# EAGLE design System (EAGLE 8.6.0)
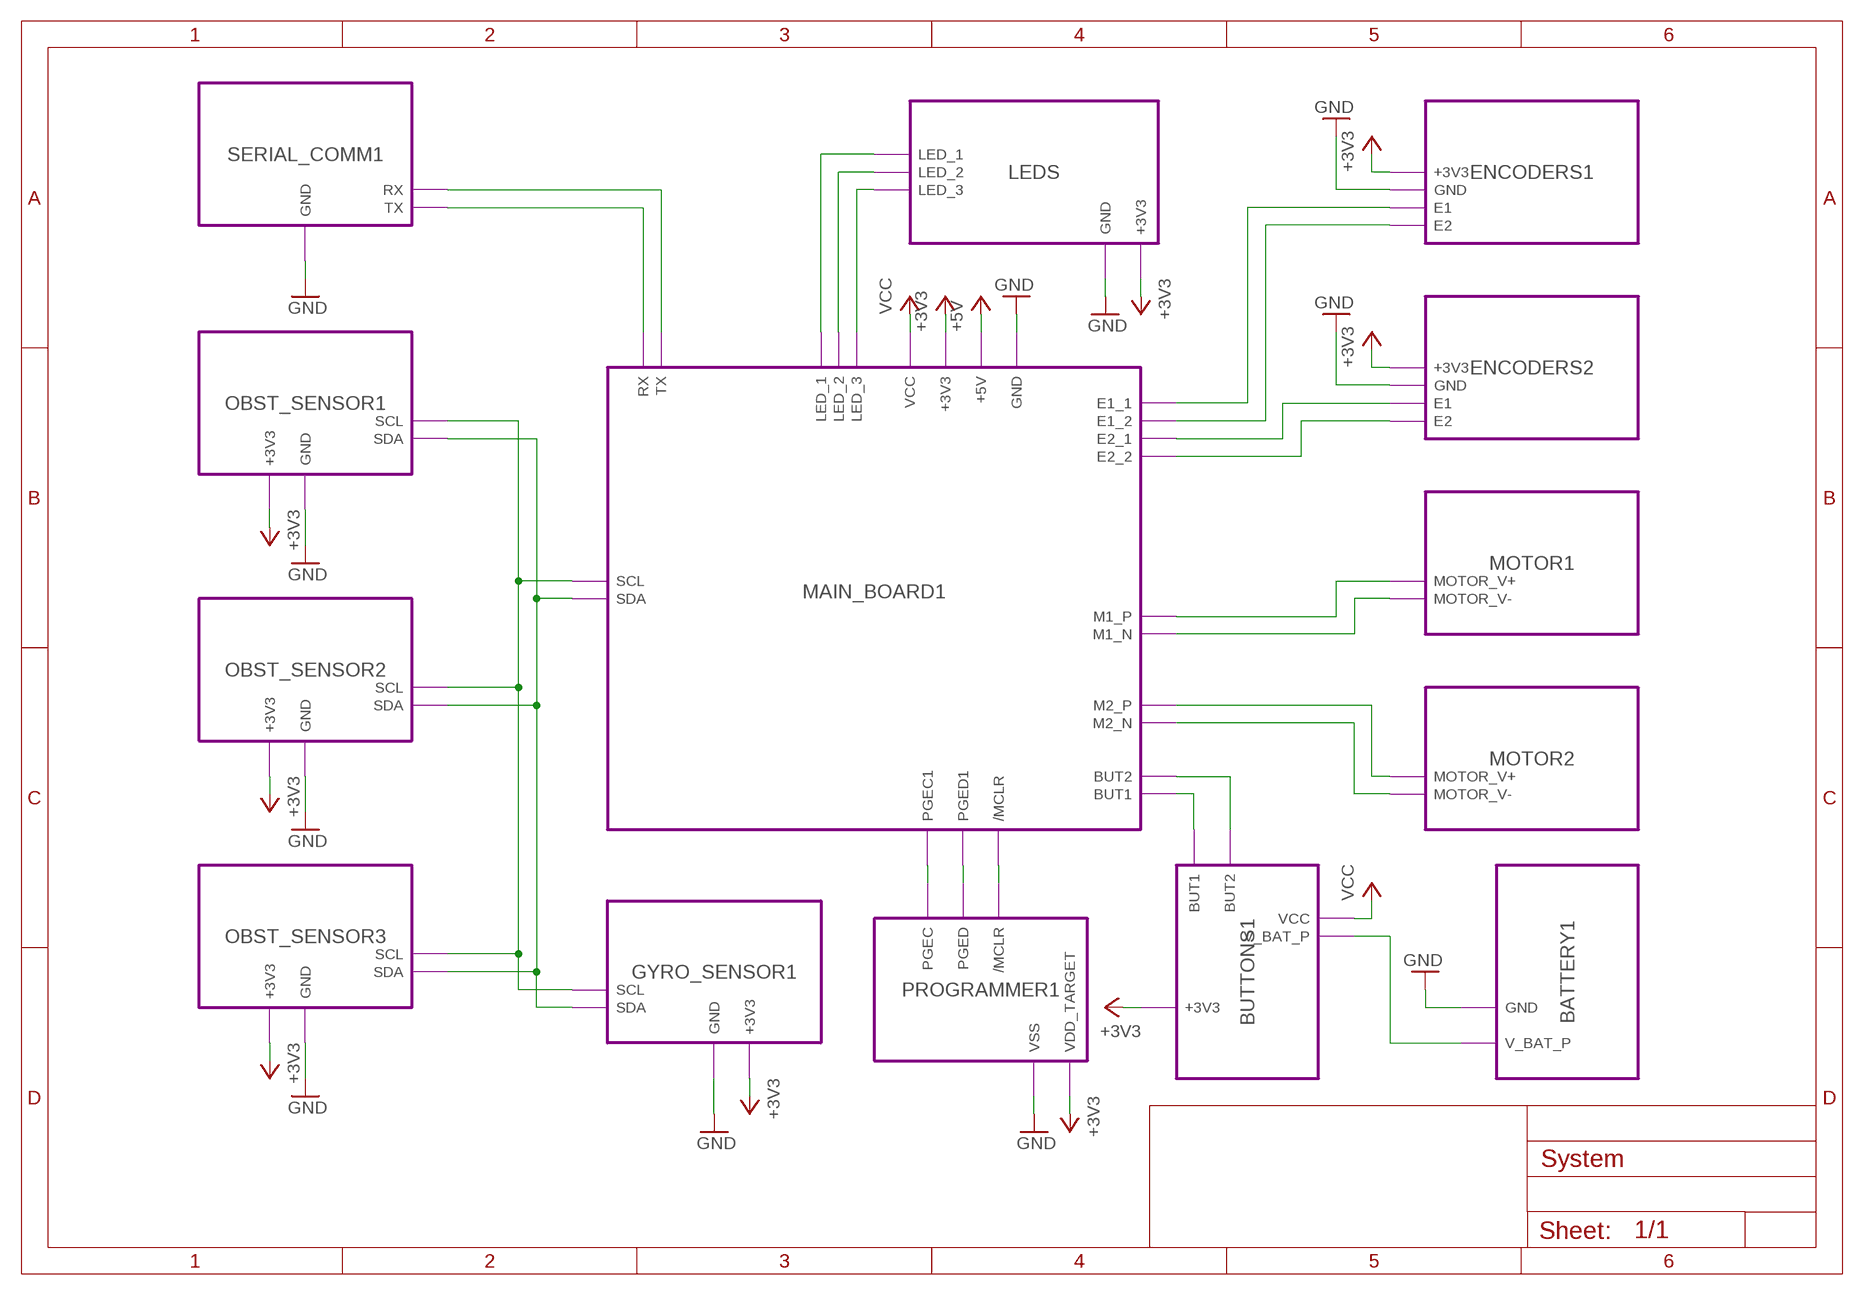
[diagram p0: schematic, sheet 1]

## Module instances
MAIN_BOARD1 = MAIN_BOARD
SERIAL_COMM1 = SERIAL_COMM
GYRO_SENSOR1 = GYRO_SENSOR
ENCODERS1 = ENCODERS
LEDS = LEDS
OBST_SENSOR1 = OBST_SENSOR
OBST_SENSOR2 = OBST_SENSOR
OBST_SENSOR3 = OBST_SENSOR
MOTOR1 = MOTOR
MOTOR2 = MOTOR
ENCODERS2 = ENCODERS
BATTERY1 = BATTERY
BUTTONS1 = BUTTONS
PROGRAMMER1 = PROGRAMMER

## Nets
+3V3: port GYRO_SENSOR1.+3V3 OBST_SENSOR1.+3V3 OBST_SENSOR3.+3V3 OBST_SENSOR2.+3V3 ENCODERS1.+3V3 ENCODERS2.+3V3 MAIN_BOARD1.+3V3 PROGRAMMER1.VDD_TARGET LEDS.+3V3 BUTTONS1.+3V3
+5V: port MAIN_BOARD1.+5V
GND: port GYRO_SENSOR1.GND SERIAL_COMM1.GND OBST_SENSOR1.GND OBST_SENSOR3.GND OBST_SENSOR2.GND ENCODERS1.GND ENCODERS2.GND BATTERY1.GND MAIN_BOARD1.GND LEDS.GND PROGRAMMER1.VSS
N$1: port GYRO_SENSOR1.SCL OBST_SENSOR3.SCL OBST_SENSOR2.SCL OBST_SENSOR1.SCL MAIN_BOARD1.SCL
N$2: port OBST_SENSOR1.SDA OBST_SENSOR2.SDA OBST_SENSOR3.SDA GYRO_SENSOR1.SDA MAIN_BOARD1.SDA
N$3: port SERIAL_COMM1.TX MAIN_BOARD1.RX
N$4: port SERIAL_COMM1.RX MAIN_BOARD1.TX
N$5: port BUTTONS1.V_BAT_P BATTERY1.V_BAT_P
N$6: port MAIN_BOARD1.M1_P MOTOR1.MOTOR_V+
N$7: port MOTOR1.MOTOR_V- MAIN_BOARD1.M1_N
N$8: port MAIN_BOARD1.M2_P MOTOR2.MOTOR_V+
N$9: port MAIN_BOARD1.M2_N MOTOR2.MOTOR_V-
N$10: port ENCODERS1.E1 MAIN_BOARD1.E1_1
N$11: port ENCODERS1.E2 MAIN_BOARD1.E1_2
N$12: port BUTTONS1.BUT1 MAIN_BOARD1.BUT1
N$13: port MAIN_BOARD1.BUT2 BUTTONS1.BUT2
N$14: port MAIN_BOARD1.PGEC1 PROGRAMMER1.PGEC
N$15: port MAIN_BOARD1.PGED1 PROGRAMMER1.PGED
N$17: port MAIN_BOARD1.E2_1 ENCODERS2.E1
N$18: port LEDS.LED_3 MAIN_BOARD1.LED_3
N$19: port LEDS.LED_2 MAIN_BOARD1.LED_2
N$20: port LEDS.LED_1 MAIN_BOARD1.LED_1
N$22: port MAIN_BOARD1.E2_2 ENCODERS2.E2
N$23: port MAIN_BOARD1./MCLR PROGRAMMER1./MCLR
VCC: port BUTTONS1.VCC MAIN_BOARD1.VCC

## Library data of the parts

## Module SERIAL_COMM
Ports: GND(pwr) RX(in) TX(out)
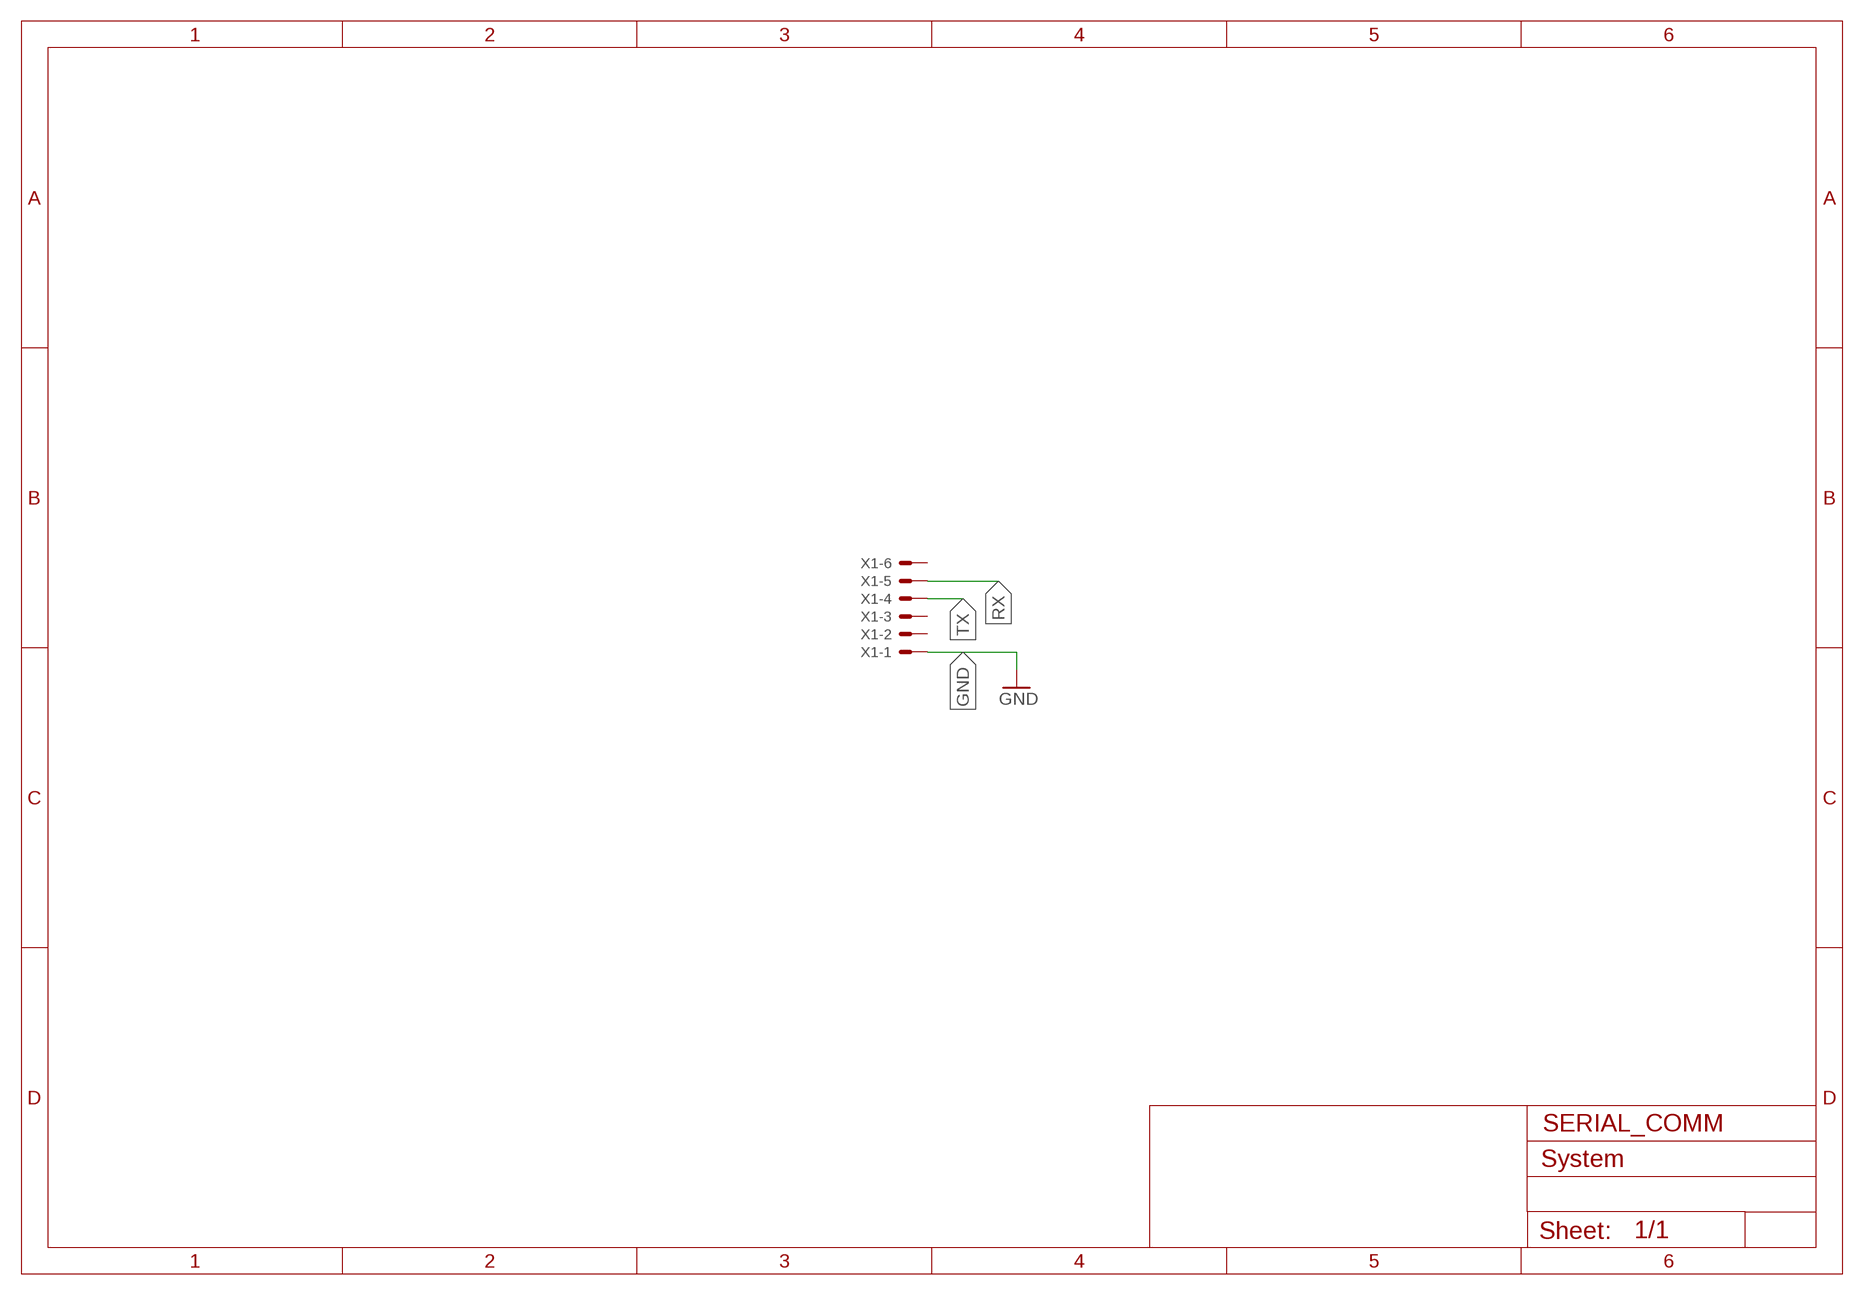
[diagram p1: schematic, module SERIAL_COMM, sheet 1]

### Parts
X1  22-23-2061  [22-23-2061]

### Nets
GND: X1.1
RX: X1.5
TX: X1.4
Unconnected: X1.2 X1.3 X1.6

### Notes on the sheet
- SERIAL_COMM

### Library data of the parts
X1 = con-molex:22-23-2061: .100" (2.54mm) Center Header - 6 Pin; MF: MOLEX; MPN: 22-23-2061; OC_FARNELL: 1462922; OC_NEWARK: 27C1933

## Module OBST_SENSOR
Ports: GND(pwr) +3V3(pwr) SDA(io) SCL(io)
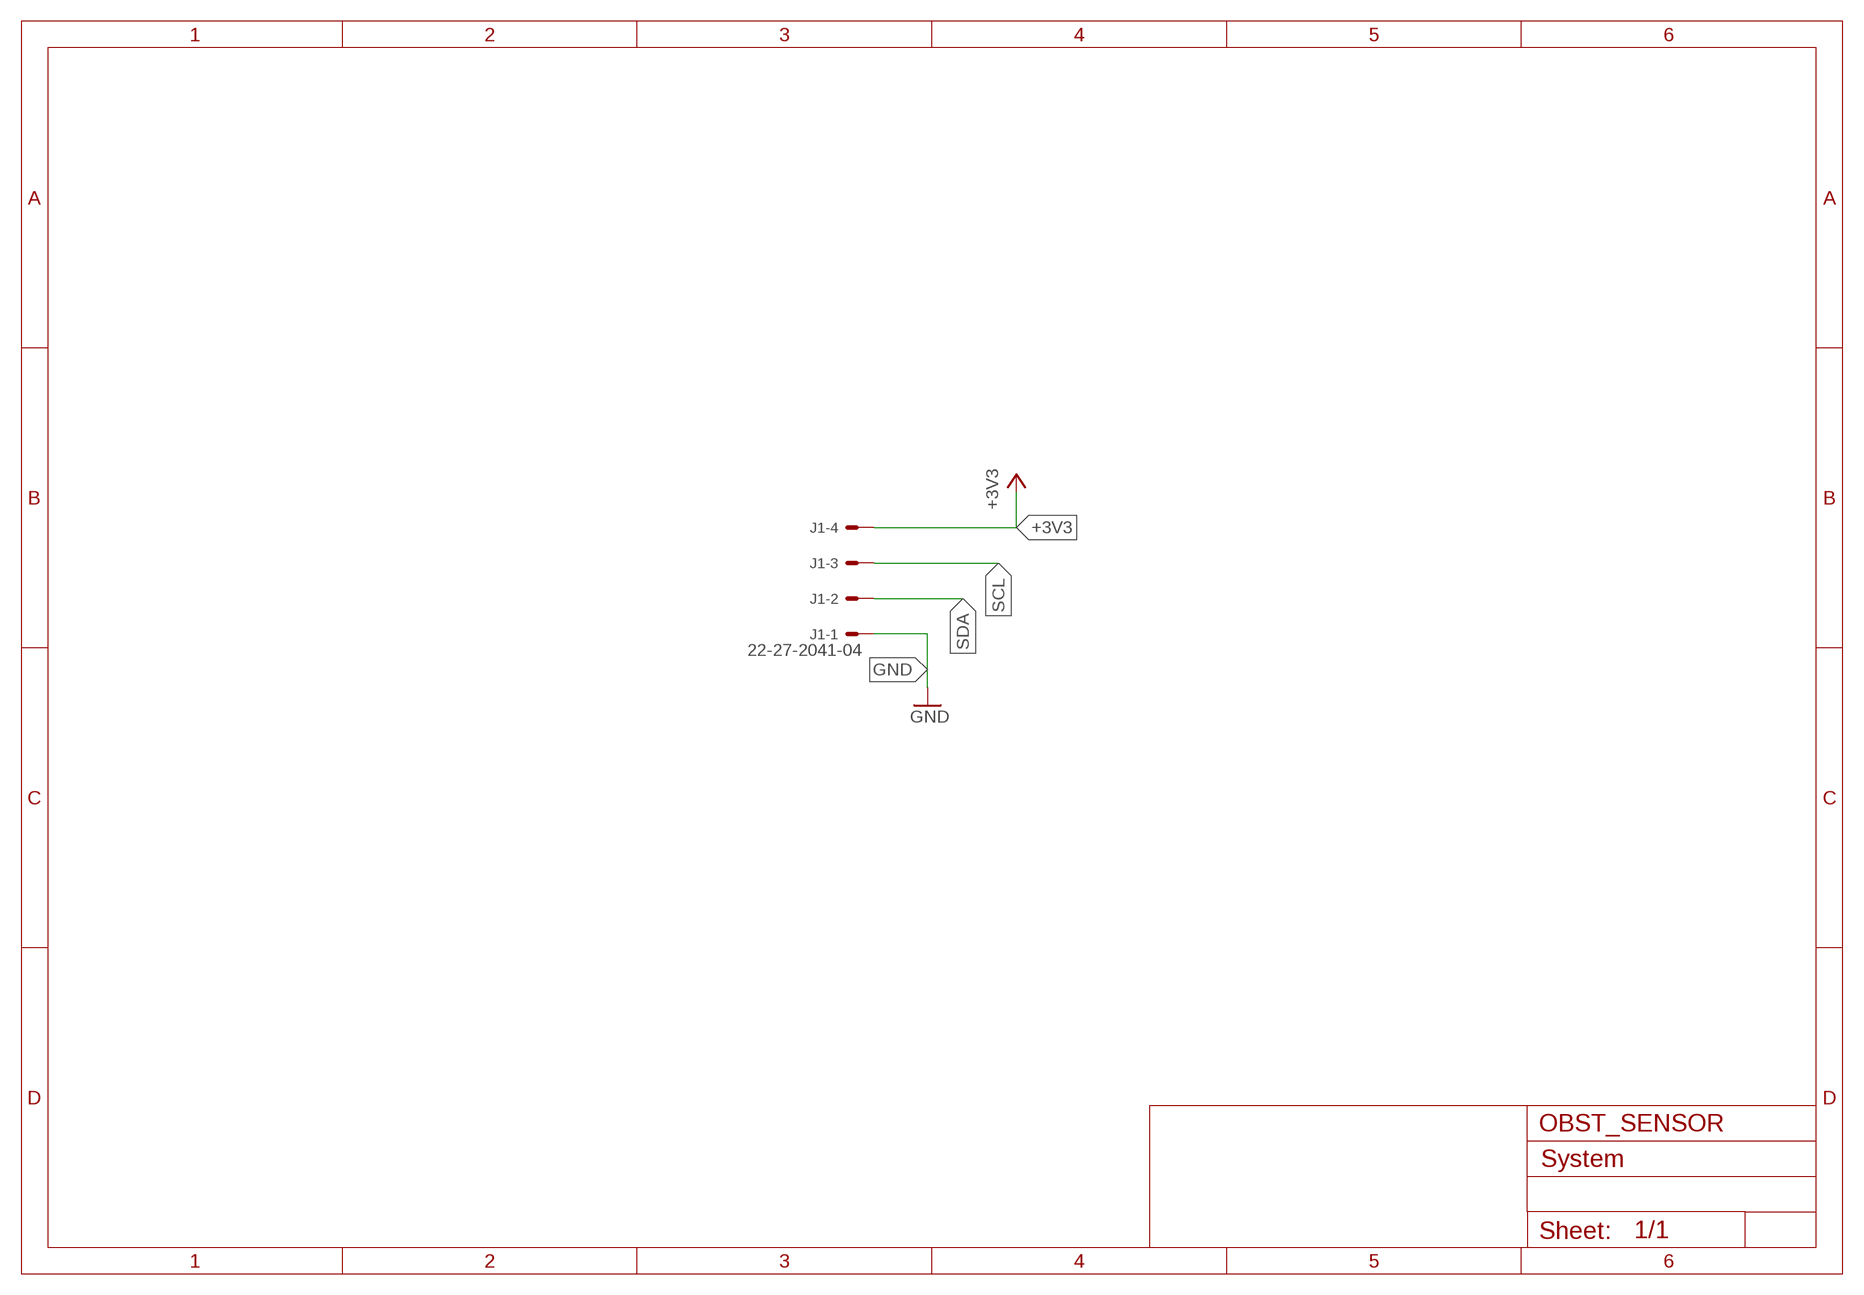
[diagram p2: schematic, module OBST_SENSOR, sheet 1]

### Parts
J1  22-27-2041-04  [6410-04]

### Nets
+3V3: J1.4
GND: J1.1
SCL: J1.3
SDA: J1.2

### Notes on the sheet
- OBST_SENSOR

### Library data of the parts
J1 = con-molex:22-?-04: CONNECTOR wire to board 2.54 mm (.1 inch) pitch header; MF: MOLEX; OC_FARNELL: unknown; OC_NEWARK: unknown

## Module GYRO_SENSOR
Ports: +3V3(pwr) GND(pwr) SCL(io) SDA(io)
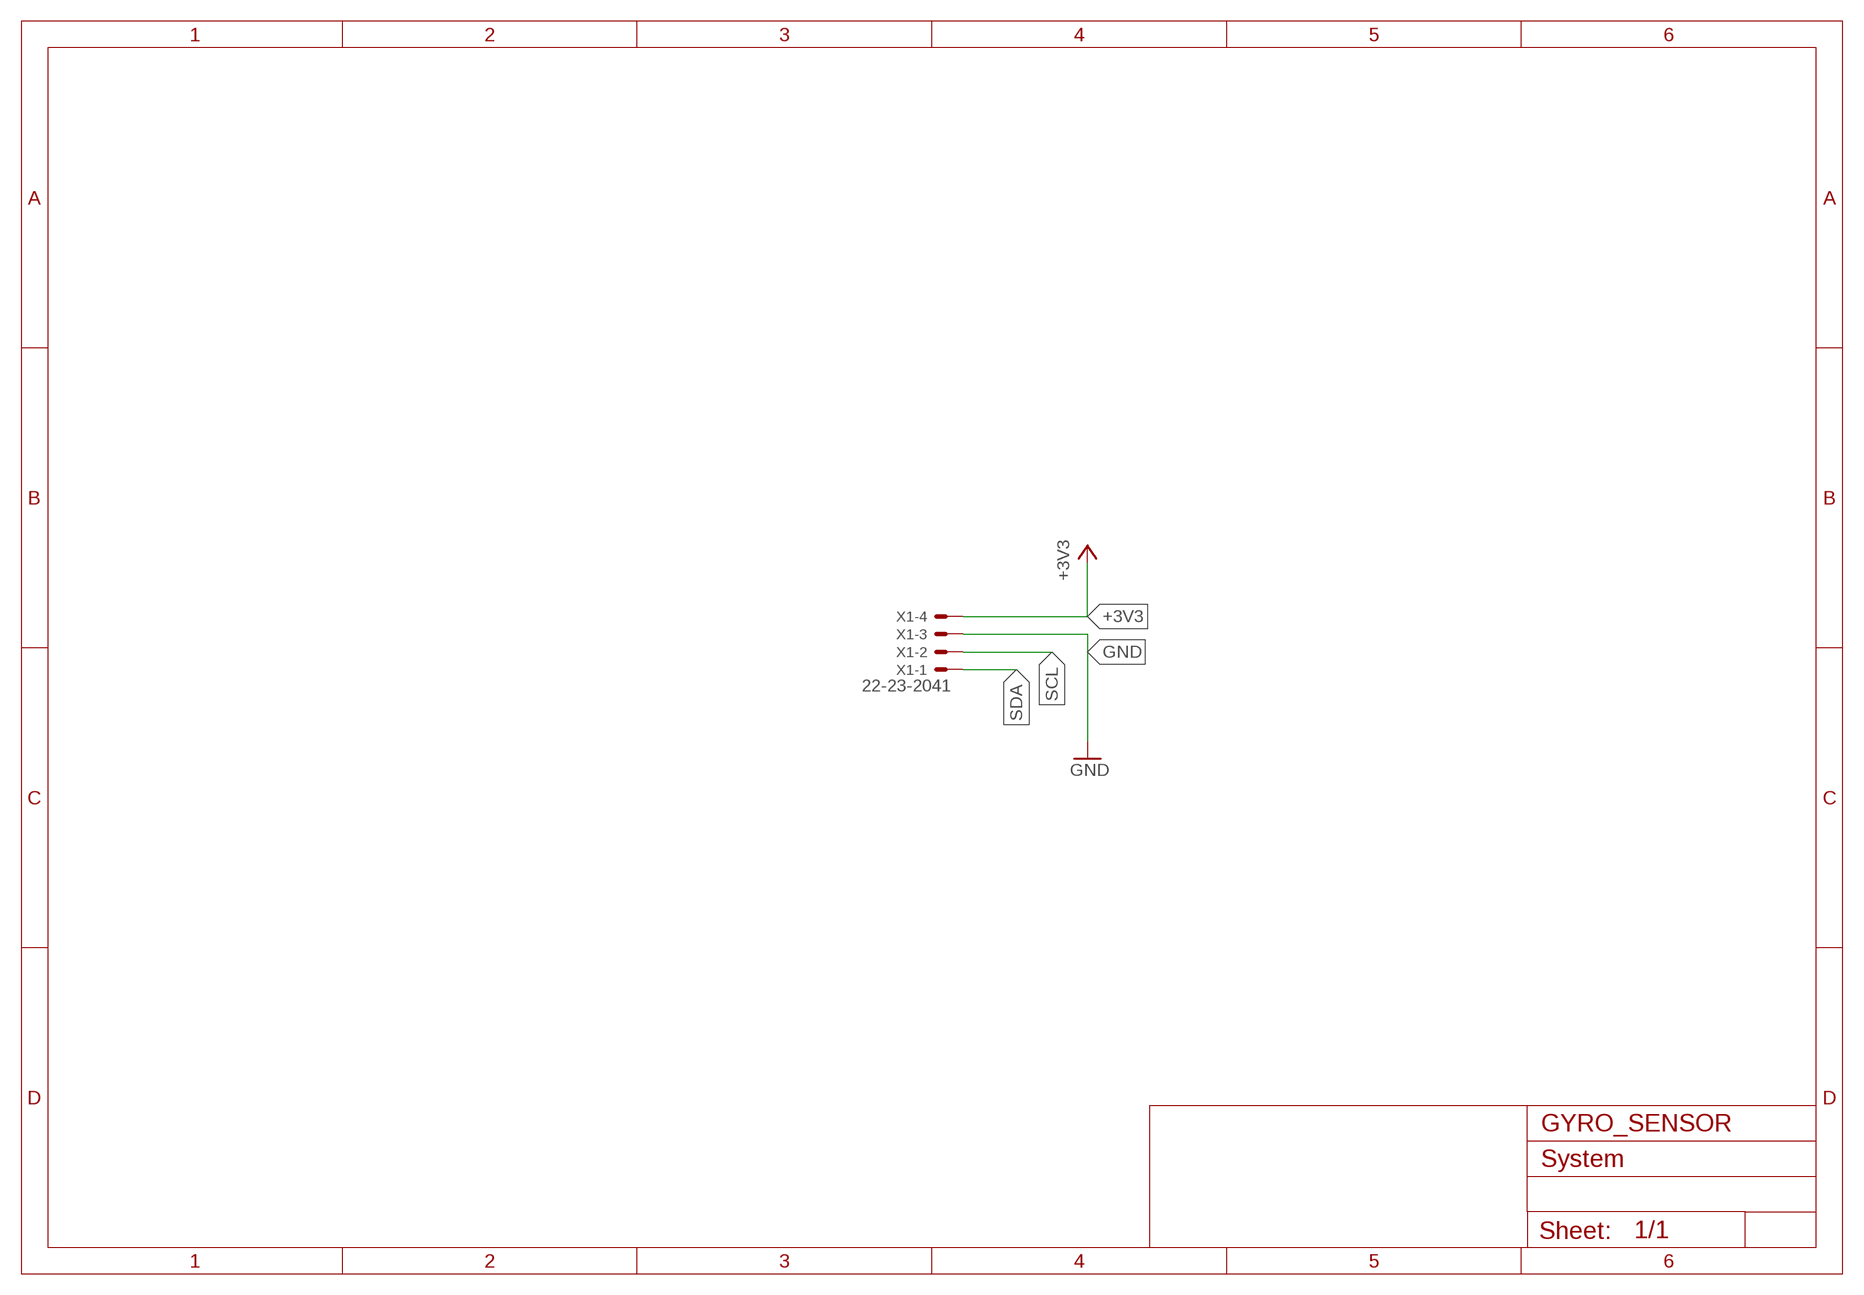
[diagram p3: schematic, module GYRO_SENSOR, sheet 1]

### Parts
X1  22-23-2041  [22-23-2041]

### Nets
+3V3: X1.4
GND: X1.3
SCL: X1.2
SDA: X1.1

### Notes on the sheet
- GYRO_SENSOR

### Library data of the parts
X1 = con-molex:22-23-2041: .100" (2.54mm) Center Header - 4 Pin; MF: MOLEX; MPN: 22-23-2041; OC_FARNELL: 1462920; OC_NEWARK: 38C0355

## Module ENCODERS
Ports: +3V3(pwr) GND(pwr) E1(out) E2(out)
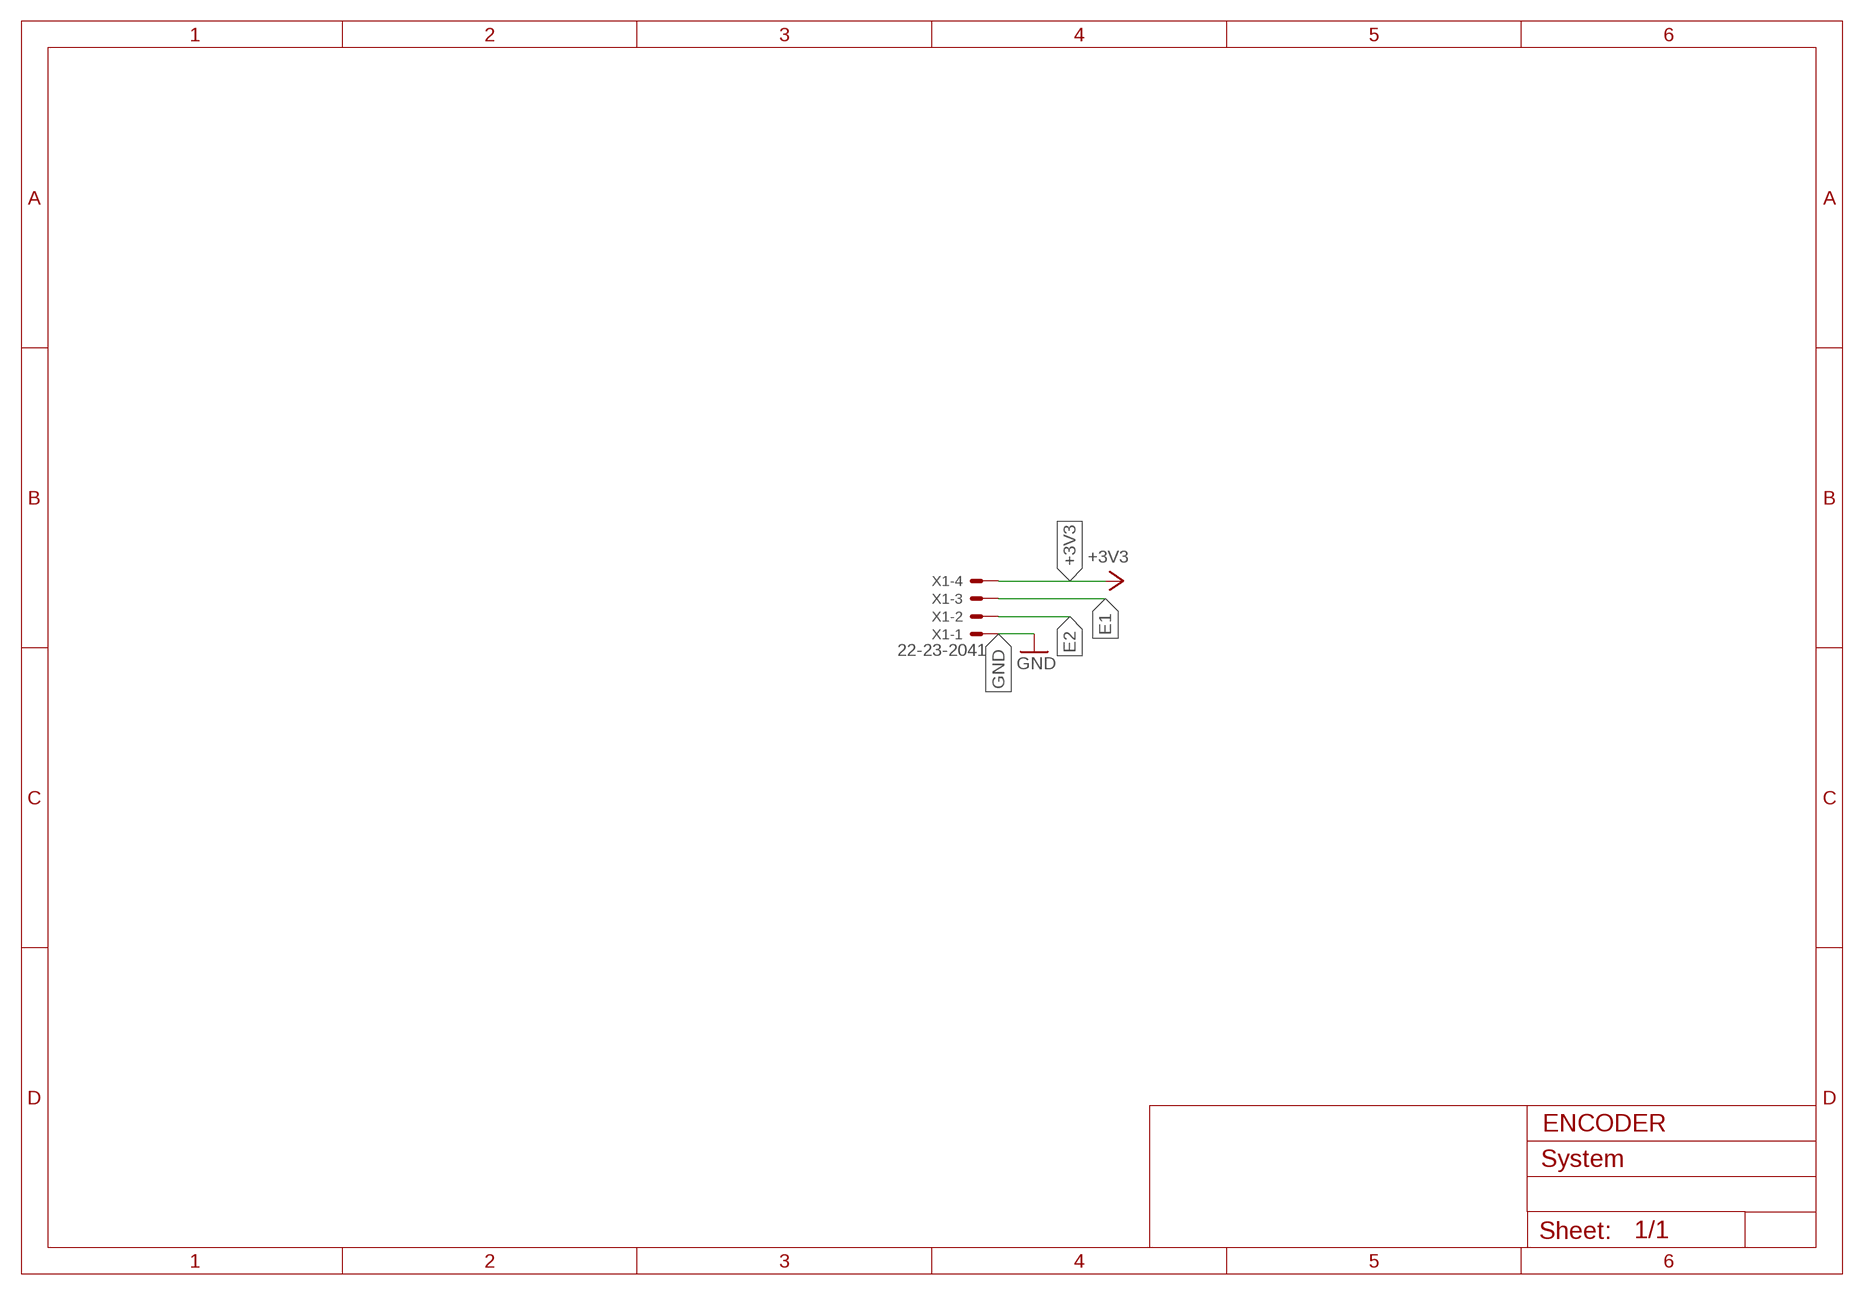
[diagram p4: schematic, module ENCODERS, sheet 1]

### Parts
X1  22-23-2041  [22-23-2041]

### Nets
+3V3: X1.4
E1: X1.3
E2: X1.2
GND: X1.1

### Notes on the sheet
- ENCODER

### Library data of the parts
X1 = con-molex:22-23-2041: .100" (2.54mm) Center Header - 4 Pin; MF: MOLEX; MPN: 22-23-2041; OC_FARNELL: 1462920; OC_NEWARK: 38C0355

## Module LEDS
Ports: LED_1(in) LED_2(in) LED_3(in) GND(pwr) +3V3(pwr)
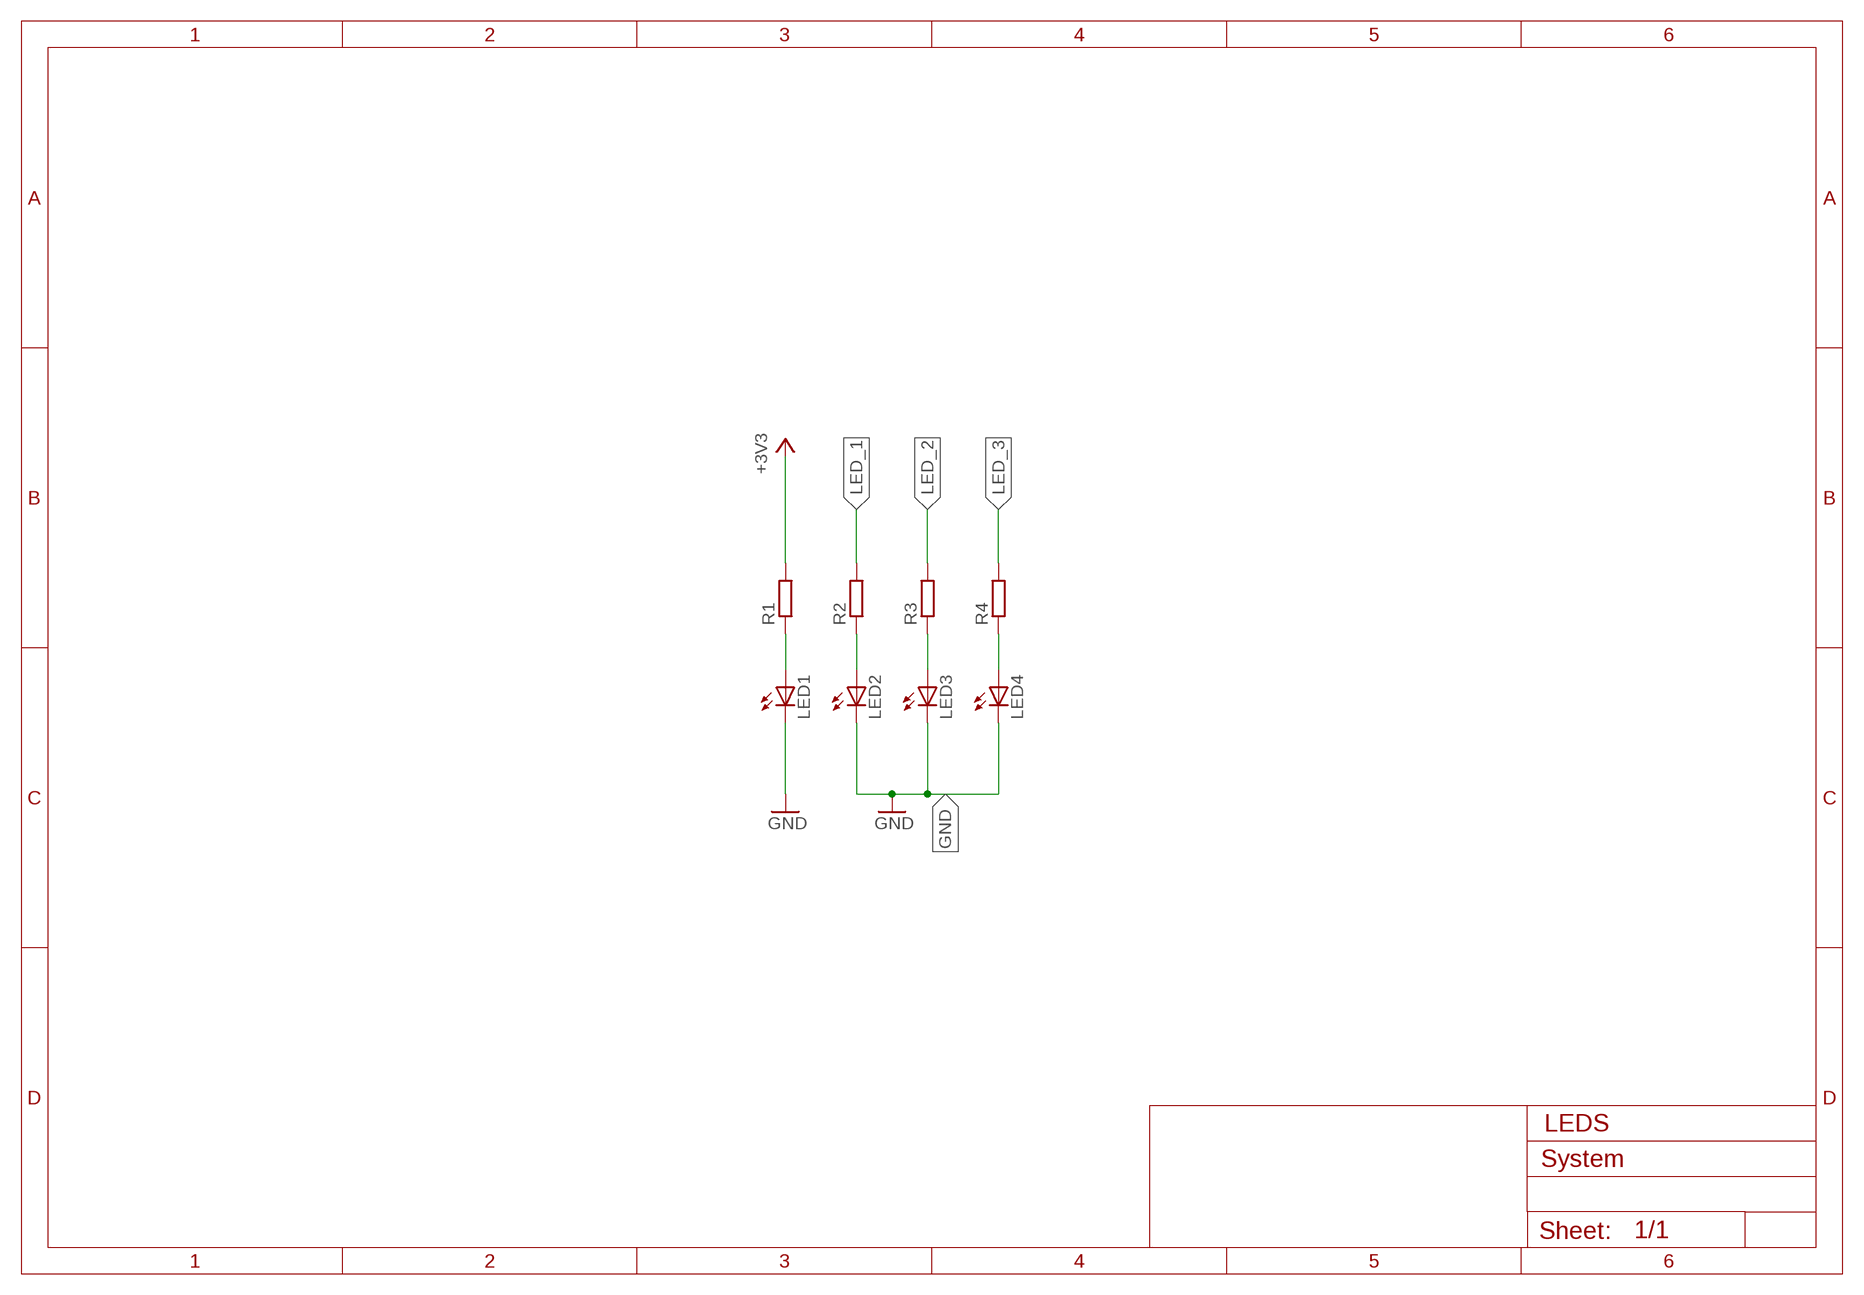
[diagram p5: schematic, module LEDS, sheet 1]

### Parts
LED1  LEDSML0805  [SML0805]
LED2  LEDSML0805  [SML0805]
LED3  LEDSML0805  [SML0805]
LED4  LEDSML0805  [SML0805]
R1  R-EU_M1206  [M1206]
R2  R-EU_M1206  [M1206]
R3  R-EU_M1206  [M1206]
R4  R-EU_M1206  [M1206]

### Nets
+3V3: R1.2
GND: LED1.C LED2.C LED3.C LED4.C
LED_1: R2.2
LED_2: R3.2
LED_3: R4.2
N$1: LED4.A R4.1
N$2: LED3.A R3.1
N$3: LED2.A R2.1
N$4: LED1.A R1.1

### Notes on the sheet
- LEDS

### Library data of the parts
LED1-LED4 = led:LED: LED OSRAM: - CHIPLED LG R971, LG N971, LY N971, LG Q971, LY Q971, LO R971, LY R971 LH N974, LH R974 LS Q976, LO Q976, LY Q976 LO Q996 - Hyper CHIPLED LW Q18S LB Q993, LB Q99A, LB R99A - SideLED LS A670, LO A670, LY A670, LG A670, LP A670 LB A673, LV A673, LT A673, LW A673 LH A674 LY A675 LS A676, LA A676, LO A676, LY A676, LW A676 LS A679, LY A679, LG A679 - Hyper Micro SIDELED® LS Y876, LA Y876, LO Y876, LY Y876 LT Y87S - SmartLED LW L88C, LW L88S LB L89C, LB L89S, LG L890 LS L89K, LO L89K, LY L89K LS L896, LA L896, LO L896, LY L896 - TOPLED LS T670, LO T670, LY T670, LG T670, LP T670 LSG T670, LSP T670, LSY T670, LOP T670, LYG T670 LG T671, LOG T671, LSG T671 LB T673, LV T673, LT T673, LW T673 LH T674 LS T676, LA T676, LO T676, LY T676, LB T676, LH T676, LSB T676, LW T676 LB T67C, LV T67C, LT T67C, LS T67K, LO T67K, LY T67K, LW E67C LS E67B, LA E67B, LO E67B, LY E67B, LB E67C, LV E67C, LT E67C LW T67C LS T679, LY T679, LG T679 LS T770, LO T770, LY T770, LG T770, LP T770 LB T773, LV T773, LT T773, LW T773 LH T774 LS E675, LA E675, LY E675, LS T675 LS T776, LA T776, LO T776, LY T776, LB T776 LHGB T686 LT T68C, LB T68C - Hyper Mini TOPLED® LB M676 - Mini TOPLED Santana® LG M470 LS M47K, LO M47K, LY M47K Source: http://www.osram.convergy.de LUXEON: - LUMILED® LXK2-PW12-R00, LXK2-PW12-S00, LXK2-PW14-U00, LXK2-PW14-V00 LXK2-PM12-R00, LXK2-PM12-S00, LXK2-PM14-U00 LXK2-PE12-Q00, LXK2-PE12-R00, LXK2-PE12-S00, LXK2-PE14-T00, LXK2-PE14-U00 LXK2-PB12-K00, LXK2-PB12-L00, LXK2-PB12-M00, LXK2-PB14-N00, LXK2-PB14-P00, LXK2-PB14-Q00 LXK2-PR12-L00, LXK2-PR12-M00, LXK2-PR14-Q00, LXK2-PR14-R00 LXK2-PD12-Q00, LXK2-PD12-R00, LXK2-PD12-S00 LXK2-PH12-R00, LXK2-PH12-S00 LXK2-PL12-P00, LXK2-PL12-Q00, LXK2-PL12-R00 Source: www.luxeon.com KINGBRIGHT: KA-3528ASYC Source: www.kingbright.com
R1-R4 = rcl:R-EU_: RESISTOR, European symbol; SPICEPREFIX: R

## Module POWER_DIST
Ports: VCC(pwr) +3V3(pwr) +5V(pwr) GND(pwr)
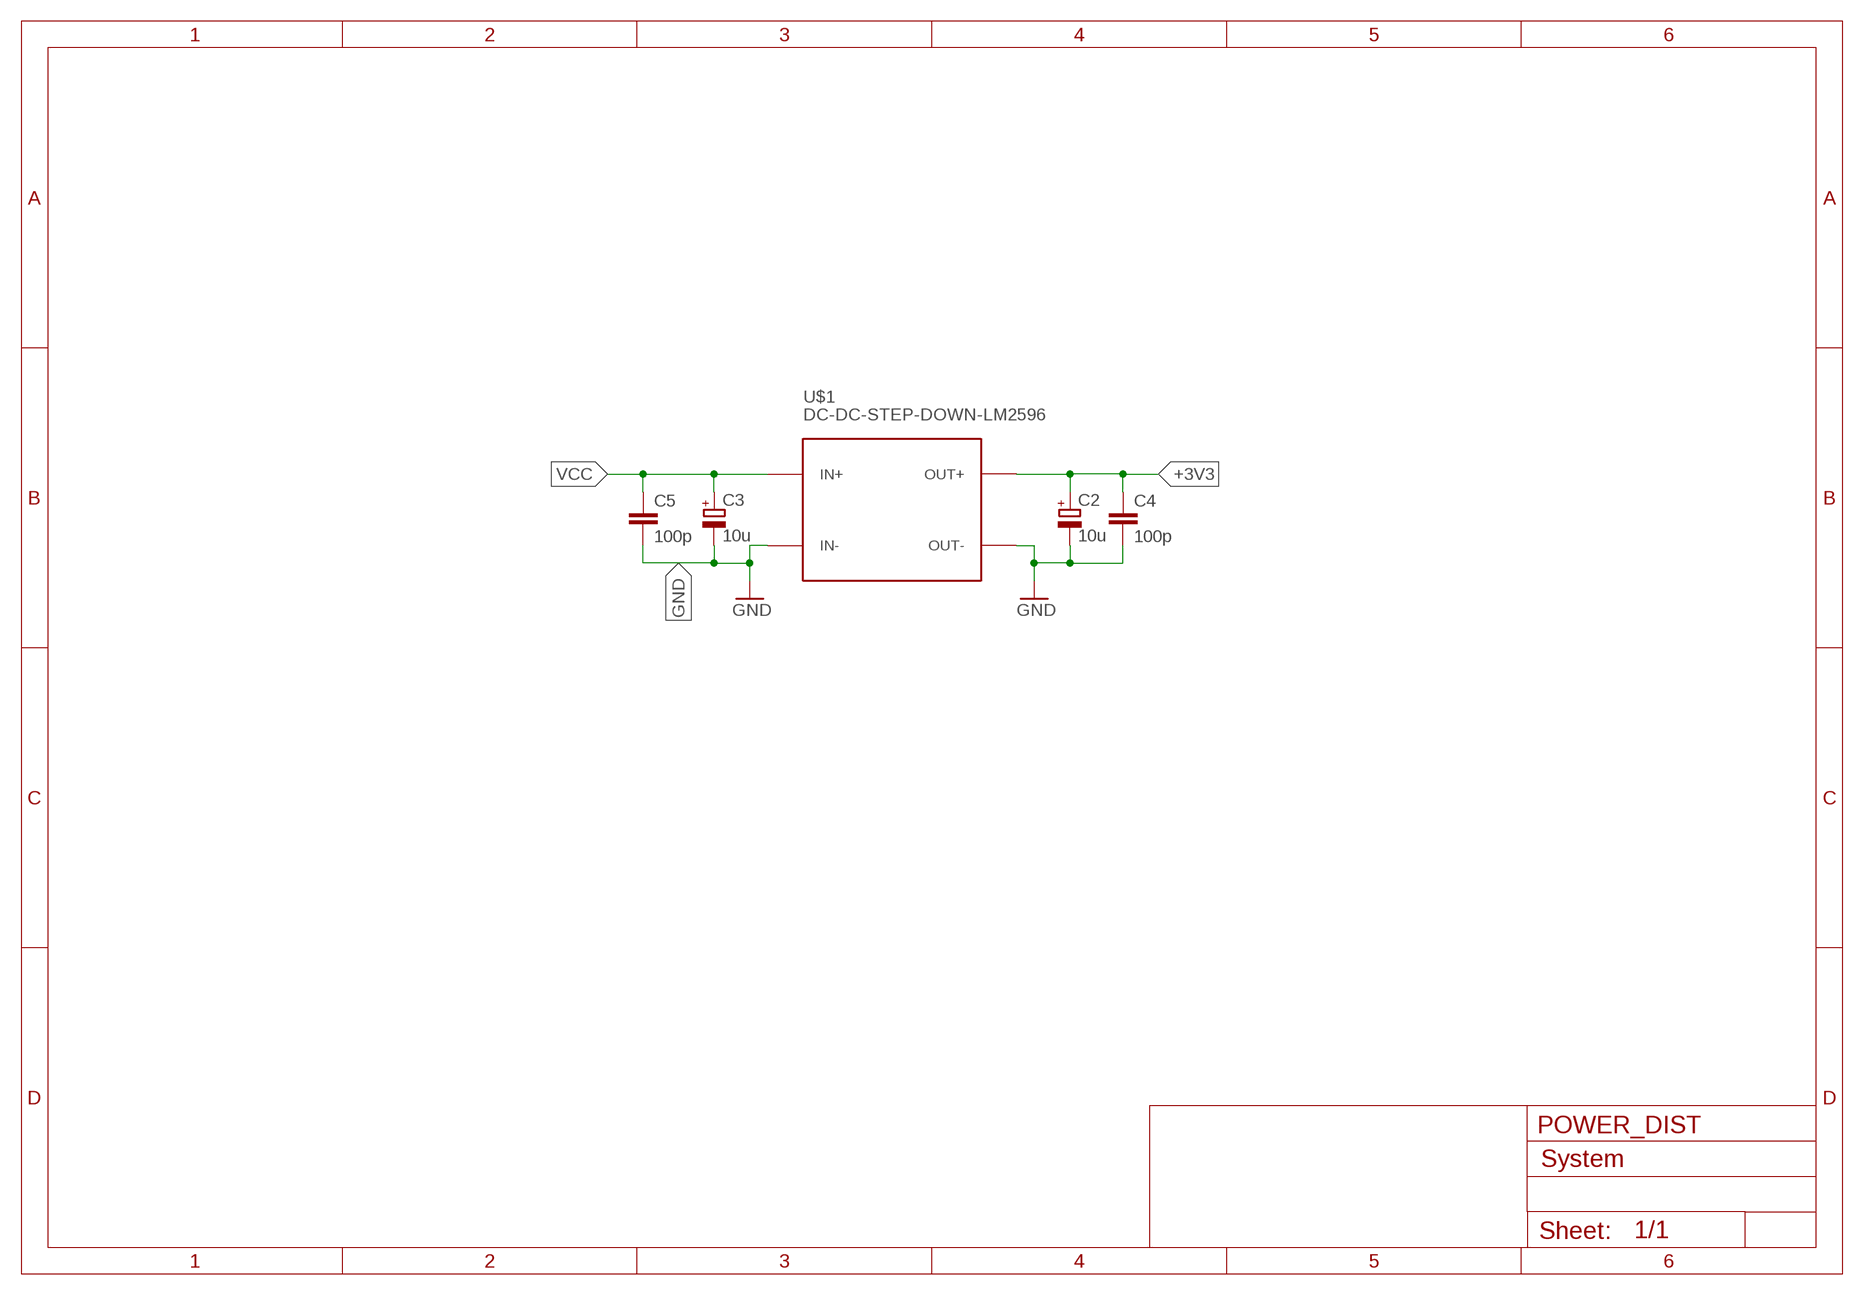
[diagram p6: schematic, module POWER_DIST, sheet 1]

### Parts
C2  10u  CPOL-EUE2.5-6  [E2,5-6]
C3  10u  CPOL-EUE2.5-6  [E2,5-6]
C4  100p  C-EUC0805  [C0805]
C5  100p  C-EU050-024X044  [C050-024X044]
U$1  DC-DC-STEP-DOWN-LM2596  [DC-DC-STEP-DOWN-LM2596]

### Nets
+3V3: C2.+ C4.1 U$1.OUT+
GND: C2.- C3.- C4.2 C5.2 U$1.IN- U$1.OUT-
VCC: C3.+ C5.1 U$1.IN+

### Notes on the sheet
- POWER_DIST

### Library data of the parts
C2 C3 = rcl:CPOL-EU: POLARIZED CAPACITOR, European symbol; SPICEPREFIX: C
C4 C5 = rcl:C-EU: CAPACITOR, European symbol; SPICEPREFIX: C
U$1 = diy-modules:DC-DC-STEP-DOWN-LM2596: DC/DC Step-Down Regulator based on LM2596-ADJ chip LM2596 datasheet available here: http://www.ti.com/lit/ds/symlink/lm2596.pdf Click here to find device on ebay.com <http://www.ebay.com/sch/lm2596+power+regulator>

## Module DEBOUNCER
Ports: BUT_OUT(out) GND(pwr) +3V3(pwr)
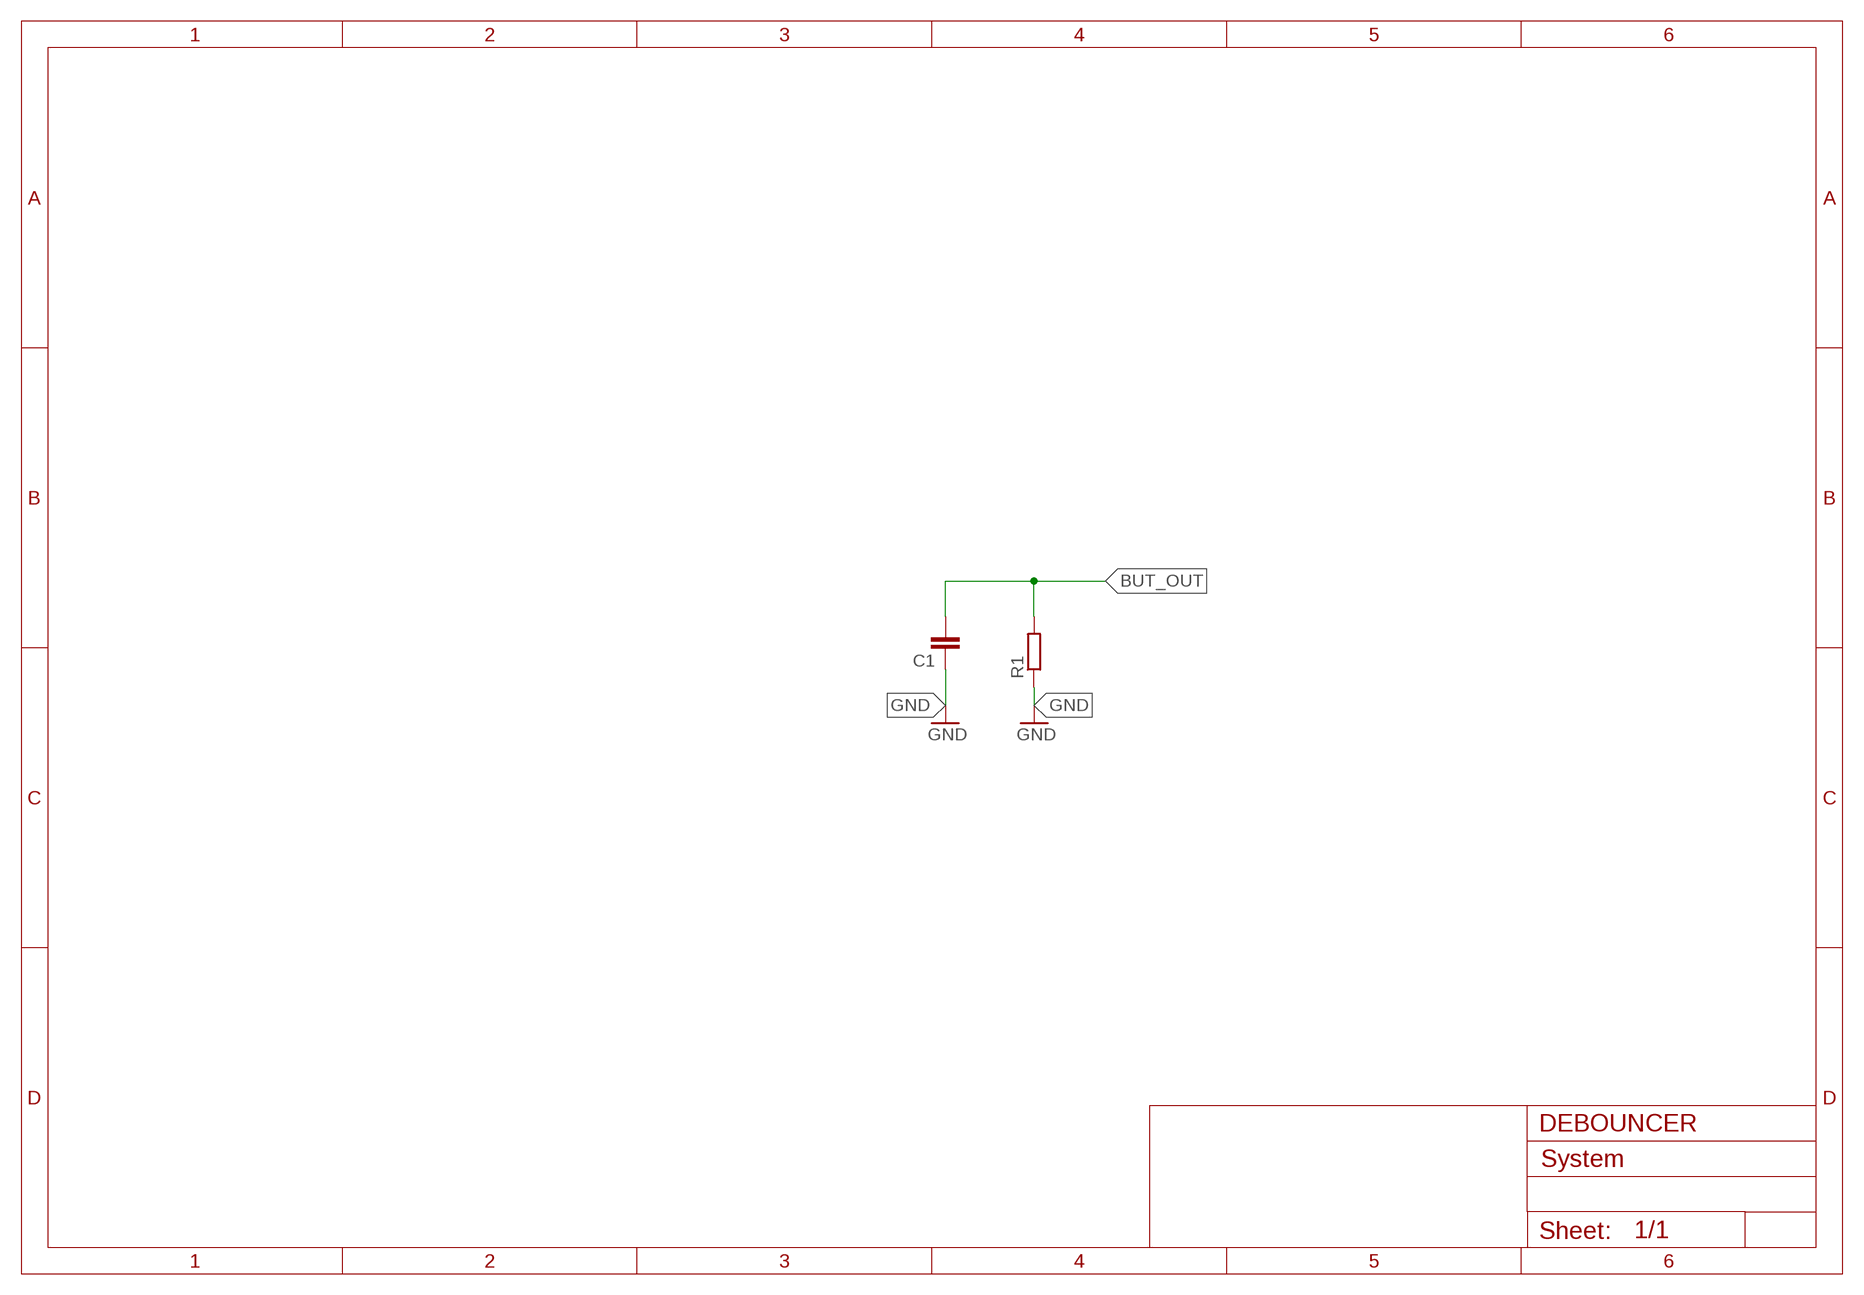
[diagram p7: schematic, module DEBOUNCER, sheet 1]

### Parts
C1  C-EU025-030X050  [C025-030X050]
R1  R-EU_M1206  [M1206]

### Nets
BUT_OUT: C1.2 R1.2
GND: C1.1 R1.1

### Notes on the sheet
- DEBOUNCER

### Library data of the parts
C1 = rcl:C-EU: CAPACITOR, European symbol; SPICEPREFIX: C
R1 = rcl:R-EU_: RESISTOR, European symbol; SPICEPREFIX: R

## Module MOTOR
Ports: MOTOR_V+(io) MOTOR_V-(io)
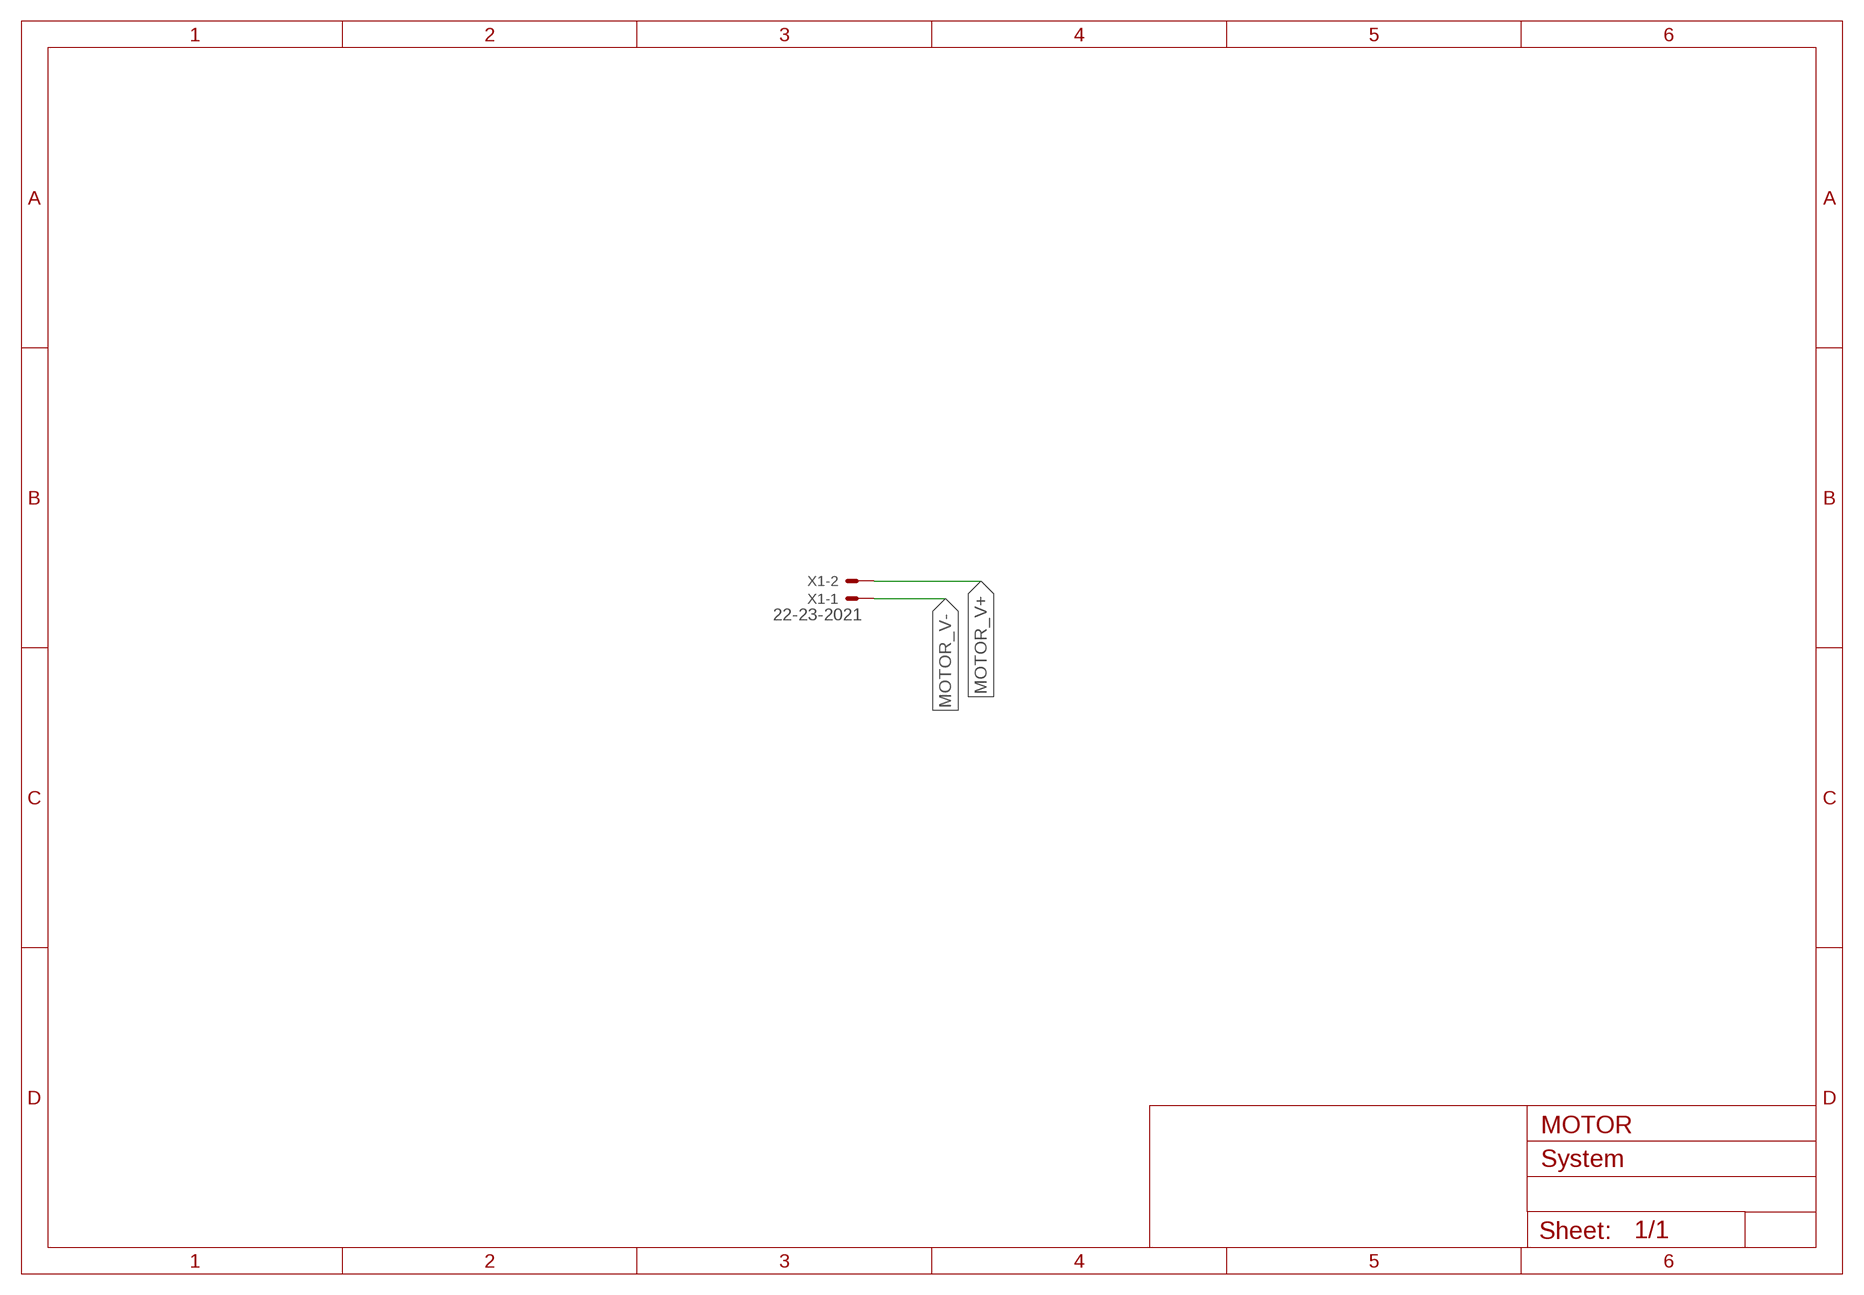
[diagram p8: schematic, module MOTOR, sheet 1]

### Parts
X1  22-23-2021  [22-23-2021]

### Nets
MOTOR_V+: X1.2
MOTOR_V-: X1.1

### Notes on the sheet
- MOTOR

### Library data of the parts
X1 = con-molex:22-23-2021: .100" (2.54mm) Center Header - 2 Pin; MF: MOLEX; MPN: 22-23-2021; OC_FARNELL: 1462926; OC_NEWARK: 25C3832

## Module BATTERY
Ports: V_BAT_P(pwr) GND(pwr)
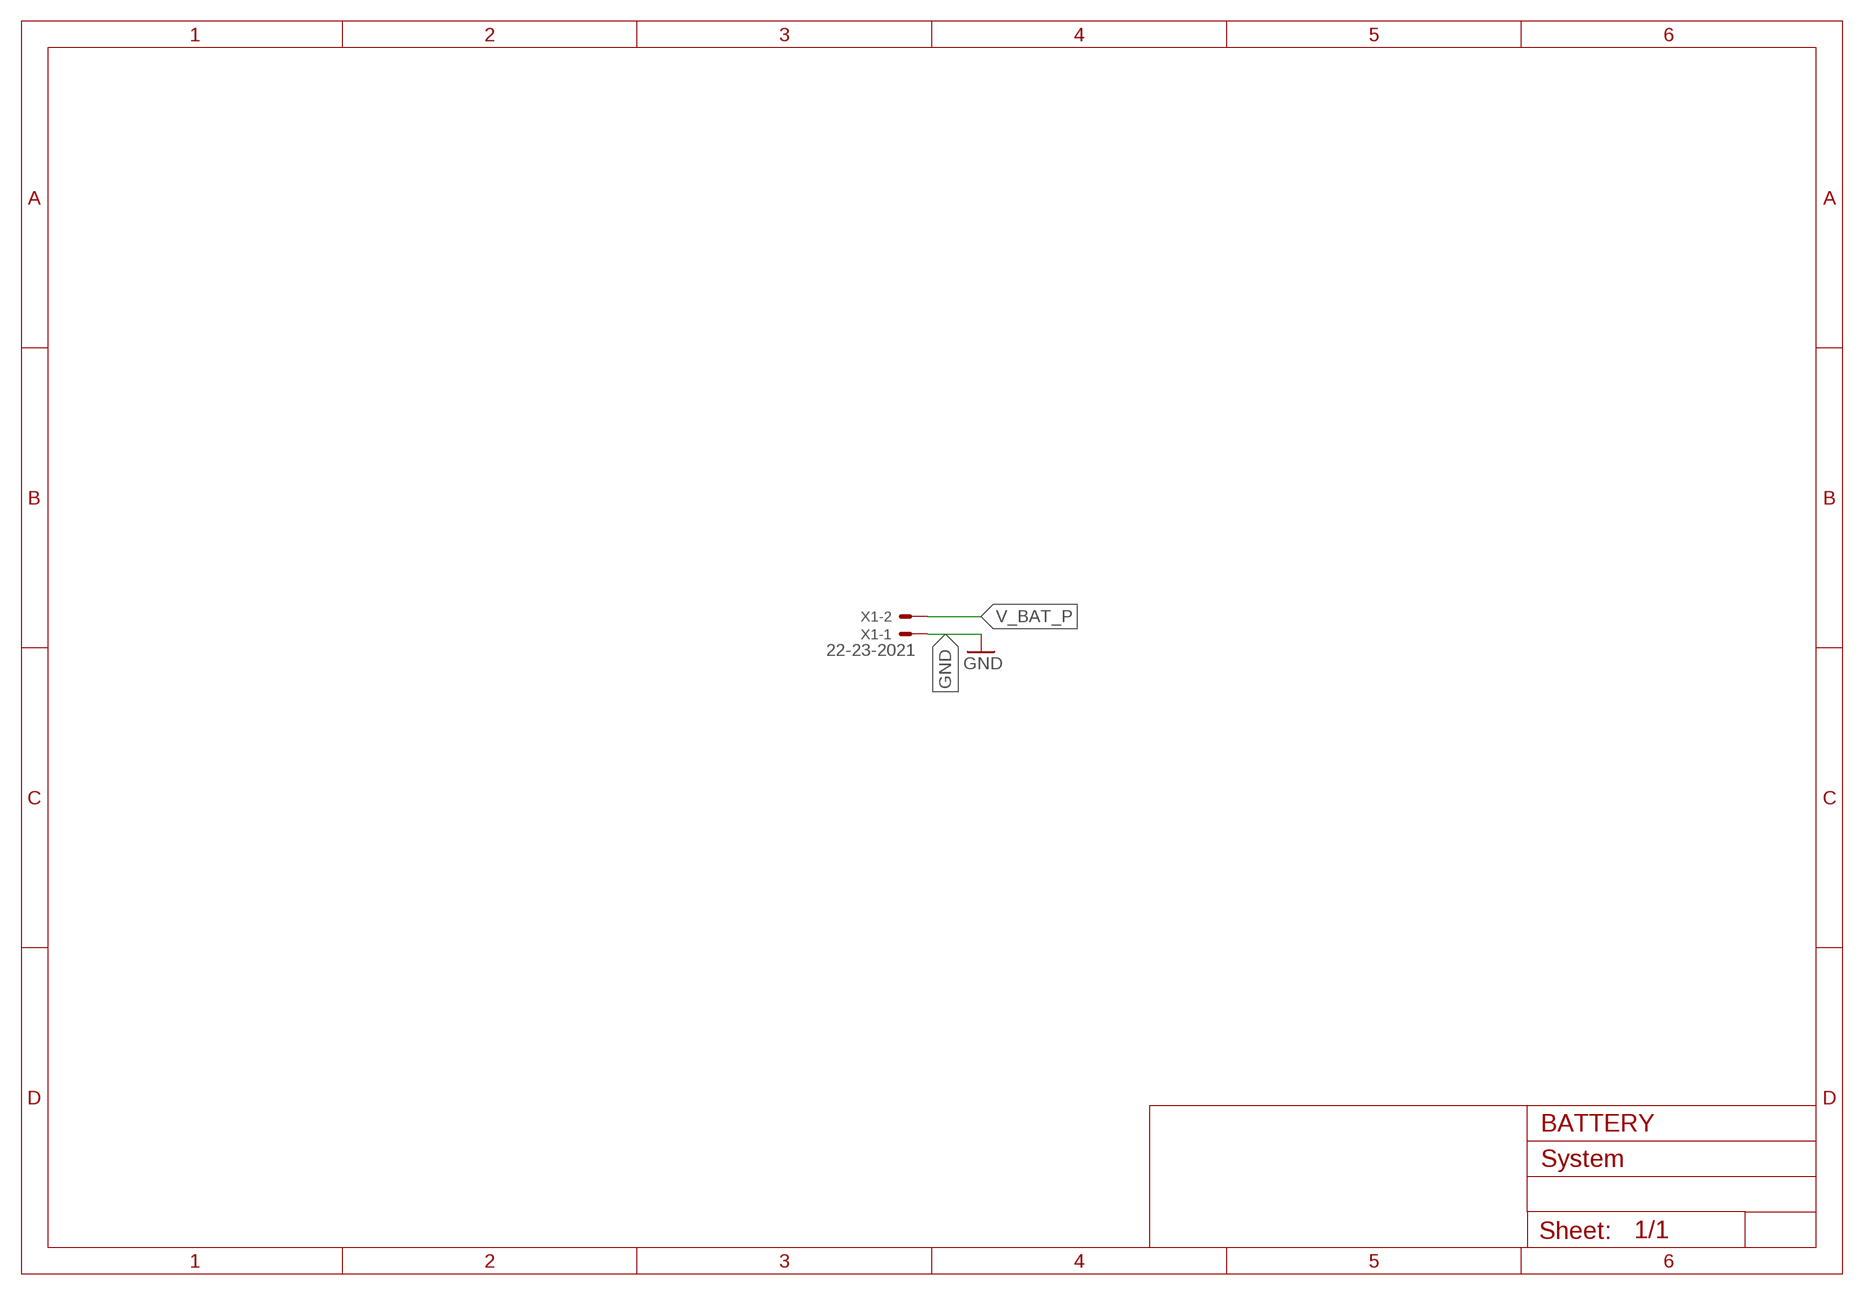
[diagram p9: schematic, module BATTERY, sheet 1]
FRAME1 (A4L-LOC): SPICEPREFIX: F

### Parts
X1  22-23-2021  [22-23-2021]

### Nets
GND: X1.1
V_BAT_P: X1.2

### Notes on the sheet
- BATTERY

### Library data of the parts
X1 = con-molex:22-23-2021: .100" (2.54mm) Center Header - 2 Pin; MF: MOLEX; MPN: 22-23-2021; OC_FARNELL: 1462926; OC_NEWARK: 25C3832

## Module BUTTONS
Ports: V_BAT_P(pwr) VCC(pwr) +3V3(pwr) BUT1(out) BUT2(out)
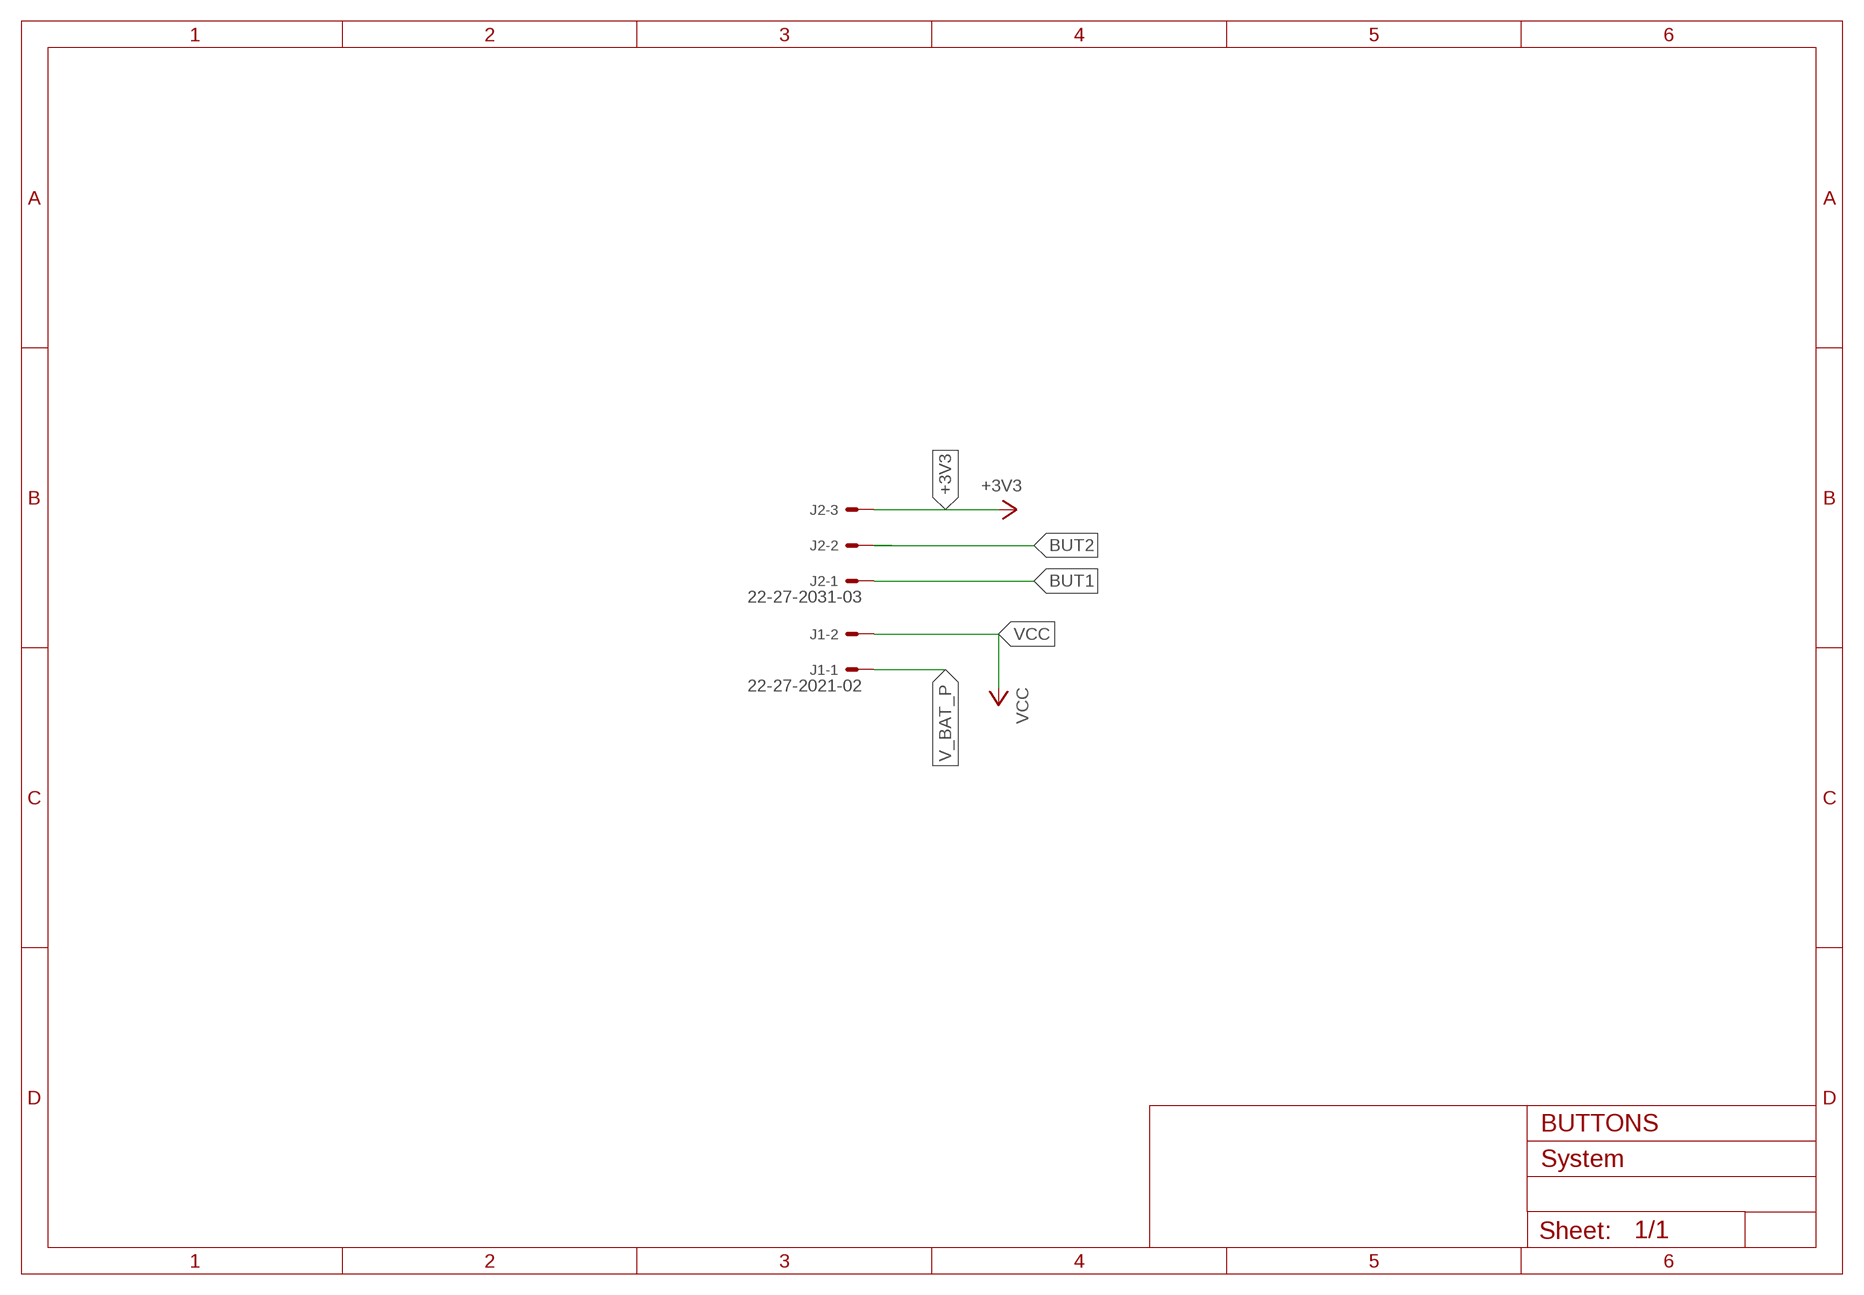
[diagram p10: schematic, module BUTTONS, sheet 1]

### Parts
J1  22-27-2021-02  [6410-02]
J2  22-27-2031-03  [6410-03]

### Nets
+3V3: J2.3
BUT1: J2.1
BUT2: J2.2
V_BAT_P: J1.1
VCC: J1.2

### Notes on the sheet
- BUTTONS

### Library data of the parts
J1 = con-molex:22-?-02: CONNECTOR wire to board 2.54 mm (.1 inch) pitch header; MF: MOLEX; OC_FARNELL: unknown; OC_NEWARK: unknown
J2 = con-molex:22-?-03: CONNECTOR wire to board 2.54 mm (.1 inch) pitch header; MF: MOLEX; OC_FARNELL: unknown; OC_NEWARK: unknown

## Module RESET_CIRCUIT
Ports: /MCLR(io) GND(pwr) +3V3(pwr)
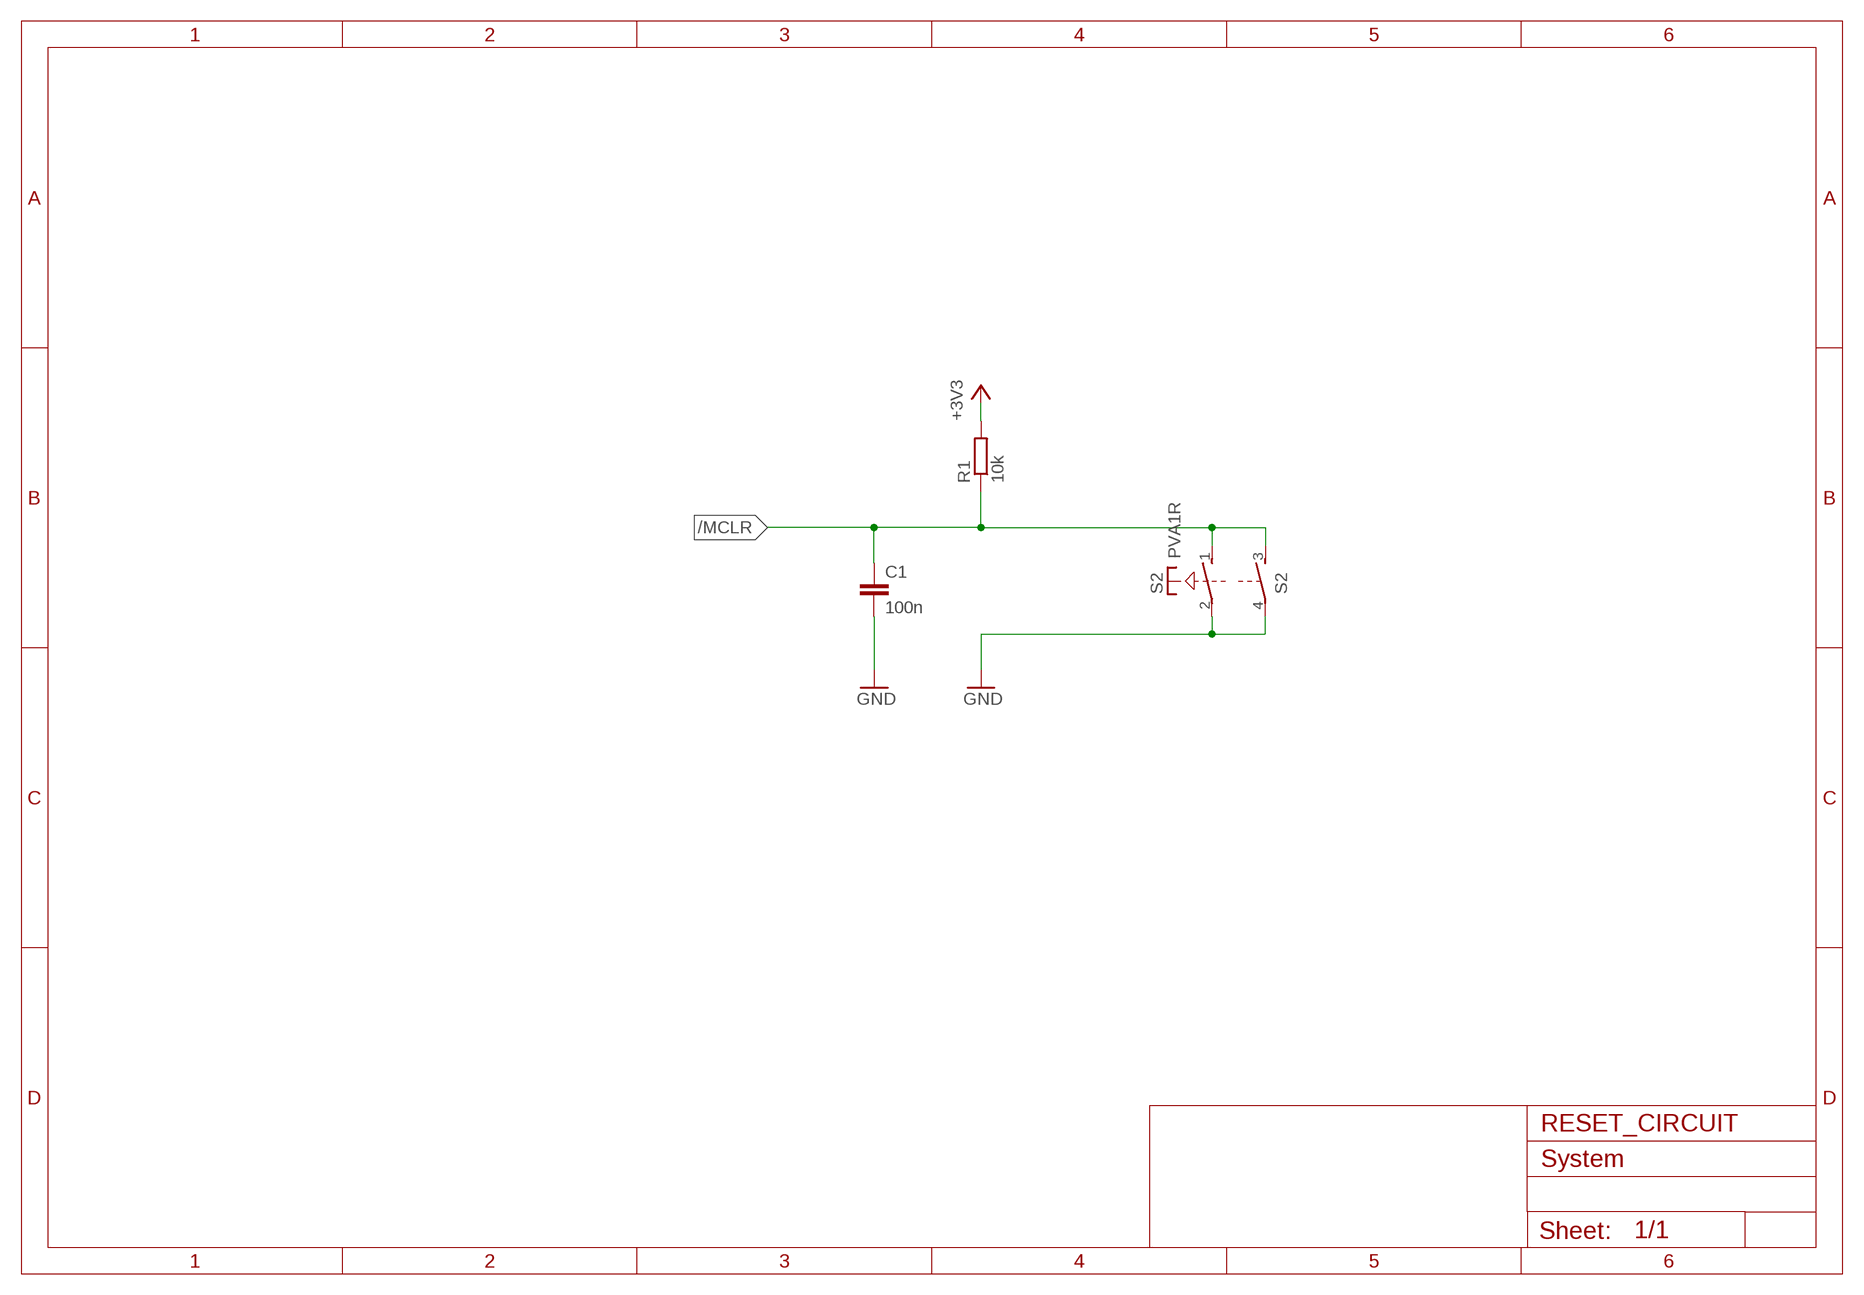
[diagram p11: schematic, module RESET_CIRCUIT, sheet 1]

### Parts
C1  100n  C-EU050-025X075  [C050-025X075]
R1  10k  R-EU_0207/10  [0207/10]
S2  PVA1R  [PVA1R]

### Nets
+3V3: R1.2
/MCLR: C1.1 R1.1 S2.1(1:S) S2.3(2:S)
GND: C1.2 S2.2(1:P) S2.4(2:P)

### Notes on the sheet
- RESET_CIRCUIT

### Library data of the parts
C1 = rcl:C-EU: CAPACITOR, European symbol; SPICEPREFIX: C
R1 = rcl:R-EU_: RESISTOR, European symbol; SPICEPREFIX: R
S2 = switch-misc:PVA1R: ITT SWITCH

## Module MICROCONTROLLER
Ports: E1_2(in) E1_1(in) E2_1(in) E2_2(in) M1_1(out) M1_2(out) M2_1(out) M2_2(out) BUT_2_IN(in) BUT_1_IN(in) RX(in) TX(out) LED_1_C(io) LED_2_C(io) LED_3_C(io) NFAULT(in) NSLEEP(io) M1_I(in) M2_I(in) /MCLR(io) SDA1(io) SCL1(io) PGEC1(io) PGED1(io) +3V3(pwr) GND(pwr) EXTRA1(io) EXTRA2(io) EXTRA3(io)
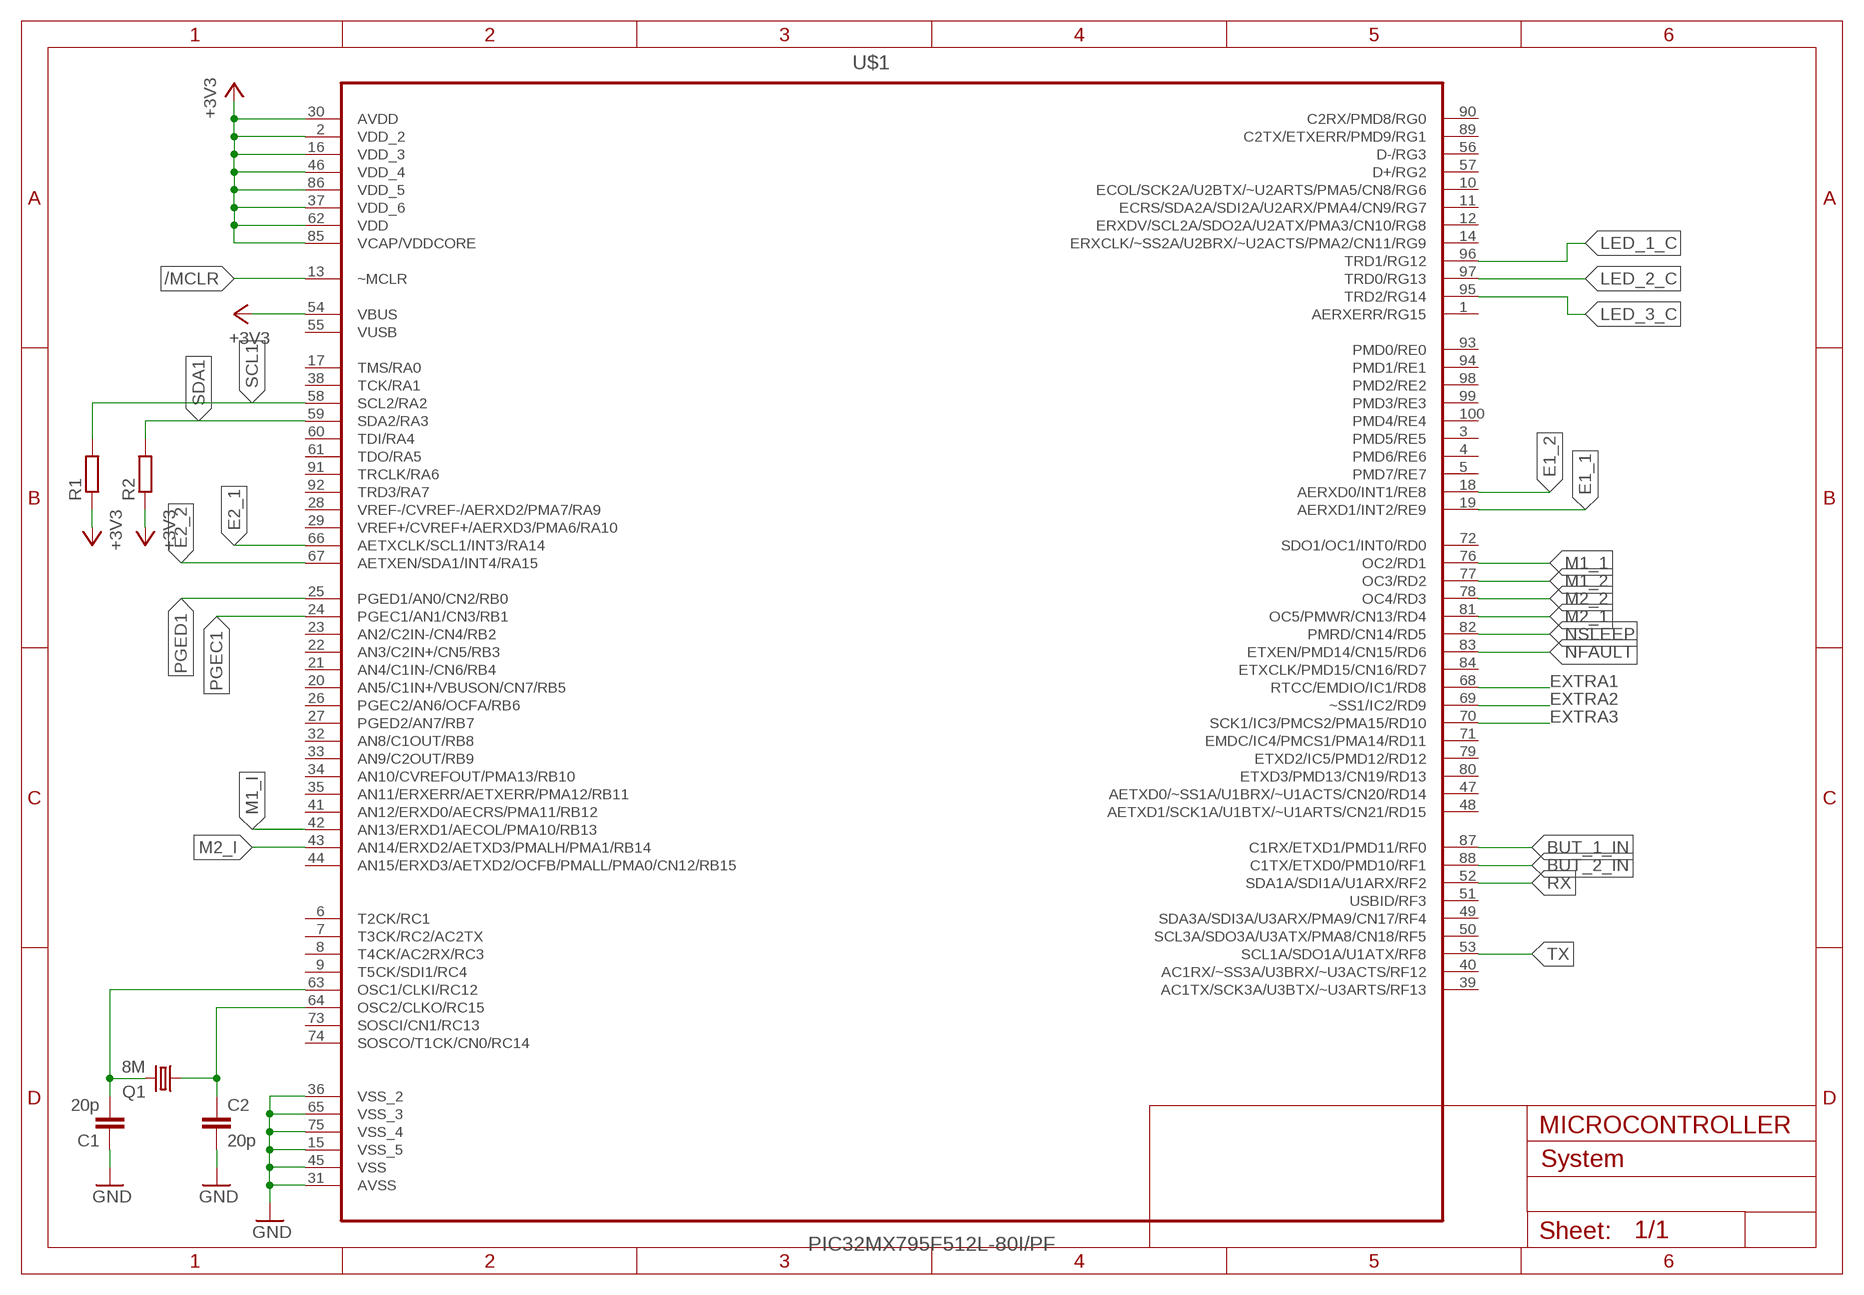
[diagram p12: schematic, module MICROCONTROLLER, sheet 1]

### Parts
C1  20p  C-EU025-030X050  [C025-030X050]
C2  20p  C-EU025-030X050  [C025-030X050]
Q1  8M  CRYSTALHC49S  [HC49/S]
R1  R-EU_M0805  [M0805]
R2  R-EU_M0805  [M0805]
U$1  PIC32MX795F512L-80I/PF  [QFP50P1600X1600X120-100N]

### Nets
+3V3: R1.1 R2.1 U$1.2(VDD_2) U$1.16(VDD_3) U$1.30(AVDD) U$1.37(VDD_6) U$1.46(VDD_4) U$1.54(VBUS) U$1.62(VDD) U$1.85(VCAP/VDDCORE) U$1.86(VDD_5)
/MCLR: U$1.13(~MCLR)
BUT_1_IN: U$1.87(C1RX/ETXD1/PMD11/RF0)
BUT_2_IN: U$1.88(C1TX/ETXD0/PMD10/RF1)
E1_1: U$1.19(AERXD1/INT2/RE9)
E1_2: U$1.18(AERXD0/INT1/RE8)
E2_1: U$1.66(AETXCLK/SCL1/INT3/RA14)
E2_2: U$1.67(AETXEN/SDA1/INT4/RA15)
EXTRA1: U$1.68(RTCC/EMDIO/IC1/RD8)
EXTRA2: U$1.69(~SS1/IC2/RD9)
EXTRA3: U$1.70(SCK1/IC3/PMCS2/PMA15/RD10)
GND: C1.1 C2.2 U$1.15(VSS_5) U$1.31(AVSS) U$1.36(VSS_2) U$1.45(VSS) U$1.65(VSS_3) U$1.75(VSS_4)
LED_1_C: U$1.96(TRD1/RG12)
LED_2_C: U$1.97(TRD0/RG13)
LED_3_C: U$1.95(TRD2/RG14)
M1_1: U$1.76(OC2/RD1)
M1_2: U$1.77(OC3/RD2)
M1_I: U$1.42(AN13/ERXD1/AECOL/PMA10/RB13)
M2_1: U$1.81(OC5/PMWR/CN13/RD4)
M2_2: U$1.78(OC4/RD3)
M2_I: U$1.43(AN14/ERXD2/AETXD3/PMALH/PMA1/RB14)
N$4: C1.2 Q1.2 U$1.63(OSC1/CLKI/RC12)
N$6: C2.1 Q1.1 U$1.64(OSC2/CLKO/RC15)
NFAULT: U$1.83(ETXEN/PMD14/CN15/RD6)
NSLEEP: U$1.82(PMRD/CN14/RD5)
PGEC1: U$1.24(PGEC1/AN1/CN3/RB1)
PGED1: U$1.25(PGED1/AN0/CN2/RB0)
RX: U$1.52(SDA1A/SDI1A/U1ARX/RF2)
SCL1: R1.2 U$1.58(SCL2/RA2)
SDA1: R2.2 U$1.59(SDA2/RA3)
TX: U$1.53(SCL1A/SDO1A/U1ATX/RF8)
Unconnected: U$1.1(AERXERR/RG15) U$1.3(PMD5/RE5) U$1.4(PMD6/RE6) U$1.5(PMD7/RE7) U$1.6(T2CK/RC1) U$1.7(T3CK/RC2/AC2TX) U$1.8(T4CK/AC2RX/RC3) U$1.9(T5CK/SDI1/RC4) U$1.10(ECOL/SCK2A/U2BTX/~U2ARTS/PMA5/CN8/RG6) U$1.11(ECRS/SDA2A/SDI2A/U2ARX/PMA4/CN9/RG7) U$1.12(ERXDV/SCL2A/SDO2A/U2ATX/PMA3/CN10/RG8) U$1.14(ERXCLK/~SS2A/U2BRX/~U2ACTS/PMA2/CN11/RG9) U$1.17(TMS/RA0) U$1.20(AN5/C1IN+/VBUSON/CN7/RB5) U$1.21(AN4/C1IN-/CN6/RB4) U$1.22(AN3/C2IN+/CN5/RB3) U$1.23(AN2/C2IN-/CN4/RB2) U$1.26(PGEC2/AN6/OCFA/RB6) U$1.27(PGED2/AN7/RB7) U$1.28(VREF-/CVREF-/AERXD2/PMA7/RA9) U$1.29(VREF+/CVREF+/AERXD3/PMA6/RA10) U$1.32(AN8/C1OUT/RB8) U$1.33(AN9/C2OUT/RB9) U$1.34(AN10/CVREFOUT/PMA13/RB10) U$1.35(AN11/ERXERR/AETXERR/PMA12/RB11) U$1.38(TCK/RA1) U$1.39(AC1TX/SCK3A/U3BTX/~U3ARTS/RF13) U$1.40(AC1RX/~SS3A/U3BRX/~U3ACTS/RF12) U$1.41(AN12/ERXD0/AECRS/PMA11/RB12) U$1.44(AN15/ERXD3/AETXD2/OCFB/PMALL/PMA0/CN12/RB15) U$1.47(AETXD0/~SS1A/U1BRX/~U1ACTS/CN20/RD14) U$1.48(AETXD1/SCK1A/U1BTX/~U1ARTS/CN21/RD15) U$1.49(SDA3A/SDI3A/U3ARX/PMA9/CN17/RF4) U$1.50(SCL3A/SDO3A/U3ATX/PMA8/CN18/RF5) U$1.51(USBID/RF3) U$1.56(D-/RG3) U$1.57(D+/RG2) U$1.60(TDI/RA4) U$1.61(TDO/RA5) U$1.71(EMDC/IC4/PMCS1/PMA14/RD11) U$1.72(SDO1/OC1/INT0/RD0) U$1.73(SOSCI/CN1/RC13) U$1.74(SOSCO/T1CK/CN0/RC14) U$1.79(ETXD2/IC5/PMD12/RD12) U$1.80(ETXD3/PMD13/CN19/RD13) U$1.84(ETXCLK/PMD15/CN16/RD7) U$1.89(C2TX/ETXERR/PMD9/RG1) U$1.90(C2RX/PMD8/RG0) U$1.91(TRCLK/RA6) U$1.92(TRD3/RA7) U$1.93(PMD0/RE0) U$1.94(PMD1/RE1) U$1.98(PMD2/RE2) U$1.99(PMD3/RE3) U$1.100(PMD4/RE4)

### Notes on the sheet
- MICROCONTROLLER

### Power pins joined to a net without a drawn wire
VUSB: U$1.55(VUSB)

### Library data of the parts
C1 C2 = rcl:C-EU: CAPACITOR, European symbol; SPICEPREFIX: C
Q1 = crystal:CRYSTAL: CRYSTAL; OC_FARNELL: 1667008; OC_NEWARK: unknown
R1 R2 = rcl:R-EU_: RESISTOR, European symbol; SPICEPREFIX: R
U$1 = PIC32MX795F512L-80I_PF:PIC32MX795F512L-80I/PF: IC, 32BIT MCU; AVAILABILITY: Good; DESCRIPTION: PIC32MX Series 128 kB RAM 512 kB Flash SMT 32-Bit Microcontroller - TQFP-100; MF: Microchip; MP: PIC32MX795F512L-80I/PF; PACKAGE: TQFP-100 Microchip; PRICE: 9.61 USD

## Module CURRENT_MONITOR
Ports: ISEN(in) GND(pwr) V_OUT(out) VCC(pwr)
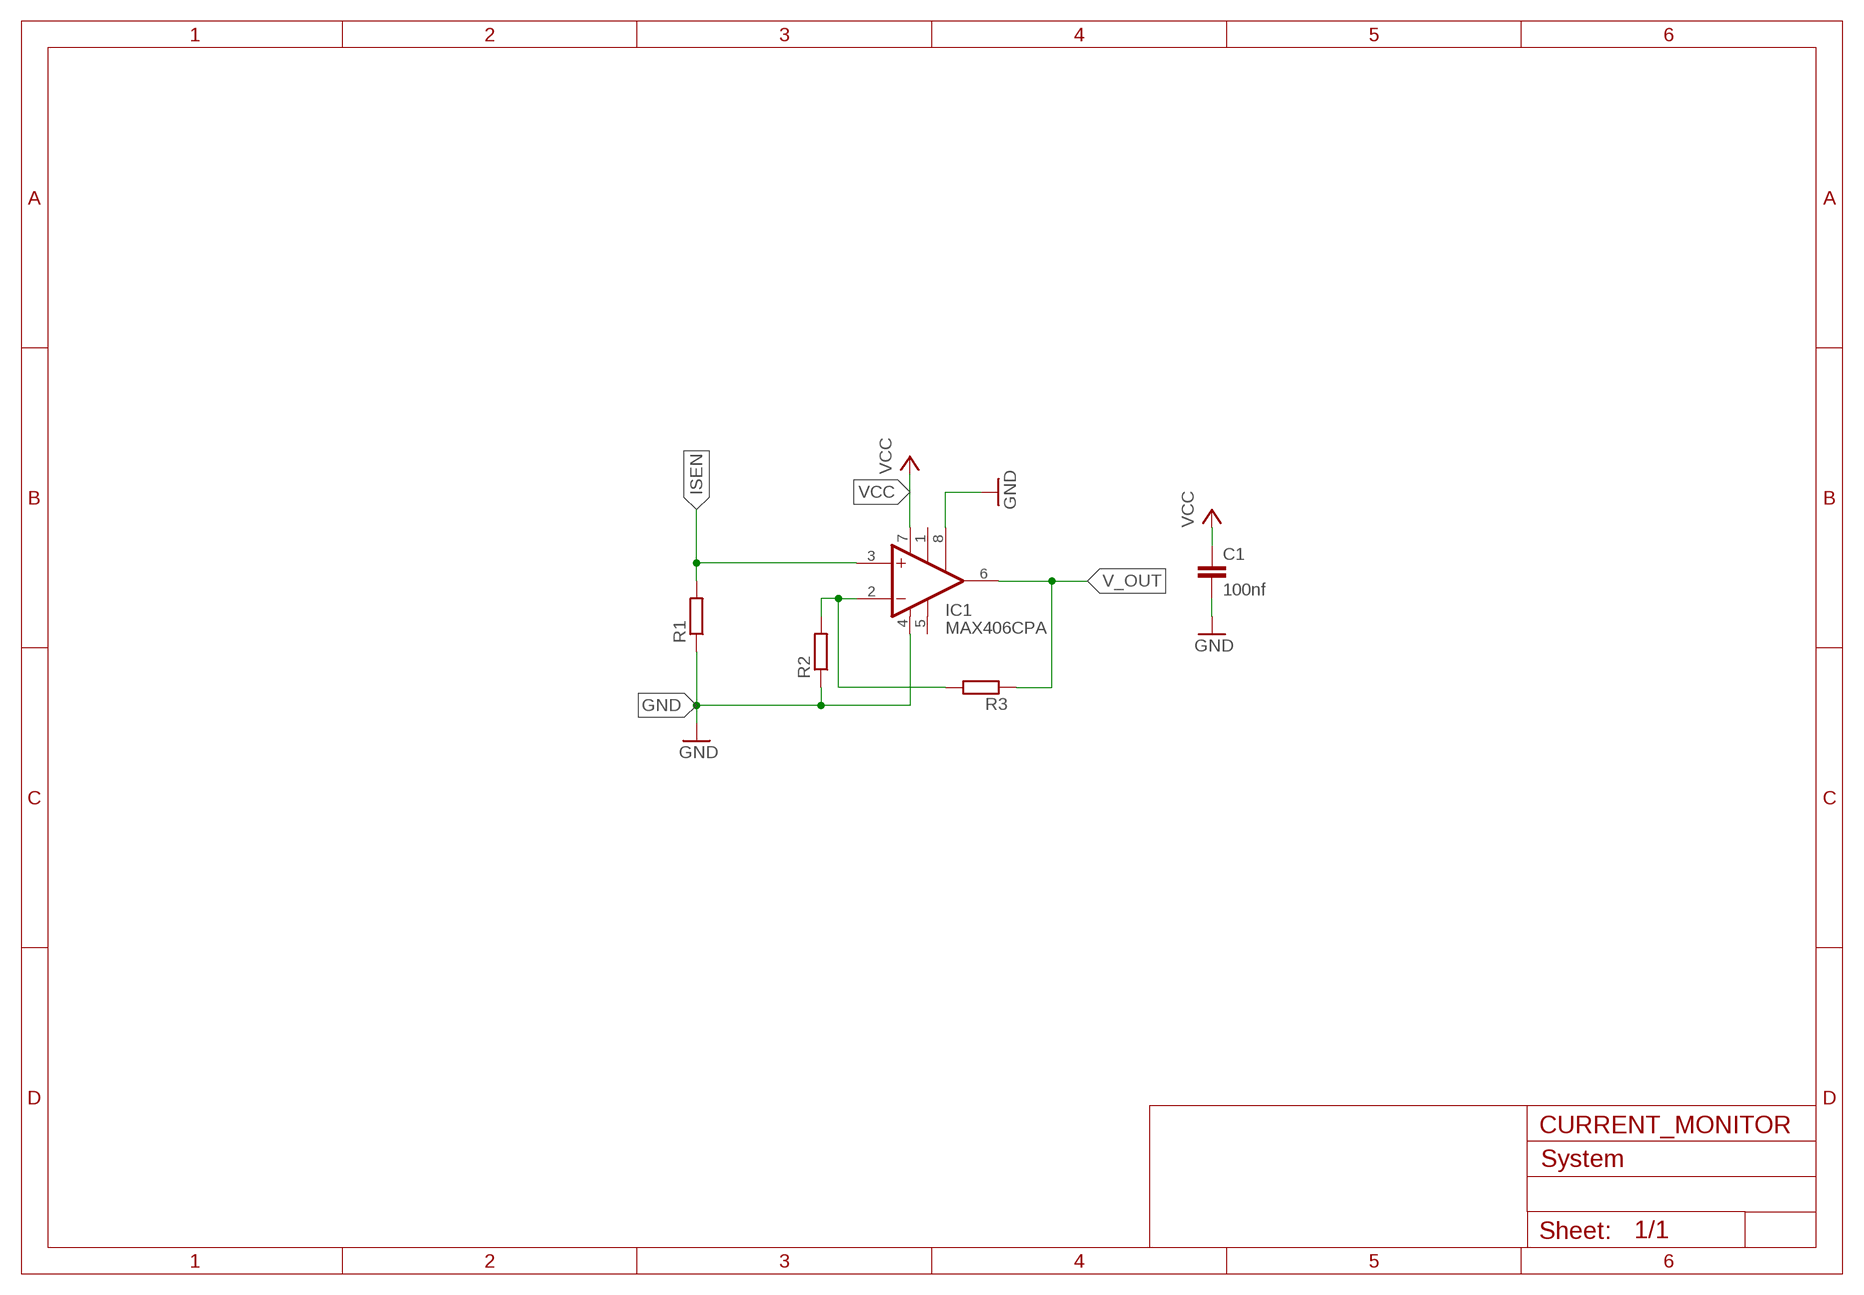
[diagram p13: schematic, module CURRENT_MONITOR, sheet 1]

### Parts
C1  100nf  C-EU050-024X044  [C050-024X044]
IC1  MAX406CPA  [DIL08]
R1  R-EU_0617/5V  [0617V]
R2  R-EU_0207/10  [0207/10]
R3  R-EU_0207/10  [0207/10]

### Nets
GND: C1.2 IC1.4(V-) IC1.8(BW) R1.1 R2.1
ISEN: IC1.3(+IN) R1.2
N$1: IC1.2(-IN) R2.2 R3.2
V_OUT: IC1.6(OUT) R3.1
VCC: C1.1 IC1.7(V+)
Unconnected: IC1.1(OFF1) IC1.5(OFF2)

### Notes on the sheet
- CURRENT_MONITOR

### Library data of the parts
C1 = rcl:C-EU: CAPACITOR, European symbol; SPICEPREFIX: C
IC1 = maxim:MAX406CPA: OP AMP; OC_FARNELL: unknown; OC_NEWARK: unknown
R1-R3 = resistor:R-EU_: RESISTOR, European symbol

## Module LED_DRIVER
Ports: LED_POWER(in) LED_1(in) LED_2(in) LED_3(in) GND(pwr) LED_1_C(io) LED_2_C(io) LED_3_C(io)
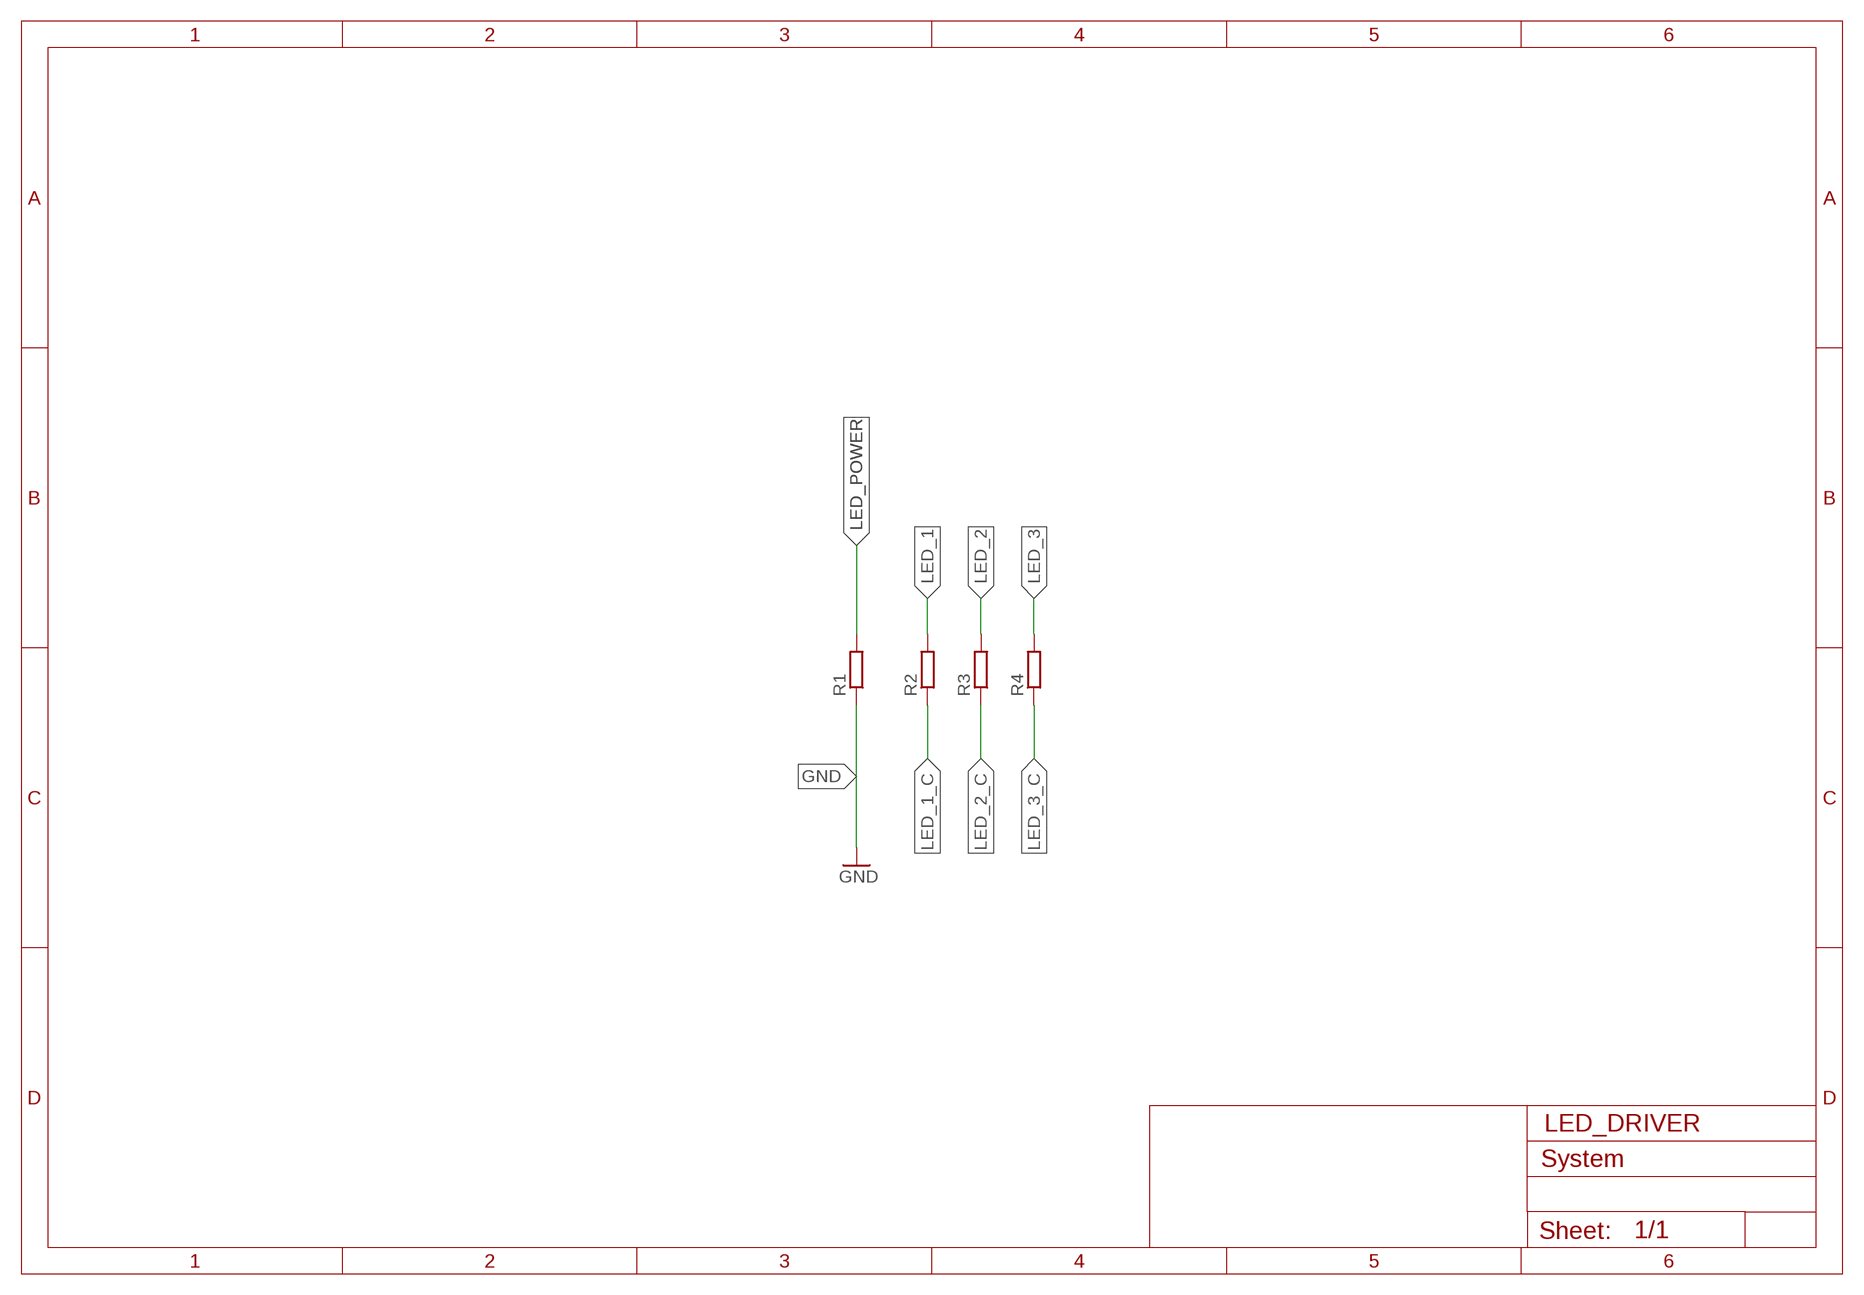
[diagram p14: schematic, module LED_DRIVER, sheet 1]

### Parts
R1  R-EU_M1206  [M1206]
R2  R-EU_M1206  [M1206]
R3  R-EU_M1206  [M1206]
R4  R-EU_M1206  [M1206]

### Nets
GND: R1.1
LED_1: R2.2
LED_1_C: R2.1
LED_2: R3.2
LED_2_C: R3.1
LED_3: R4.2
LED_3_C: R4.1
LED_POWER: R1.2

### Notes on the sheet
- LED_DRIVER

### Library data of the parts
R1-R4 = rcl:R-EU_: RESISTOR, European symbol; SPICEPREFIX: R

## Module PROGRAMMER
Ports: PGEC(io) PGED(io) /MCLR(io) VDD_TARGET(pwr) VSS(pwr)
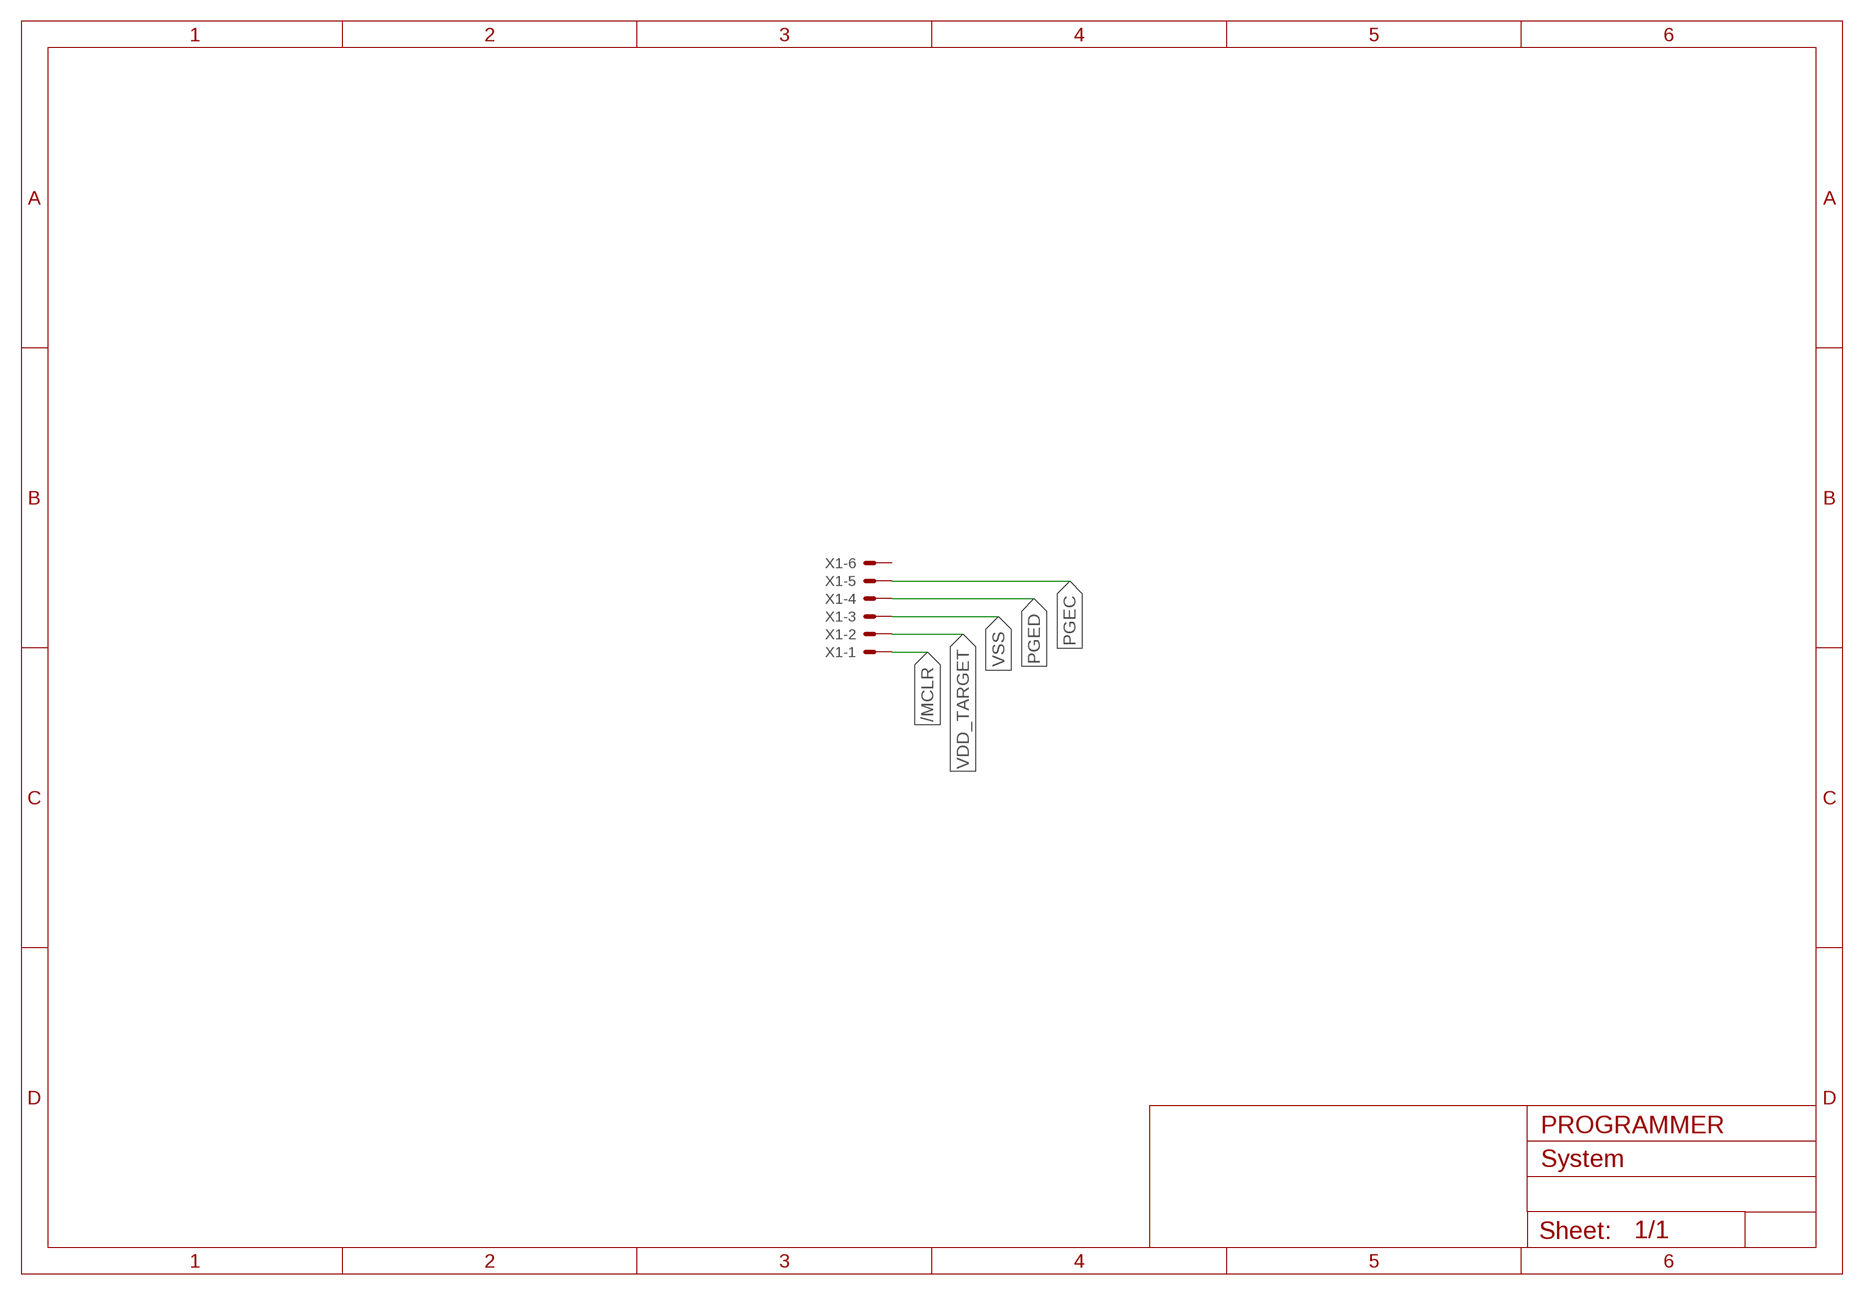
[diagram p15: schematic, module PROGRAMMER, sheet 1]

### Parts
X1  22-23-2061  [22-23-2061]

### Nets
/MCLR: X1.1
PGEC: X1.5
PGED: X1.4
VDD_TARGET: X1.2
VSS: X1.3
Unconnected: X1.6

### Notes on the sheet
- PROGRAMMER

### Library data of the parts
X1 = con-molex:22-23-2061: .100" (2.54mm) Center Header - 6 Pin; MF: MOLEX; MPN: 22-23-2061; OC_FARNELL: 1462922; OC_NEWARK: 27C1933

## Module H-BRIDGE
Ports: GND(pwr) VCC(pwr) AIN1(in) AIN2(in) BIN1(in) BIN2(in) NFAULT(out) AOUT1(out) AOUT2(out) BOUT1(out) BOUT2(out) NSLEEP(io) I1_OUT(out) I2_OUT(out)
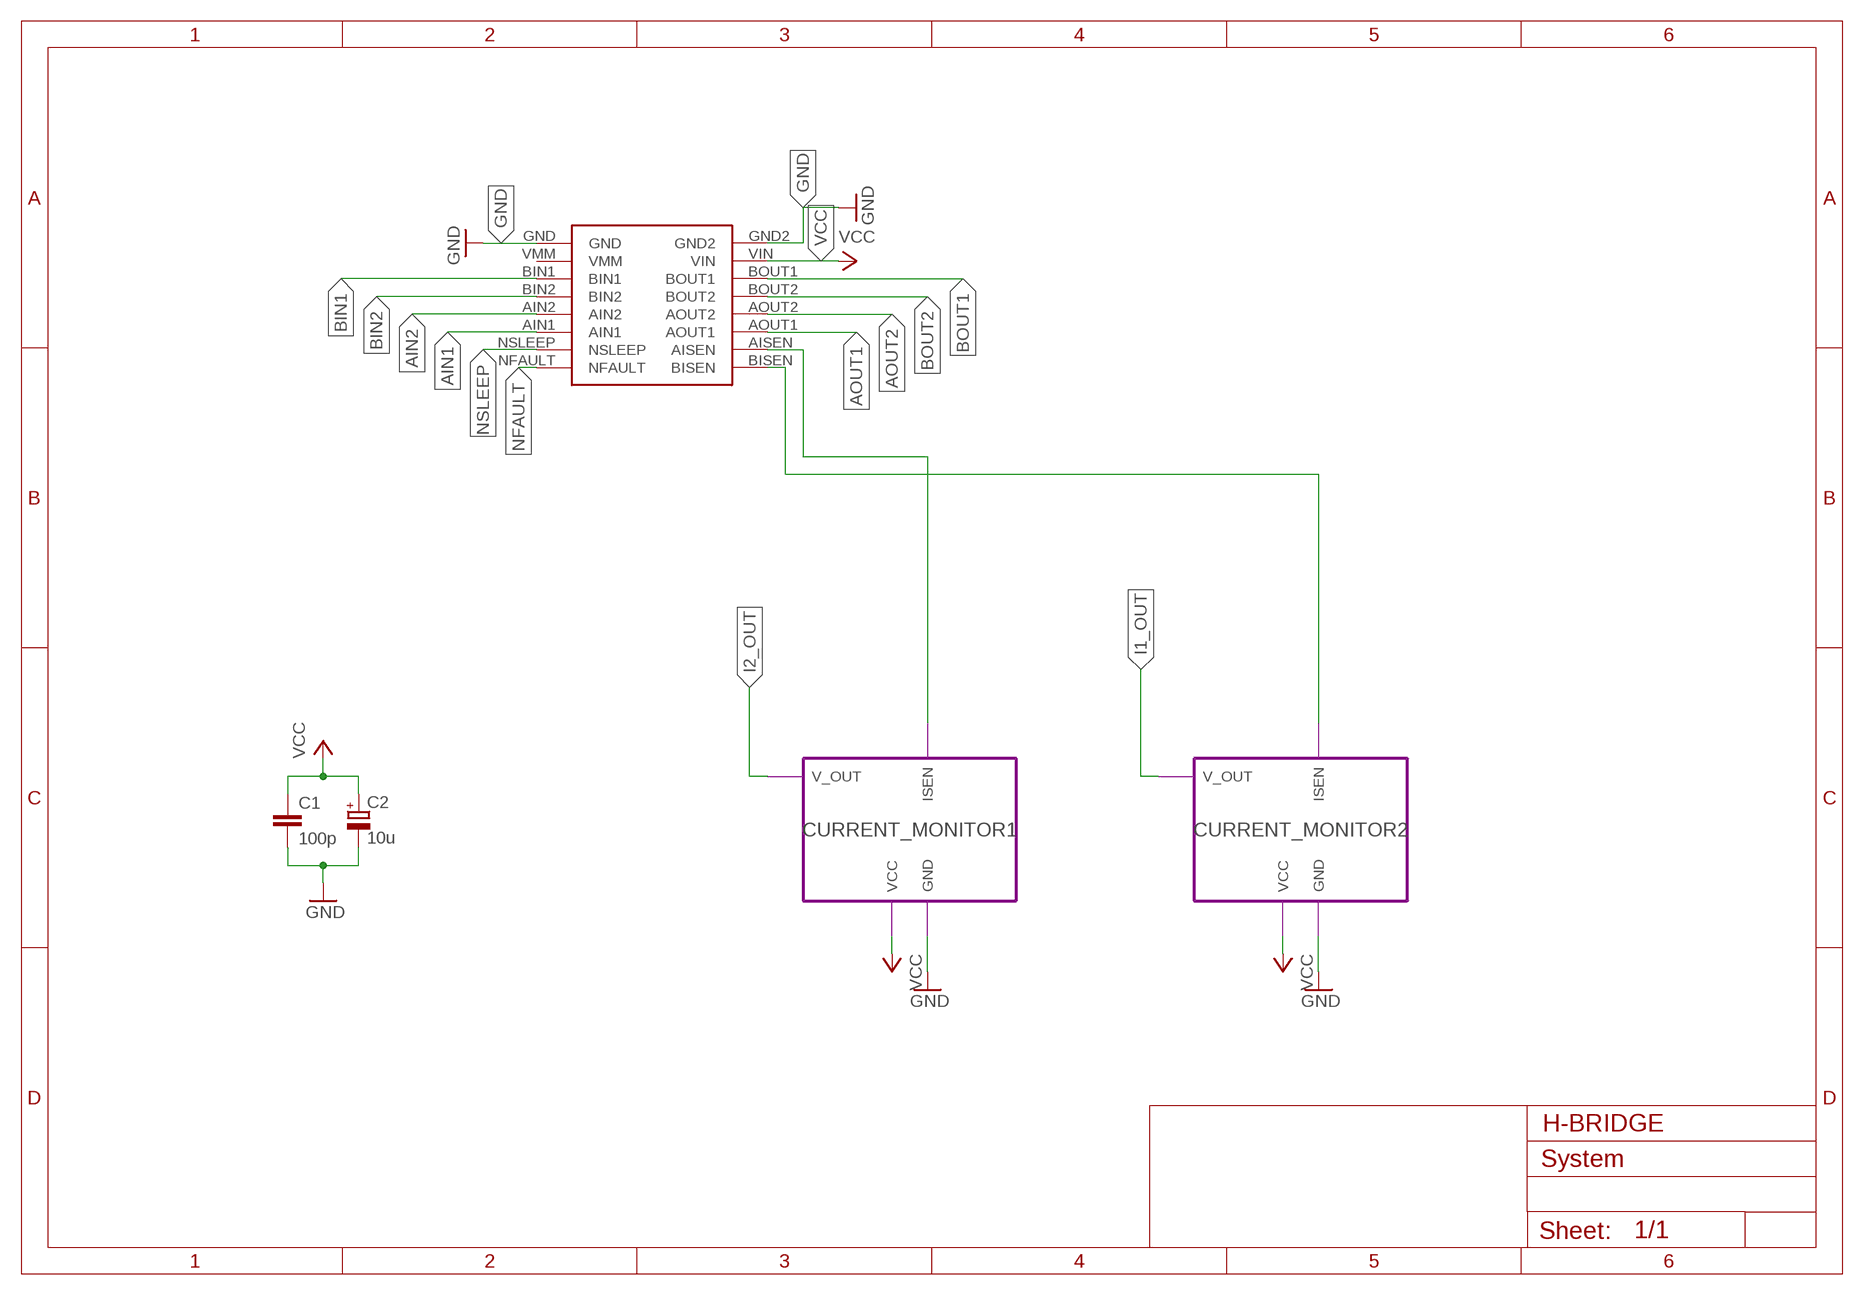
[diagram p16: schematic, module H-BRIDGE, sheet 1]

### Parts
C1  100p  C-EU050-024X044  [C050-024X044]
C2  10u  CPOL-EUE5-10.5  [E5-10,5]
U$1  DRV8833_MODULE  [DRV8833_MODULE]

### Module instances
CURRENT_MONITOR1 = CURRENT_MONITOR
CURRENT_MONITOR2 = CURRENT_MONITOR

### Nets
AIN1: U$1.AIN1
AIN2: U$1.AIN2
AOUT1: U$1.AOUT1
AOUT2: U$1.AOUT2
BIN1: U$1.BIN1
BIN2: U$1.BIN2
BOUT1: U$1.BOUT1
BOUT2: U$1.BOUT2
GND: C1.2 C2.- U$1.GND U$1.GND2 ; port CURRENT_MONITOR1.GND CURRENT_MONITOR2.GND
I1_OUT: port CURRENT_MONITOR2.V_OUT
I2_OUT: port CURRENT_MONITOR1.V_OUT
N$8: U$1.BISEN ; port CURRENT_MONITOR2.ISEN
N$9: U$1.AISEN ; port CURRENT_MONITOR1.ISEN
NFAULT: U$1.NFAULT
NSLEEP: U$1.NSLEEP
VCC: C1.1 C2.+ U$1.VIN ; port CURRENT_MONITOR1.VCC CURRENT_MONITOR2.VCC
Unconnected: U$1.VMM

### Notes on the sheet
- H-BRIDGE

### Library data of the parts
C1 = rcl:C-EU: CAPACITOR, European symbol; SPICEPREFIX: C
C2 = rcl:CPOL-EU: POLARIZED CAPACITOR, European symbol; SPICEPREFIX: C
U$1 = components:DRV8833_MODULE

## Module EXTRA
Ports: +3V3(pwr) GND(pwr) EXTRA1(io) EXTRA2(io) EXTRA3(io)
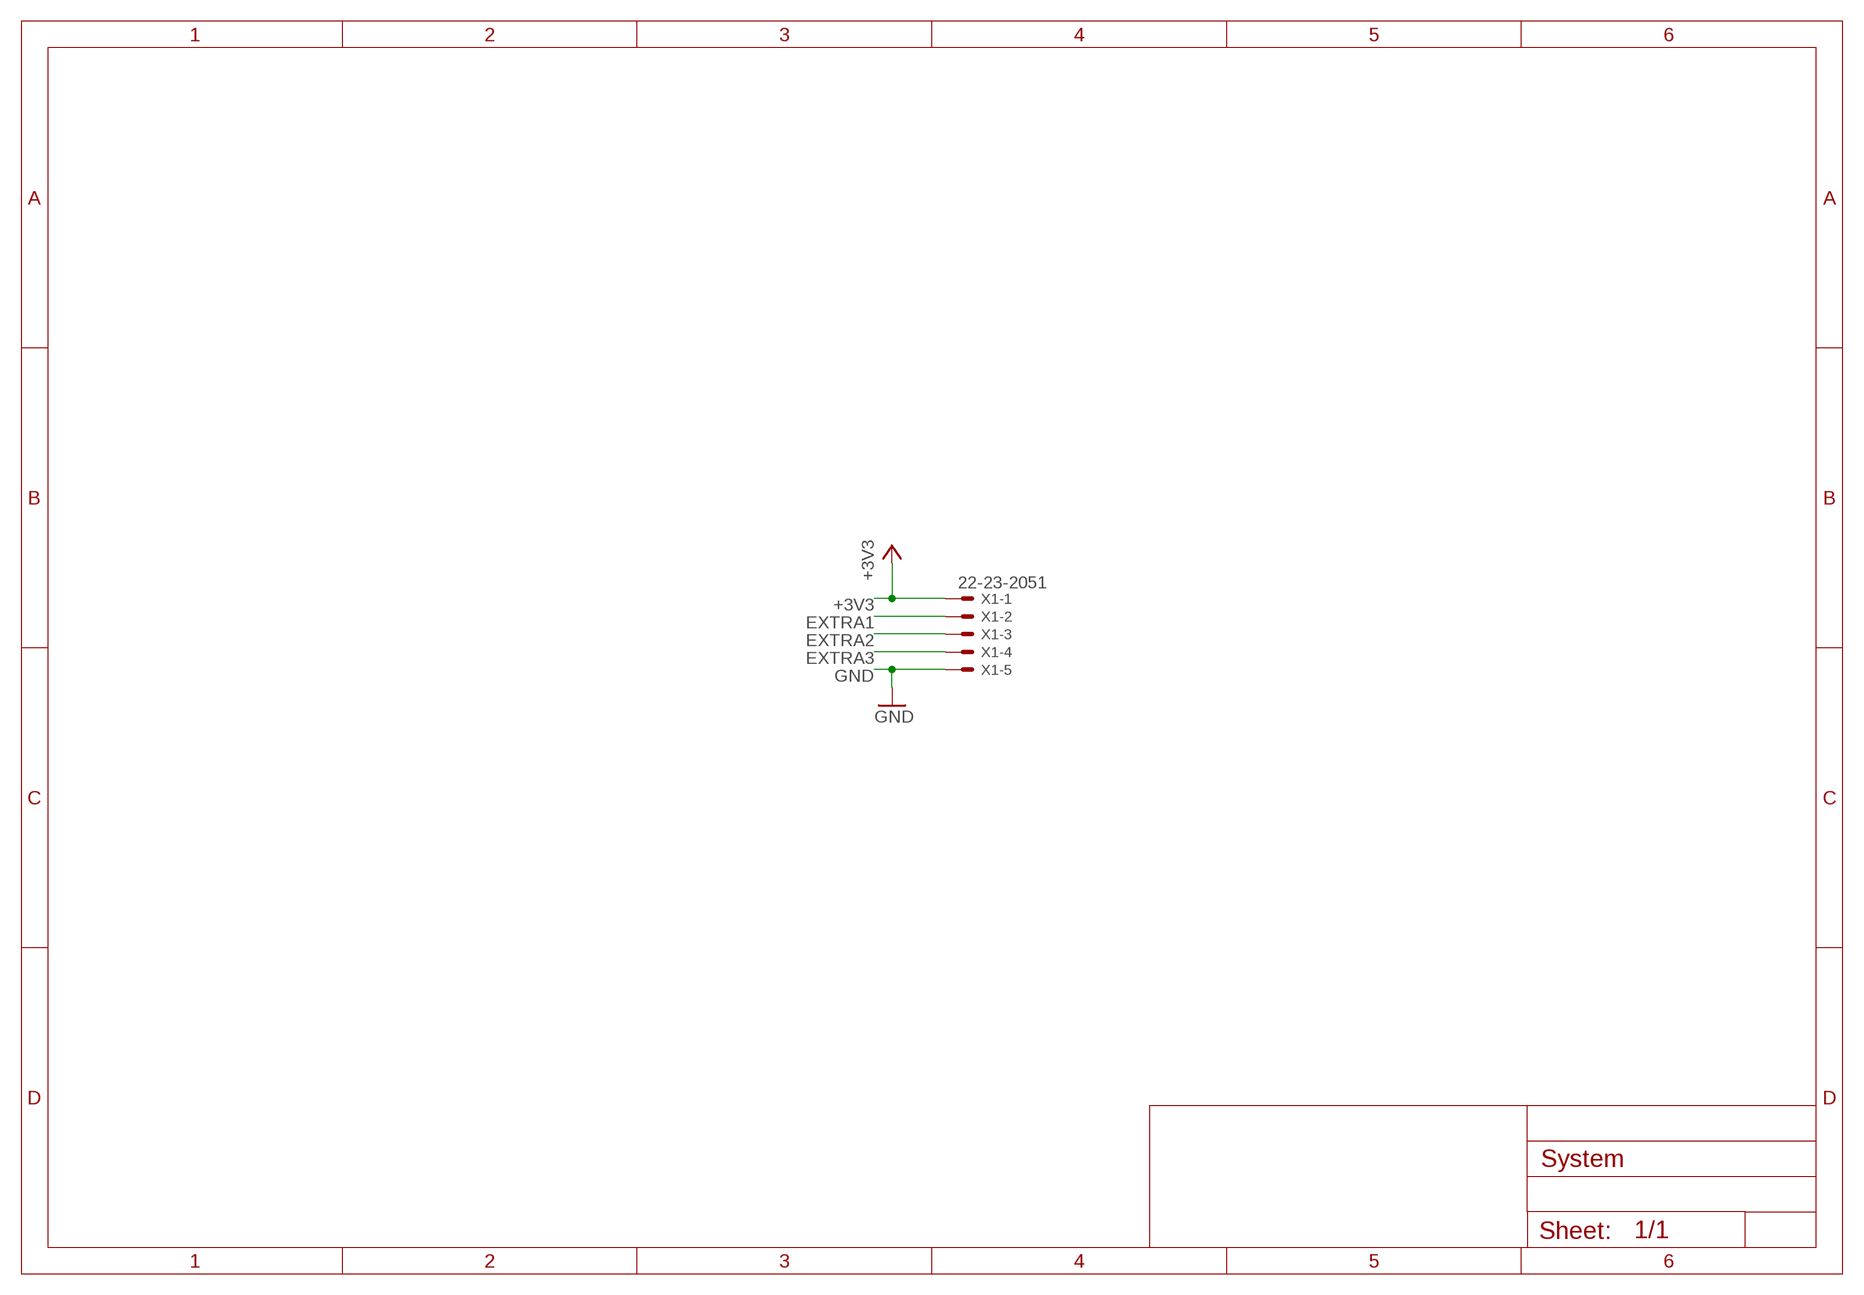
[diagram p17: schematic, module EXTRA, sheet 1]

### Parts
X1  22-23-2051  [22-23-2051]

### Nets
+3V3: X1.1
EXTRA1: X1.2
EXTRA2: X1.3
EXTRA3: X1.4
GND: X1.5

### Library data of the parts
X1 = con-molex:22-23-2051: .100" (2.54mm) Center Header - 5 Pin; MF: MOLEX; MPN: 22-23-2051; OC_FARNELL: 1462952; OC_NEWARK: 38C9178

## Module MAIN_BOARD
Ports: LED_3(out) LED_2(out) LED_1(out) RX(in) TX(out) VCC(pwr) +3V3(pwr) +5V(pwr) GND(pwr) M1_P(io) M1_N(io) M2_P(io) M2_N(io) E1_1(in) E1_2(in) E2_1(in) E2_2(in) SCL(io) SDA(io) PGEC1(io) PGED1(io) /MCLR(io) BUT1(in) BUT2(in)
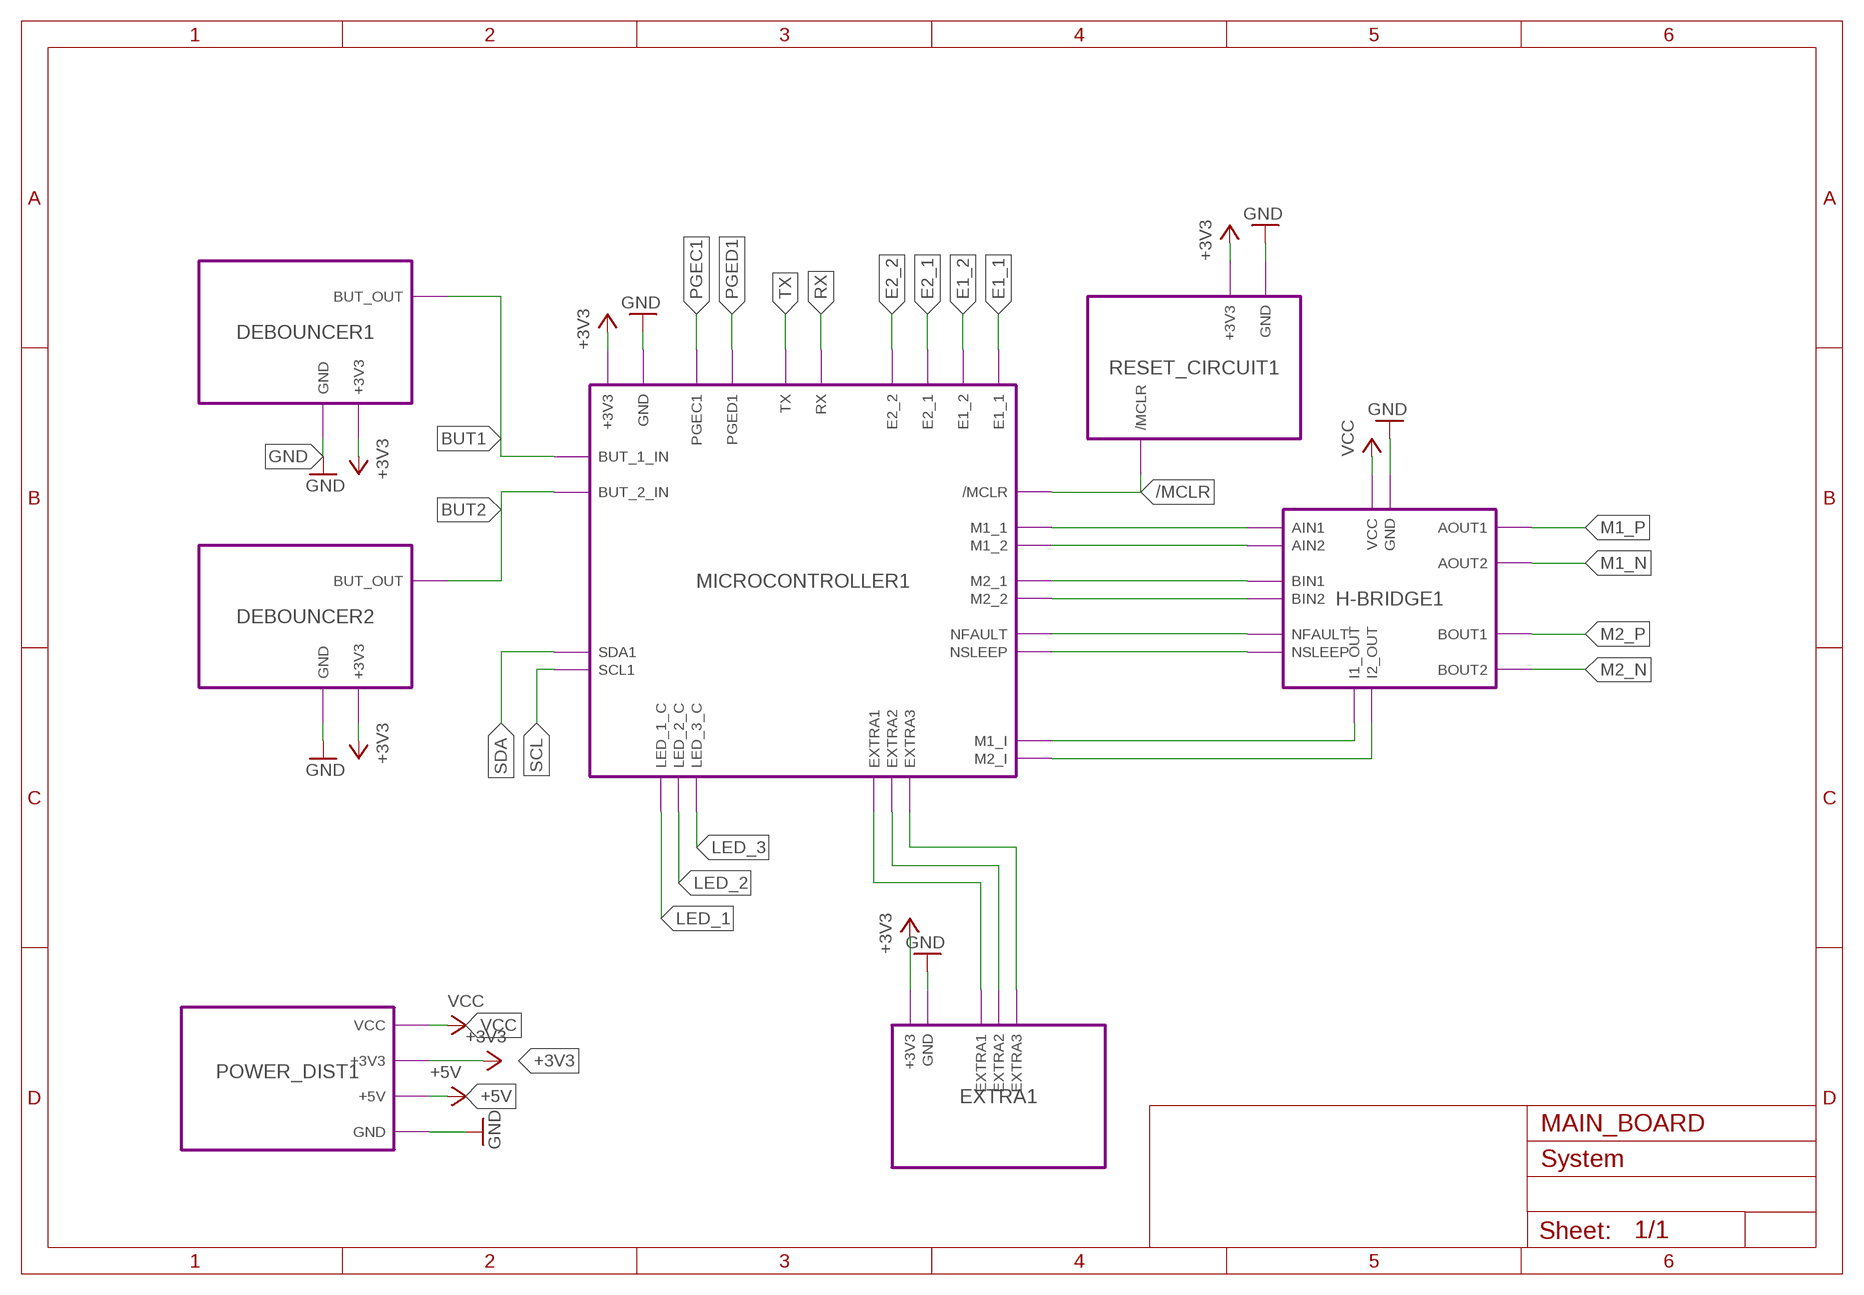
[diagram p18: schematic, module MAIN_BOARD, sheet 1]

### Module instances
DEBOUNCER1 = DEBOUNCER
DEBOUNCER2 = DEBOUNCER
POWER_DIST1 = POWER_DIST
RESET_CIRCUIT1 = RESET_CIRCUIT
MICROCONTROLLER1 = MICROCONTROLLER
H-BRIDGE1 = H-BRIDGE
EXTRA1 = EXTRA

### Nets
+3V3: port POWER_DIST1.+3V3 DEBOUNCER1.+3V3 DEBOUNCER2.+3V3 MICROCONTROLLER1.+3V3 RESET_CIRCUIT1.+3V3 EXTRA1.+3V3
+5V: port POWER_DIST1.+5V
/MCLR: port MICROCONTROLLER1./MCLR RESET_CIRCUIT1./MCLR
BUT1: port MICROCONTROLLER1.BUT_1_IN DEBOUNCER1.BUT_OUT
BUT2: port MICROCONTROLLER1.BUT_2_IN DEBOUNCER2.BUT_OUT
E1_1: port MICROCONTROLLER1.E1_1
E1_2: port MICROCONTROLLER1.E1_2
E2_1: port MICROCONTROLLER1.E2_1
E2_2: port MICROCONTROLLER1.E2_2
GND: port DEBOUNCER1.GND DEBOUNCER2.GND H-BRIDGE1.GND POWER_DIST1.GND MICROCONTROLLER1.GND RESET_CIRCUIT1.GND EXTRA1.GND
LED_1: port MICROCONTROLLER1.LED_1_C
LED_2: port MICROCONTROLLER1.LED_2_C
LED_3: port MICROCONTROLLER1.LED_3_C
M1_N: port H-BRIDGE1.AOUT2
M1_P: port H-BRIDGE1.AOUT1
M2_N: port H-BRIDGE1.BOUT2
M2_P: port H-BRIDGE1.BOUT1
N$1: port MICROCONTROLLER1.M1_1 H-BRIDGE1.AIN1
N$2: port H-BRIDGE1.AIN2 MICROCONTROLLER1.M1_2
N$3: port MICROCONTROLLER1.M2_1 H-BRIDGE1.BIN1
N$4: port MICROCONTROLLER1.M2_2 H-BRIDGE1.BIN2
N$5: port H-BRIDGE1.I1_OUT MICROCONTROLLER1.M1_I
N$6: port MICROCONTROLLER1.M2_I H-BRIDGE1.I2_OUT
N$7: port EXTRA1.EXTRA1 MICROCONTROLLER1.EXTRA1
N$8: port MICROCONTROLLER1.EXTRA2 EXTRA1.EXTRA2
N$9: port EXTRA1.EXTRA3 MICROCONTROLLER1.EXTRA3
N$12: port H-BRIDGE1.NFAULT MICROCONTROLLER1.NFAULT
N$13: port H-BRIDGE1.NSLEEP MICROCONTROLLER1.NSLEEP
PGEC1: port MICROCONTROLLER1.PGEC1
PGED1: port MICROCONTROLLER1.PGED1
RX: port MICROCONTROLLER1.RX
SCL: port MICROCONTROLLER1.SCL1
SDA: port MICROCONTROLLER1.SDA1
TX: port MICROCONTROLLER1.TX
VCC: port POWER_DIST1.VCC H-BRIDGE1.VCC

### Notes on the sheet
- MAIN_BOARD

### Library data of the parts

## Board
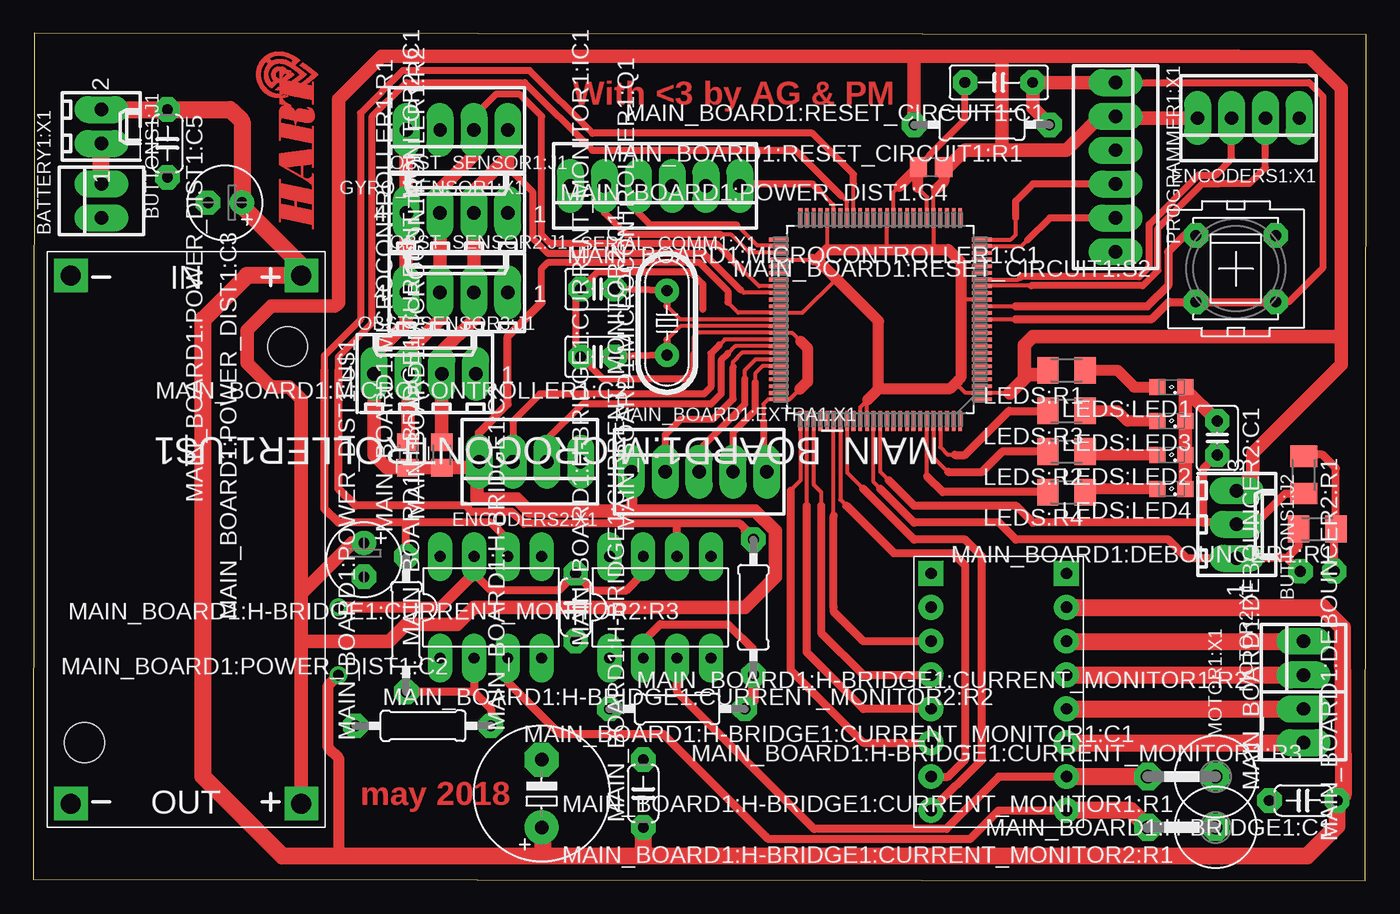
[diagram p19: board, top side]
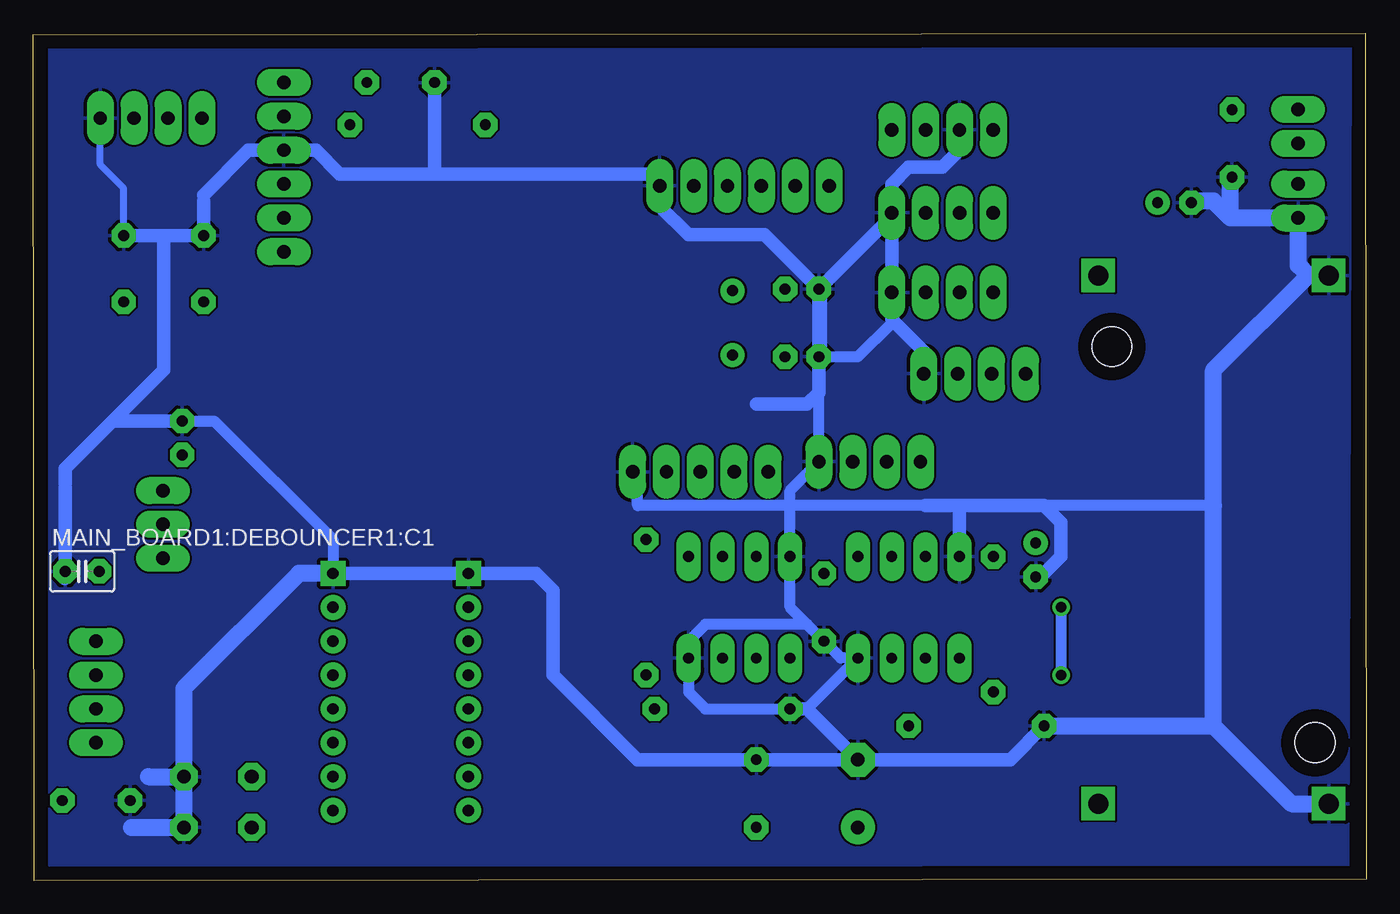
[diagram p20: board, bottom side, seen from below]

Size 99.97 x 63.56 mm. Coordinates in mm from the lower left corner, seen from the top.
Outline: 0,0.09 99.91,0 99.97,63.47 0.06,63.56 0,0.09
Copper layers (1*16): Top 0.035mm / dielectric 1.5mm / Bottom 0.035mm
Design rules "default *": minimum track width 6mil, minimum drill 0.8mm, track to track 6mil, track to pad 6mil, pad to pad 6mil, via to via 6mil, smd to smd 6mil, copper to edge 40mil, drill to drill 6mil, minimum pad ring 20mil, minimum via ring 8mil, stop-mask expansion 4mil, vias tented up to drill 0mil, thermal gap 10mil

### Footprints (pad centres in the part's own frame; a part is rotated, then mirrored left to right if it is on the bottom)
22-23-2021 = drill 1 long: 1 -1.27,0; 2 1.27,0
6410-02 = drill 1.016 long: 1 1.27,0; 2 -1.27,0
6410-03 = drill 1.016 long: 1 2.54,0; 2 0,0; 3 -2.54,0
22-23-2041 = drill 1 long: 1 -3.81,0; 2 -1.27,0; 3 1.27,0; 4 3.81,0
SML0805 = smd 1.2 x 1.2: A 1.05,0; C -1.05,0
M1206 = smd 1.6 x 2: 1 -1.4,0; 2 1.4,0
C025-030X050 = drill 0.813 octagon: 1 -1.27,0; 2 1.27,0
22-23-2051 = drill 1 long: 1 -5.08,0; 2 -2.54,0; 3 0,0; 4 2.54,0; 5 5.08,0
C050-024X044 = drill 0.813 octagon: 1 -2.54,0; 2 2.54,0
E5-10,5 = drill 1.016 pad 2.54: + -2.54,0 | drill 1.016 pad 2.54 octagon: - 2.54,0
DIL08 = drill 0.813 long: 1 -3.81,-3.81; 2 -1.27,-3.81; 3 1.27,-3.81; 4 3.81,-3.81; 5 3.81,3.81; 6 1.27,3.81; 7 -1.27,3.81; 8 -3.81,3.81
0617V = drill 1.016 octagon: 1 -2.54,0; 2 2.54,0
0207/10 = drill 0.813 octagon: 1 -5.08,0; 2 5.08,0
DRV8833_MODULE = drill 0.85: AIN1 1.27,6.35; AIN2 1.27,8.89; AISEN 11.43,3.81; AOUT1 11.43,6.35; AOUT2 11.43,8.89; BIN1 1.27,13.97; BIN2 1.27,11.43; BISEN 11.43,1.27; BOUT1 11.43,13.97; BOUT2 11.43,11.43; NFAULT 1.27,1.27; NSLEEP 1.27,3.81; VIN 11.43,16.51; VMM 1.27,16.51 | drill 0.85 square: GND 1.27,19.05; GND2 11.43,19.05
HC49/S = drill 0.813: 1 -2.413,0; 2 2.413,0
M0805 = smd 1.3 x 1.6: 1 -0.95,0; 2 0.95,0
QFP50P1600X1600X120-100N = smd 1.473 x 0.279: 1 -7.62,5.994; 2 -7.62,5.512; 3 -7.62,5.004; 4 -7.62,4.496; 5 -7.62,3.988; 6 -7.62,3.505; 7 -7.62,2.997; 8 -7.62,2.489; 9 -7.62,2.007; 10 -7.62,1.499; 11 -7.62,0.991; 12 -7.62,0.508; 13 -7.62,0; 14 -7.62,-0.508; 15 -7.62,-0.991; 16 -7.62,-1.499; 17 -7.62,-2.007; 18 -7.62,-2.489; 19 -7.62,-2.997; 20 -7.62,-3.505; 21 -7.62,-3.988; 22 -7.62,-4.496; 23 -7.62,-5.004; 24 -7.62,-5.512; 25 -7.62,-5.994; 51 7.62,-5.994; 52 7.62,-5.512; 53 7.62,-5.004; 54 7.62,-4.496; 55 7.62,-3.988; 56 7.62,-3.505; 57 7.62,-2.997; 58 7.62,-2.489; 59 7.62,-2.007; 60 7.62,-1.499; 61 7.62,-0.991; 62 7.62,-0.508; 63 7.62,0; 64 7.62,0.508; 65 7.62,0.991; 66 7.62,1.499; 67 7.62,2.007; 68 7.62,2.489; 69 7.62,2.997; 70 7.62,3.505; 71 7.62,3.988; 72 7.62,4.496; 73 7.62,5.004; 74 7.62,5.512; 75 7.62,5.994 | smd 0.279 x 1.473: 26 -5.994,-7.62; 27 -5.512,-7.62; 28 -5.004,-7.62; 29 -4.496,-7.62; 30 -3.988,-7.62; 31 -3.505,-7.62; 32 -2.997,-7.62; 33 -2.489,-7.62; 34 -2.007,-7.62; 35 -1.499,-7.62; 36 -0.991,-7.62; 37 -0.508,-7.62; 38 0,-7.62; 39 0.508,-7.62; 40 0.991,-7.62; 41 1.499,-7.62; 42 2.007,-7.62; 43 2.489,-7.62; 44 2.997,-7.62; 45 3.505,-7.62; 46 3.988,-7.62; 47 4.496,-7.62; 48 5.004,-7.62; 49 5.512,-7.62; 50 5.994,-7.62; 76 5.994,7.62; 77 5.512,7.62; 78 5.004,7.62; 79 4.496,7.62; 80 3.988,7.62; 81 3.505,7.62; 82 2.997,7.62; 83 2.489,7.62; 84 2.007,7.62; 85 1.499,7.62; 86 0.991,7.62; 87 0.508,7.62; 88 0,7.62; 89 -0.508,7.62; 90 -0.991,7.62; 91 -1.499,7.62; 92 -2.007,7.62; 93 -2.489,7.62; 94 -2.997,7.62; 95 -3.505,7.62; 96 -3.988,7.62; 97 -4.496,7.62; 98 -5.004,7.62; 99 -5.512,7.62; 100 -5.994,7.62
E2,5-6 = drill 0.813 pad 1.6: + -1.27,0 | drill 0.813 pad 1.6 octagon: - 1.27,0
C0805 = smd 1.3 x 1.5: 1 -0.95,0; 2 0.95,0
DC-DC-STEP-DOWN-LM2596 = drill 1.5 pad 2.5 square: IN+ -19.812,8.636; IN- -19.812,-8.636; OUT+ 19.812,8.636; OUT- 19.812,-8.636 | hole 3: -14.478,7.62; 15.24,-7.62
C050-025X075 = drill 0.813 octagon: 1 -2.54,0; 2 2.54,0
PVA1R = drill 0.813 octagon: 1 -2.997,2.489; 2 -2.997,-2.489; 3 2.997,2.489; 4 2.997,-2.489
6410-04 = drill 1.016 long: 1 3.81,0; 2 1.27,0; 3 -1.27,0; 4 -3.81,0
22-23-2061 = drill 1 long: 1 -6.35,0; 2 -3.81,0; 3 -1.27,0; 4 1.27,0; 5 3.81,0; 6 6.35,0

### Placement (x,y rotation side)
BATTERY1:X1  22-23-2021  [22-23-2021]  5.11,50.98 90 top
BUTTONS1:J1  22-27-2021-02  [6410-02]  5.11,56.57 270 top
BUTTONS1:J2  22-27-2031-03  [6410-03]  90.26,26.72 270 top
ENCODERS1:X1  22-23-2041  [22-23-2041]  91.14,57.2 180 top
ENCODERS2:X1  22-23-2041  [22-23-2041]  37.24,31.43 180 top
GYRO_SENSOR1:X1  22-23-2041  [22-23-2041]  31.78,56.32 180 top
LEDS:LED1  [SML0805]  85.37,37.01 180 top
LEDS:LED2  [SML0805]  85.37,31.93 180 top
LEDS:LED3  [SML0805]  85.37,34.47 180 top
LEDS:LED4  [SML0805]  85.37,29.39 180 top
LEDS:R1  [M1206]  77.5,38.28 180 top
LEDS:R2  [M1206]  77.5,32.19 180 top
LEDS:R3  [M1206]  77.5,35.24 180 top
LEDS:R4  [M1206]  77.5,29.14 180 top
MAIN_BOARD1:DEBOUNCER1:C1  [C025-030X050]  96.3,23.2 0 bottom
MAIN_BOARD1:DEBOUNCER1:R1  [M1206]  96.3,26.38 180 top
MAIN_BOARD1:DEBOUNCER2:C1  [C025-030X050]  88.8,33.2 270 top
MAIN_BOARD1:DEBOUNCER2:R1  [M1206]  95.29,30.44 270 top
MAIN_BOARD1:EXTRA1:X1  22-23-2051  [22-23-2051]  49.94,30.66 0 top
MAIN_BOARD1:H-BRIDGE1:C1  100p  [C050-024X044]  95.26,6.01 180 top
MAIN_BOARD1:H-BRIDGE1:C2  10u  [E5-10,5]  38.13,6.53 90 top
MAIN_BOARD1:H-BRIDGE1:CURRENT_MONITOR1:C1  100nf  [C050-024X044]  40.67,20.5 270 top
MAIN_BOARD1:H-BRIDGE1:CURRENT_MONITOR1:IC1  MAX406CPA  [DIL08]  47.02,20.5 0 top
MAIN_BOARD1:H-BRIDGE1:CURRENT_MONITOR1:R1  [0617V]  86.13,7.8 180 top
MAIN_BOARD1:H-BRIDGE1:CURRENT_MONITOR1:R2  [0207/10]  48.29,12.88 0 top
MAIN_BOARD1:H-BRIDGE1:CURRENT_MONITOR1:R3  [0207/10]  54,20.5 270 top
MAIN_BOARD1:H-BRIDGE1:CURRENT_MONITOR2:C1  100nf  [C050-024X044]  45.75,6.53 90 top
MAIN_BOARD1:H-BRIDGE1:CURRENT_MONITOR2:IC1  MAX406CPA  [DIL08]  34.32,20.5 0 top
MAIN_BOARD1:H-BRIDGE1:CURRENT_MONITOR2:R1  [0617V]  86.13,3.99 180 top
MAIN_BOARD1:H-BRIDGE1:CURRENT_MONITOR2:R2  [0207/10]  29.24,11.61 0 top
MAIN_BOARD1:H-BRIDGE1:CURRENT_MONITOR2:R3  [0207/10]  27.97,19.23 270 top
MAIN_BOARD1:H-BRIDGE1:U$1  DRV8833_MODULE  [DRV8833_MODULE]  66.07,3.99 0 top
MAIN_BOARD1:MICROCONTROLLER1:C1  20p  [C025-030X050]  42.32,44.38 0 top
MAIN_BOARD1:MICROCONTROLLER1:C2  20p  [C025-030X050]  42.32,39.3 180 top
MAIN_BOARD1:MICROCONTROLLER1:Q1  8M  [HC49/S]  47.52,41.84 90 top
MAIN_BOARD1:MICROCONTROLLER1:R1  [M0805]  28.09,31.93 90 top
MAIN_BOARD1:MICROCONTROLLER1:R2  [M0805]  30.63,31.93 90 top
MAIN_BOARD1:MICROCONTROLLER1:U$1  PIC32MX795F512L-80I/PF  [QFP50P1600X1600X120-100N]  63.53,42.09 180 top
MAIN_BOARD1:POWER_DIST1:C2  10u  [E2,5-6]  24.79,24.06 270 top
MAIN_BOARD1:POWER_DIST1:C3  10u  [E2,5-6]  14.38,50.86 180 top
MAIN_BOARD1:POWER_DIST1:C4  100p  [C0805]  67.34,53.52 180 top
MAIN_BOARD1:POWER_DIST1:C5  100p  [C050-024X044]  10.06,55.3 270 top
MAIN_BOARD1:POWER_DIST1:U$1  DC-DC-STEP-DOWN-LM2596  [DC-DC-STEP-DOWN-LM2596]  11.46,25.58 270 top
MAIN_BOARD1:RESET_CIRCUIT1:C1  100n  [C050-025X075]  72.42,59.87 180 top
MAIN_BOARD1:RESET_CIRCUIT1:R1  10k  [0207/10]  71.15,56.7 180 top
MAIN_BOARD1:RESET_CIRCUIT1:S2  PVA1R  [PVA1R]  90.2,45.9 180 top
MOTOR1:X1  22-23-2021  [22-23-2021]  95.28,11.61 270 top
MOTOR2:X1  22-23-2021  [22-23-2021]  95.28,16.69 90 top
OBST_SENSOR1:J1  22-27-2041-04  [6410-04]  31.78,50.1 0 top
OBST_SENSOR2:J1  22-27-2041-04  [6410-04]  31.78,44.13 0 top
OBST_SENSOR3:J1  22-27-2041-04  [6410-04]  29.36,38.03 0 top
PROGRAMMER1:X1  [22-23-2061]  81.18,53.52 270 top
SERIAL_COMM1:X1  [22-23-2061]  46.64,52.13 180 top

### Tracks (layer width: path | path; a pad name or v marks a point on that pad's centre or on a via)
+3V3
  Top 0.305: 67.72,51.87 67.51,51.67 MAIN_BOARD1:MICROCONTROLLER1:U$1.30 67.51,47.23 67.46,47.17 | MAIN_BOARD1:MICROCONTROLLER1:U$1.46 59.54,47.35 59.72,47.17 64.03,47.17 | 64.03,47.17 MAIN_BOARD1:MICROCONTROLLER1:U$1.37 | 67.46,47.17 64.03,47.17 | 68.8,47.17 67.46,47.17 | 69.56,45.9 69.56,43.62 | 69.56,43.62 69.56,37.71 | 69.37,37.52 69.18,37.33 | 69.18,37.33 68.73,36.89 | 69.18,37.33 69.93,36.58 MAIN_BOARD1:MICROCONTROLLER1:U$1.2 73.25,36.58 | MAIN_BOARD1:MICROCONTROLLER1:U$1.16 69.58,43.59 69.56,43.62 | MAIN_BOARD1:MICROCONTROLLER1:U$1.54 58.45,46.59 | 60.22,45.14 57.68,42.6 MAIN_BOARD1:MICROCONTROLLER1:U$1.62 52.86,42.6 52.1,43.36 | 81.31,57.33 PROGRAMMER1:X1.2 | MAIN_BOARD1:MICROCONTROLLER1:U$1.85 62.03,35.52 62.54,36.02 | MAIN_BOARD1:MICROCONTROLLER1:U$1.86 62.54,36.02 | 62.54,36.02 62.57,36.06
  Top 0.508: 38.13,43.36 38.13,45.9 38.61,46.39 49.94,46.39 52.1,44.23 52.1,43.36 | ENCODERS1:X1.4 81.31,57.2 PROGRAMMER1:X1.2
  Top 0.61: 68.61,53.52 MAIN_BOARD1:POWER_DIST1:C4.1 68.61,53.84 | 69.37,37.52 69.56,37.71 69.56,45.9 69.56,46.41 68.8,47.17 68.62,47.35 | 58.78,46.59 58.95,46.41 60.22,45.14 63.4,41.97 | ENCODERS2:X1.4 33.43,33.59 35.59,35.74 35.59,40.82 38.13,43.36
  Top 0.813: 74.32,37.65 74.64,37.97 | 33.43,29.9 ENCODERS2:X1.4 | MAIN_BOARD1:MICROCONTROLLER1:R1.1 MAIN_BOARD1:MICROCONTROLLER1:R2.1 32.99,30.98 | MAIN_BOARD1:EXTRA1:X1.1 44.86,27.74 | MAIN_BOARD1:POWER_DIST1:C4.1 68.29,52.44 67.72,51.87 | 58.45,46.59 58.78,46.59 59.54,47.35 68.62,47.35 69.56,46.41 69.56,37.71 | 69.37,37.52 68.73,36.89 63.4,36.89 | 63.4,36.89 63.4,41.97 58.95,46.41 | 62.57,36.06 63.4,36.89
  Top 1.016: 24.41,25.33 MAIN_BOARD1:POWER_DIST1:C2.+ 23.9,25.33 20.09,21.52 | 68.61,53.52 69.88,54.79 72.65,54.79 | 72.65,54.79 77.5,54.79 80.04,57.33 PROGRAMMER1:X1.2 | 20.09,21.52 20.09,17.96 | 20.09,17.96 MAIN_BOARD1:POWER_DIST1:U$1.OUT+ | GYRO_SENSOR1:X1.4 OBST_SENSOR1:J1.4 OBST_SENSOR2:J1.4 27.97,41.84 25.55,39.43 OBST_SENSOR3:J1.4 25.55,31.93 26.5,30.98 MAIN_BOARD1:MICROCONTROLLER1:R1.1 32.99,30.98 ENCODERS2:X1.4 33.3,31.3 33.3,28.63 36.3,28.63 37.19,27.74 44.86,27.74 54.13,27.74 55.65,26.22 55.65,22.79 53.37,20.5 33.05,20.5 31.78,19.23 27.97,19.23 26.7,17.96 20.09,17.96 | 20.09,21.52 20.09,36.13 19.18,37.04 17.82,37.04 16.05,38.81 16.05,41.32 17.82,43.09 22.61,43.09 22.89,43.36 22.89,58.6 26.11,61.83 66.07,61.83 | MAIN_BOARD1:RESET_CIRCUIT1:R1.2 66.07,61.83 | ENCODERS1:X1.4 81.44,57.2 81.31,57.33 | BUTTONS1:J2.3 91.47,30.47 91.47,32.1 98.1,38.73 98.1,40.79 | 66.07,61.83 72.55,61.83 | 72.55,61.83 90.34,61.83 94.93,61.83 95.71,61.83 98.1,59.44 98.1,40.79 | 72.65,54.79 72.65,61.73 72.55,61.83 | 98.1,40.79 98.06,40.82 74.96,40.82 74.32,40.19 74.32,37.65 73.25,36.58 | 74.64,37.97 75.78,37.97 LEDS:R1.2
GND
  Top 0.305: 57.56,40.44 56.9,41.1 MAIN_BOARD1:MICROCONTROLLER1:U$1.65 49.84,41.1 49.56,40.82 49.56,39.55 | LEDS:LED3.C LEDS:LED1.C | MAIN_BOARD1:MICROCONTROLLER1:U$1.45 60.02,50.68 58.95,51.75 | 42.25,45.59 42.37,45.7 | MAIN_BOARD1:MICROCONTROLLER1:U$1.15 73.69,43.09 | 57.47,36.84 56.73,36.1 MAIN_BOARD1:MICROCONTROLLER1:U$1.75 55.12,36.1 54.76,35.74 54.76,34.47 | 64.96,52.09 64.52,51.66 MAIN_BOARD1:MICROCONTROLLER1:U$1.36 | MAIN_BOARD1:MICROCONTROLLER1:U$1.31 67.03,51.29 66.32,52
  Top 0.508: 82.07,54.92 81.94,54.79 PROGRAMMER1:X1.3 | 42.25,45.59 MAIN_BOARD1:MICROCONTROLLER1:C1.1 40.67,44 40.67,39.55 | MAIN_BOARD1:MICROCONTROLLER1:C2.2 42.7,37.65 48.92,37.65 49.56,38.28 49.56,39.55 | 54.76,34.47 54.76,30.92 MAIN_BOARD1:EXTRA1:X1.5 | MAIN_BOARD1:RESET_CIRCUIT1:C1.2 69.88,57.09 67.23,54.44 67.23,54.37 MAIN_BOARD1:POWER_DIST1:C4.2 66.32,53.46 | 58.95,51.75 58.45,52.25 53.11,52.25 SERIAL_COMM1:X1.1 | 42.37,45.7 49.25,45.7 50.19,44.76 50.19,42.86
  Top 0.61: 86.64,34.47 LEDS:LED3.C | 73.69,43.09 83.57,43.09 85.12,44.63 85.12,47.17 86.34,48.39 MAIN_BOARD1:RESET_CIRCUIT1:S2.4 | MAIN_BOARD1:DEBOUNCER1:C1.1 97.57,26.25 MAIN_BOARD1:DEBOUNCER1:R1.1 97.7,30.94 96.68,31.96 95.41,31.96 MAIN_BOARD1:DEBOUNCER2:R1.1
  Top 0.813: 64.96,52.09 66.32,53.46 66.32,52 | 57.56,40.44 58.07,39.94 58.07,37.43 57.47,36.84
  Top 1.016: LEDS:LED3.C LEDS:LED2.C LEDS:LED4.C LEDS:LED1.C 86.42,36.85 MAIN_BOARD1:DEBOUNCER2:C1.1
  Bottom 0.508: MAIN_BOARD1:MICROCONTROLLER1:C2.2 40.67,39.68 40.67,44.63 | MAIN_BOARD1:RESET_CIRCUIT1:S2.2 93.19,51.94 94.95,53.7 ENCODERS1:X1.1
  Bottom 0.61: 50.83,17.96 MAIN_BOARD1:H-BRIDGE1:CURRENT_MONITOR1:IC1.4 | MAIN_BOARD1:H-BRIDGE1:CURRENT_MONITOR1:C1.2 41.94,19.23 | 87.2,51.44 87.2,50.98 | MAIN_BOARD1:RESET_CIRCUIT1:S2.4 90.2,48.39 MAIN_BOARD1:RESET_CIRCUIT1:S2.2 | 97.57,29.8 97.57,29.5
  Bottom 0.813: 41.94,19.23 49.56,19.23 50.83,17.96 | MAIN_BOARD1:H-BRIDGE1:CURRENT_MONITOR1:IC1.4 50.83,14.15 49.56,12.88 MAIN_BOARD1:H-BRIDGE1:CURRENT_MONITOR1:R2.1 | 41.94,12.88 MAIN_BOARD1:H-BRIDGE1:CURRENT_MONITOR2:IC1.4 39.4,16.69 MAIN_BOARD1:H-BRIDGE1:CURRENT_MONITOR1:C1.2 43.21,20.5 MAIN_BOARD1:H-BRIDGE1:CURRENT_MONITOR1:IC1.8 43.21,28.12 | 11.46,28.12 24.16,28.12 | MAIN_BOARD1:DEBOUNCER2:C1.1 86.39,34.47 77.5,25.58 MAIN_BOARD1:H-BRIDGE1:U$1.GND2 | MAIN_BOARD1:MICROCONTROLLER1:C2.2 38.13,39.3 35.59,41.84 35.59,42.09 | 41.05,36.63 ENCODERS2:X1.1 43.21,29.27 43.21,28.12 | 33.05,28.12 43.21,28.12 | 43.21,28.12 54.64,28.12 54.64,30.28 MAIN_BOARD1:EXTRA1:X1.5
  Bottom 1.016: MAIN_BOARD1:H-BRIDGE1:CURRENT_MONITOR2:IC1.8 30.51,28.12 | MAIN_BOARD1:POWER_DIST1:C2.- 24.54,23.04 24.16,23.04 22.89,24.31 22.89,26.85 24.16,28.12 30.51,28.12 | 69.88,53.02 53.87,53.02 SERIAL_COMM1:X1.1 52.99,50.6 50.83,48.44 45.11,48.44 MAIN_BOARD1:MICROCONTROLLER1:C1.1 | 69.88,53.02 76.99,53.02 78.77,54.79 PROGRAMMER1:X1.3 83.85,54.79 87.2,51.44 | MAIN_BOARD1:H-BRIDGE1:C2.- MAIN_BOARD1:H-BRIDGE1:CURRENT_MONITOR2:C1.2 54.64,9.07 60.99,15.42 60.99,21.77 62.26,23.04 MAIN_BOARD1:H-BRIDGE1:U$1.GND MAIN_BOARD1:H-BRIDGE1:U$1.GND2 | MAIN_BOARD1:H-BRIDGE1:C2.- 26.7,9.07 MAIN_BOARD1:H-BRIDGE1:CURRENT_MONITOR2:R2.1 | MAIN_BOARD1:H-BRIDGE1:C2.- 41.94,12.88 MAIN_BOARD1:H-BRIDGE1:CURRENT_MONITOR1:R2.1 | MAIN_BOARD1:RESET_CIRCUIT1:C1.2 69.88,53.02 | OBST_SENSOR1:J1.1 OBST_SENSOR2:J1.1 35.59,42.09 33.17,39.68 OBST_SENSOR3:J1.1 | OBST_SENSOR1:J1.1 35.59,52.25 34.32,53.52 31.78,53.52 30.51,54.79 GYRO_SENSOR1:X1.3 | 30.51,28.12 33.05,28.12 | MAIN_BOARD1:RESET_CIRCUIT1:S2.2 MAIN_BOARD1:RESET_CIRCUIT1:S2.4 87.2,50.98 | 90.2,48.39 90.2,38.28 94.01,34.47 | MAIN_BOARD1:DEBOUNCER2:C1.1 94.01,34.47 | OBST_SENSOR1:J1.1 35.71,49.71 MAIN_BOARD1:MICROCONTROLLER1:C1.1 | 45.75,35.74 41.94,35.74 41.05,36.63 MAIN_BOARD1:MICROCONTROLLER1:C2.2 MAIN_BOARD1:MICROCONTROLLER1:C1.1 | 97.57,29.8 97.57,30.91 94.01,34.47 | 97.57,29.5 MAIN_BOARD1:DEBOUNCER1:C1.1 97.57,22.71 97.61,22.67
  Bottom 1.27: MAIN_BOARD1:H-BRIDGE1:U$1.GND2 80.04,23.04 88.67,14.41 MAIN_BOARD1:H-BRIDGE1:CURRENT_MONITOR1:R1.1 | MAIN_BOARD1:H-BRIDGE1:CURRENT_MONITOR2:R2.1 11.46,11.61 | MAIN_BOARD1:POWER_DIST1:U$1.OUT- 5.61,5.77 11.46,11.61 | 11.46,11.61 11.46,28.12 11.46,38.28 4.34,45.4 | 4.34,45.4 MAIN_BOARD1:POWER_DIST1:U$1.IN- | 4.34,45.4 5.11,46.16 BATTERY1:X1.1 10.19,49.71 | 10.19,49.71 10.19,52.25 10.06,52.38 MAIN_BOARD1:POWER_DIST1:C5.2 | 10.19,49.71 11.46,50.98 12.98,50.98 MAIN_BOARD1:POWER_DIST1:C3.- | 91.34,7.8 MAIN_BOARD1:H-BRIDGE1:CURRENT_MONITOR1:R1.1 | 92.61,3.99 MAIN_BOARD1:H-BRIDGE1:CURRENT_MONITOR2:R1.1 MAIN_BOARD1:H-BRIDGE1:CURRENT_MONITOR1:R1.1
  pour Bottom: 1.1,62.77 98.83,62.77 98.83,1.16 1.29,1.16
LEDS:N$1
  Top 0.61: 79.15,29.39 LEDS:R4.1
  Top 0.813: LEDS:LED4.A 79.15,29.39
LEDS:N$2
  Top 0.813: LEDS:LED3.A 82.07,34.47 81.31,35.24 LEDS:R3.1
LEDS:N$3
  Top 0.61: 79.15,31.93 LEDS:R2.1
  Top 0.813: LEDS:LED2.A 79.15,31.93
LEDS:N$4
  Top 0.813: LEDS:R1.1 81.31,38.28 82.58,37.01 LEDS:LED1.A
MAIN_BOARD1:H-BRIDGE1:CURRENT_MONITOR1:N$1
  Top 0.61: MAIN_BOARD1:H-BRIDGE1:CURRENT_MONITOR1:IC1.2 45.75,17.96 47.02,19.23 52.1,19.23 54,17.33 MAIN_BOARD1:H-BRIDGE1:CURRENT_MONITOR1:R3.2
  Top 0.813: MAIN_BOARD1:H-BRIDGE1:CURRENT_MONITOR1:R2.2 54,13.52 MAIN_BOARD1:H-BRIDGE1:CURRENT_MONITOR1:R3.2
MAIN_BOARD1:H-BRIDGE1:CURRENT_MONITOR2:N$1
  Top 0.61: MAIN_BOARD1:H-BRIDGE1:CURRENT_MONITOR2:IC1.2 33.05,14.15 | 33.05,14.15 34.32,12.88 MAIN_BOARD1:H-BRIDGE1:CURRENT_MONITOR2:R2.2 | 33.05,14.15 MAIN_BOARD1:H-BRIDGE1:CURRENT_MONITOR2:R3.2
MAIN_BOARD1:H-BRIDGE1:N$8
  Top 0.61: MAIN_BOARD1:H-BRIDGE1:U$1.BISEN 72.42,5.26 70.26,3.11 58.45,3.11 55.14,3.11 54.95,3.3 47.27,10.98 39.52,10.98 35.59,14.92 MAIN_BOARD1:H-BRIDGE1:CURRENT_MONITOR2:IC1.3
  Top 1.27: MAIN_BOARD1:H-BRIDGE1:CURRENT_MONITOR2:R1.2 82.32,5.26 MAIN_BOARD1:H-BRIDGE1:U$1.BISEN
MAIN_BOARD1:H-BRIDGE1:N$9
  Top 0.508: 58.52,3.93 58.45,3.99
  Top 0.61: MAIN_BOARD1:H-BRIDGE1:U$1.AISEN 72.42,7.8 68.49,3.87 58.57,3.87 58.52,3.93 | MAIN_BOARD1:H-BRIDGE1:CURRENT_MONITOR1:IC1.3 48.29,14.15 58.45,3.99
  Top 1.27: MAIN_BOARD1:H-BRIDGE1:CURRENT_MONITOR1:R1.2 MAIN_BOARD1:H-BRIDGE1:U$1.AISEN
MAIN_BOARD1:MICROCONTROLLER1:N$4
  Top 0.305: 47.52,44.13 MAIN_BOARD1:MICROCONTROLLER1:Q1.2 | MAIN_BOARD1:MICROCONTROLLER1:U$1.63 48.54,42.09 47.52,43.11
  Top 0.508: 47.52,43.11 MAIN_BOARD1:MICROCONTROLLER1:Q1.2 MAIN_BOARD1:MICROCONTROLLER1:C1.2
MAIN_BOARD1:MICROCONTROLLER1:N$6
  Top 0.305: MAIN_BOARD1:MICROCONTROLLER1:U$1.64 48.54,41.59 47.52,40.57
  Top 0.508: 47.52,40.57 MAIN_BOARD1:MICROCONTROLLER1:Q1.1 MAIN_BOARD1:MICROCONTROLLER1:C2.1
MAIN_BOARD1:N$1
  Top 0.305: 56.8,20.98 56.8,29.27 57.53,30 MAIN_BOARD1:MICROCONTROLLER1:U$1.76
  Top 0.61: 56.8,29.27 56.8,15.81 62.26,10.34 MAIN_BOARD1:H-BRIDGE1:U$1.AIN1
MAIN_BOARD1:N$2
  Top 0.305: 58.01,28.12 MAIN_BOARD1:MICROCONTROLLER1:U$1.77
  Top 0.61: MAIN_BOARD1:H-BRIDGE1:U$1.AIN2 62.26,12.88 58.01,17.13 58.01,28.12
MAIN_BOARD1:N$3
  Top 0.305: 60.02,27.36 MAIN_BOARD1:MICROCONTROLLER1:U$1.81
  Top 0.508: 60.02,20.2 60.02,20.5
  Top 0.61: MAIN_BOARD1:H-BRIDGE1:U$1.BIN1 62.26,17.96 60.02,20.2 | 60.02,20.5 60.02,27.36
MAIN_BOARD1:N$4
  Top 0.305: 59.08,28.12 59.08,29.14 58.52,29.7 MAIN_BOARD1:MICROCONTROLLER1:U$1.78
  Top 0.61: 59.08,28.12 59.08,18.6 62.26,15.42 MAIN_BOARD1:H-BRIDGE1:U$1.BIN2
MAIN_BOARD1:N$5
  Top 0.305: MAIN_BOARD1:MICROCONTROLLER1:U$1.42 61.52,52.25
  Top 0.508: 61.52,52.25 61.52,52.99 58.45,56.06 41.94,56.06 37.24,60.76 27.71,60.76 24.54,57.59 24.54,42.09 21.85,39.4 21.85,38.28
  Top 0.61: MAIN_BOARD1:H-BRIDGE1:CURRENT_MONITOR2:IC1.6 35.59,25.58 34.32,26.85 27.96,26.85 | 21.85,38.28 21.85,27.89 22.89,26.85 27.96,26.85 | MAIN_BOARD1:H-BRIDGE1:CURRENT_MONITOR2:R3.1 27.97,26.85 27.96,26.85
MAIN_BOARD1:N$6
  Top 0.305: MAIN_BOARD1:MICROCONTROLLER1:U$1.43 61.04,50.93 60.61,51.37
  Top 0.508: 60.61,51.37 57.18,54.79 41.94,54.79 36.86,59.87 27.97,59.87 25.43,57.33 25.43,41.84 22.89,39.3 22.89,38.28
  Top 0.61: 48.29,25.58 MAIN_BOARD1:H-BRIDGE1:CURRENT_MONITOR1:IC1.6 | 53.37,26.22 MAIN_BOARD1:H-BRIDGE1:CURRENT_MONITOR1:R3.1 54,25.76 52.99,26.78 48.2,26.78 | 22.89,38.28 22.89,29.39 24.16,28.12 32.44,28.12 32.9,27.67 35.9,27.67 36.79,26.78 48.2,26.78 | MAIN_BOARD1:H-BRIDGE1:CURRENT_MONITOR1:IC1.6 48.29,25.51 | MAIN_BOARD1:H-BRIDGE1:CURRENT_MONITOR1:IC1.6 48.29,26.69 48.2,26.78
MAIN_BOARD1:N$7
  Top 0.305: MAIN_BOARD1:MICROCONTROLLER1:U$1.68 53.16,39.61 52.48,38.92 52.48,38.54
  Top 0.508: MAIN_BOARD1:EXTRA1:X1.2 47.4,33.46 48.54,34.6 50.95,34.6 52.48,36.13 52.48,38.54
MAIN_BOARD1:N$8
  Top 0.305: MAIN_BOARD1:MICROCONTROLLER1:U$1.69 54.18,39.1 53.37,38.28 53.37,37.65
  Top 0.508: MAIN_BOARD1:EXTRA1:X1.3 49.94,32.32 53.37,35.74 53.37,37.65
MAIN_BOARD1:N$9
  Top 0.305: MAIN_BOARD1:MICROCONTROLLER1:U$1.70 54.69,38.59 54.13,38.03 54.13,37.4
  Top 0.508: 54.13,37.4 54.13,35.28 52.48,33.63 MAIN_BOARD1:EXTRA1:X1.4
MAIN_BOARD1:N$12
  Top 0.305: MAIN_BOARD1:MICROCONTROLLER1:U$1.83 61.04,30.61 62.26,29.39
  Top 0.61: MAIN_BOARD1:H-BRIDGE1:U$1.NFAULT 71.15,9.07 71.15,24.31 69.88,25.58 66.07,25.58 62.26,29.39
MAIN_BOARD1:N$13
  Top 0.305: MAIN_BOARD1:MICROCONTROLLER1:U$1.82 60.53,28.58 60.99,28.12
  Top 0.61: MAIN_BOARD1:H-BRIDGE1:U$1.NSLEEP 68.61,7.8 69.88,9.07 69.88,23.68 68.99,24.57 64.54,24.57 60.99,28.12
N$1
  Top 0.305: MAIN_BOARD1:MICROCONTROLLER1:U$1.58 54.43,44.58 53.24,45.78
  Top 0.508: GYRO_SENSOR1:X1.2 33.05,57.33 34.7,58.99 36.48,58.99 38.13,57.33 38.13,48.44 38.79,47.78 51.23,47.78 53.24,45.78
  Top 1.016: GYRO_SENSOR1:X1.2 33.05,54.41 30.51,51.87 OBST_SENSOR1:J1.3 OBST_SENSOR2:J1.3 30.51,42.09 28.09,39.68 OBST_SENSOR3:J1.3 MAIN_BOARD1:MICROCONTROLLER1:R1.2
N$2
  Top 0.305: 52.86,44.51 53.05,44.32 53.26,44.1 MAIN_BOARD1:MICROCONTROLLER1:U$1.59
  Top 0.508: 53.05,44.32 50.32,47.05 38.59,47.05 37.47,48.17 37.47,51.64 35.59,53.52
  Top 1.016: OBST_SENSOR1:J1.2 33.05,50.98 | OBST_SENSOR1:J1.2 OBST_SENSOR2:J1.2 33.05,42.09 30.63,39.68 OBST_SENSOR3:J1.2 MAIN_BOARD1:MICROCONTROLLER1:R2.2 | OBST_SENSOR1:J1.2 33.05,51.75 35.59,54.29 | 35.59,54.29 GYRO_SENSOR1:X1.1 | 35.59,53.52 35.59,54.29
N$3
  Top 0.305: MAIN_BOARD1:MICROCONTROLLER1:U$1.52 55.87,47.64 54.31,47.64 52.74,49.21
  Top 0.508: SERIAL_COMM1:X1.4 45.37,50.1 46.25,49.21 52.74,49.21
N$4
  Top 0.305: MAIN_BOARD1:MICROCONTROLLER1:U$1.53 53.7,47.1 52.35,48.44 51.59,48.44
  Top 0.508: 51.59,48.44 44.48,48.44 42.83,50.1 SERIAL_COMM1:X1.5
N$5
  Top 1.27: BATTERY1:X1.2 BUTTONS1:J1.1
N$6
  Top 1.27: MAIN_BOARD1:H-BRIDGE1:U$1.AOUT1 MOTOR1:X1.2
N$7
  Top 1.27: MAIN_BOARD1:H-BRIDGE1:U$1.AOUT2 MOTOR1:X1.1
N$8
  Top 1.27: MAIN_BOARD1:H-BRIDGE1:U$1.BOUT1 MOTOR2:X1.2
N$9
  Top 1.27: MAIN_BOARD1:H-BRIDGE1:U$1.BOUT2 MOTOR2:X1.1
N$10
  Top 0.305: MAIN_BOARD1:MICROCONTROLLER1:U$1.19 73.89,45.09 74.09,45.29
  Top 0.508: 74.07,45.27 74.09,45.29 82.94,45.29 83.69,46.05 83.69,49.23 87.4,52.93 88.68,52.93 89.9,54.16 89.87,54.19 ENCODERS1:X1.3
N$11
  Top 0.305: MAIN_BOARD1:MICROCONTROLLER1:U$1.18 71.2,44.63 74.83,44.63
  Top 0.508: 74.83,44.63 83.21,44.63 84.35,45.78 84.35,48.95 87.67,52.27 88.95,52.27 88.99,52.31 91.23,52.31 92.41,53.49 ENCODERS1:X1.2
N$12
  Top 0.305: MAIN_BOARD1:MICROCONTROLLER1:U$1.87 63.02,29.9 63.53,29.39
  Top 0.61: 63.53,29.39 66.07,26.85 72.42,26.85 73.69,25.58 85.12,25.58 86.52,24.18 BUTTONS1:J2.1 90.29,24.22 94.02,24.22 | 94.02,24.22 MAIN_BOARD1:DEBOUNCER1:C1.2 | 94.02,24.22 94.9,25.1 MAIN_BOARD1:DEBOUNCER1:R1.2
N$13
  Top 0.305: 64.16,30.03 63.53,30.66 MAIN_BOARD1:MICROCONTROLLER1:U$1.88
  Top 0.61: 64.16,30.03 66.07,28.12 73.69,28.12 74.96,26.85 87.73,26.85 | 88.93,31.81 MAIN_BOARD1:DEBOUNCER2:C1.2 87.73,30.86 87.73,26.85 | 87.73,26.85 90.12,26.85 BUTTONS1:J2.2 91.57,26.72 93.89,29.04 MAIN_BOARD1:DEBOUNCER2:R1.2
N$14
  Top 0.305: MAIN_BOARD1:MICROCONTROLLER1:U$1.24 74.12,47.61 74.58,48.06
  Top 0.508: 74.58,48.06 76.23,49.71 PROGRAMMER1:X1.5
N$15
  Top 0.305: MAIN_BOARD1:MICROCONTROLLER1:U$1.25 73.33,48.09 73.69,48.44 73.69,49.71
  Top 0.508: PROGRAMMER1:X1.4 74.96,52.25 73.69,50.98 73.69,49.71
N$17
  Top 0.305: MAIN_BOARD1:MICROCONTROLLER1:U$1.66 51.87,40.6 51.46,40.19 | 38.13,36.51 38,36.51
  Top 0.508: 38.13,36.51 50.32,36.51 50.83,37.01 50.83,39.55 51.46,40.19 | 38,36.51 35.97,34.47 ENCODERS2:X1.3
N$18
  Top 0.305: 67.03,30.32 MAIN_BOARD1:MICROCONTROLLER1:U$1.95
  Top 0.61: 67.03,30.32 68.21,29.14 LEDS:R4.2
N$19
  Top 0.305: MAIN_BOARD1:MICROCONTROLLER1:U$1.97 68.02,32.52 68.61,31.93 69.11,31.93
  Top 0.61: 69.11,31.93 69.88,31.93 73.18,35.24 LEDS:R3.2
N$20
  Top 0.305: MAIN_BOARD1:MICROCONTROLLER1:U$1.96 67.51,31.76 68.61,30.66
  Top 0.61: 68.61,30.66 71.15,30.66 72.67,32.19 LEDS:R2.2
N$22
  Top 0.305: MAIN_BOARD1:MICROCONTROLLER1:U$1.67 52.63,40.09 52.1,39.55
  Top 0.508: 52.1,39.55 51.59,39.05 51.59,36.51 50.83,35.74 41.17,35.74 38.51,33.08 ENCODERS2:X1.2
N$23
  Top 0.305: 85.12,43.36 86.39,43.36 86.79,43.36 | 73.69,42.09 MAIN_BOARD1:MICROCONTROLLER1:U$1.13
  Top 0.508: PROGRAMMER1:X1.1 95.69,59.87 96.71,58.86 96.71,45.96 94.16,43.42 MAIN_BOARD1:RESET_CIRCUIT1:S2.1
  Top 0.61: 86.39,43.36 86.44,43.42 MAIN_BOARD1:RESET_CIRCUIT1:S2.3 MAIN_BOARD1:RESET_CIRCUIT1:S2.1 85.17,43.42 85.12,43.36 83.85,42.09 73.69,42.09
  Top 1.016: PROGRAMMER1:X1.1 MAIN_BOARD1:RESET_CIRCUIT1:C1.1 74.96,57.97 MAIN_BOARD1:RESET_CIRCUIT1:R1.1
VCC  (via drill 0.8 pad 1.3)
  Top 0.61: MAIN_BOARD1:H-BRIDGE1:CURRENT_MONITOR2:IC1.7 33.05,23.04 34.32,21.77 39.4,21.77 MAIN_BOARD1:H-BRIDGE1:CURRENT_MONITOR1:C1.1 41.94,21.77 44.48,21.77 45.75,23.04 MAIN_BOARD1:H-BRIDGE1:CURRENT_MONITOR1:IC1.7
  Top 0.813: 33.05,23.04 30.51,20.5 v22.89,20.5 | v22.89,15.42 22.12,14.66 22.12,9.96 22.89,9.2 22.89,1.99 23.04,1.84
  Top 1.016: 45.7,3.95 MAIN_BOARD1:H-BRIDGE1:CURRENT_MONITOR2:C1.1
  Top 1.27: BUTTONS1:J1.2 MAIN_BOARD1:POWER_DIST1:C5.1 14.76,57.84 15.65,56.95 MAIN_BOARD1:POWER_DIST1:C3.+ 15.65,50.6 20.35,45.9 20.35,45.65 MAIN_BOARD1:POWER_DIST1:U$1.IN+ 16.03,45.4 12.73,42.09 12.73,7.8 18.7,1.84 23.04,1.84 38.24,1.84 | MAIN_BOARD1:H-BRIDGE1:U$1.VIN 96.68,20.5 98.19,18.99 98.23,6.43 97.81,6.01 MAIN_BOARD1:H-BRIDGE1:C1.1 97.79,4.1 95.53,1.84 45.78,1.84 | 45.78,1.84 38.24,1.84 | 38.24,1.84 38.24,3.88 MAIN_BOARD1:H-BRIDGE1:C2.+ | MAIN_BOARD1:H-BRIDGE1:CURRENT_MONITOR2:C1.1 45.75,1.87 45.78,1.84
  Bottom 0.813: v22.89,20.5 v22.89,15.42
(copper drawn outside any net)
  shapes: Top area x4649

### Text on the board
Top: With <3 by AG & PM | may 2018